# EAGLE schematic 8B_RAM_3 (EAGLE 6.5.0), part 2 of 2
## Sheet 25 of 44
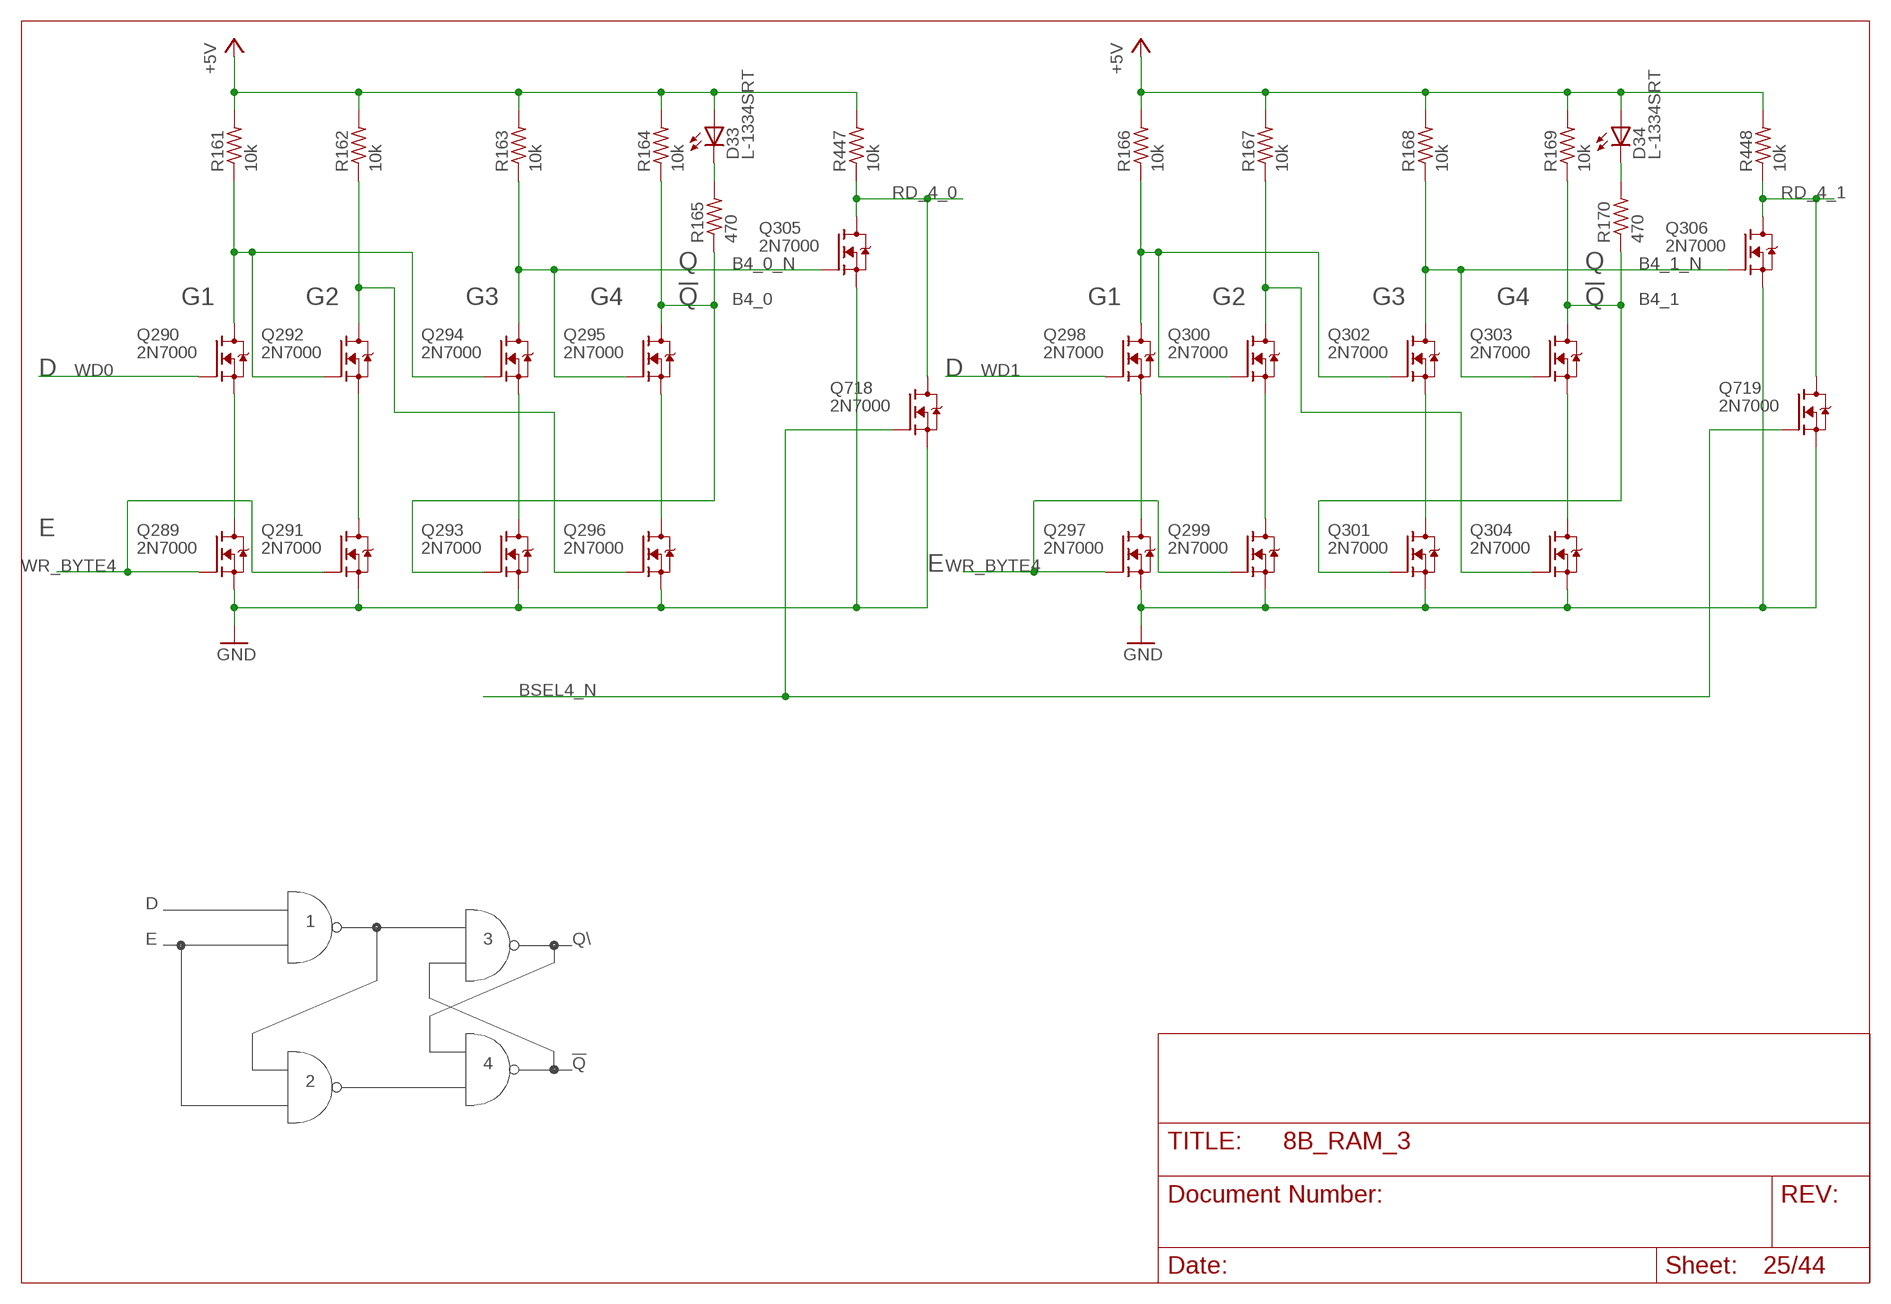
[diagram p24: schematic, sheet 25]

### Parts
D33  L-1334SRT  [LED3MM]
D34  L-1334SRT  [LED3MM]
Q289  2N7000  [TO92-DGS]
Q290  2N7000  [TO92-DGS]
Q291  2N7000  [TO92-DGS]
Q292  2N7000  [TO92-DGS]
Q293  2N7000  [TO92-DGS]
Q294  2N7000  [TO92-DGS]
Q295  2N7000  [TO92-DGS]
Q296  2N7000  [TO92-DGS]
Q297  2N7000  [TO92-DGS]
Q298  2N7000  [TO92-DGS]
Q299  2N7000  [TO92-DGS]
Q300  2N7000  [TO92-DGS]
Q301  2N7000  [TO92-DGS]
Q302  2N7000  [TO92-DGS]
Q303  2N7000  [TO92-DGS]
Q304  2N7000  [TO92-DGS]
Q305  2N7000  [TO92-DGS]
Q306  2N7000  [TO92-DGS]
Q718  2N7000  [TO92-DGS]
Q719  2N7000  [TO92-DGS]
R161  10k  R_P2INCH  [R_P2INCH]
R162  10k  R_P2INCH  [R_P2INCH]
R163  10k  R_P2INCH  [R_P2INCH]
R164  10k  R_P2INCH  [R_P2INCH]
R165  470  R_P2INCH  [R_P2INCH]
R166  10k  R_P2INCH  [R_P2INCH]
R167  10k  R_P2INCH  [R_P2INCH]
R168  10k  R_P2INCH  [R_P2INCH]
R169  10k  R_P2INCH  [R_P2INCH]
R170  470  R_P2INCH  [R_P2INCH]
R447  10k  R_P2INCH  [R_P2INCH]
R448  10k  R_P2INCH  [R_P2INCH]

### Nets
+5V: D33.A D34.A R161.2 R162.2 R163.2 R164.2 R166.2 R167.2 R168.2 R169.2 R447.2 R448.2 ; also sheet 2,4,5,6,7,8,9,10,11,12,13,14,15,16,17,18,19,20,21,22,23,24,26,27,28,29,30,31,32,33,34,35,36,37,38,39,40,41,42,43,44
B4_0: Q293.G Q295.D R164.1 R165.1
B4_0_N: Q294.D Q295.G Q305.G R163.1
B4_1: Q301.G Q303.D R169.1 R170.1
B4_1_N: Q302.D Q303.G Q306.G R168.1
BSEL4_N: Q718.G Q719.G ; also sheet 7,26,27,28
GND: Q289.S Q291.S Q293.S Q296.S Q297.S Q299.S Q301.S Q304.S Q305.S Q306.S Q718.S Q719.S ; also sheet 2,3,4,5,6,7,8,9,10,11,12,13,14,15,16,17,18,19,20,21,22,23,24,26,27,28,29,30,31,32,33,34,35,36,37,38,39,40,41,42,43,44
N$225: Q289.D Q290.S
N$226: Q291.D Q292.S
N$227: Q293.D Q294.S
N$228: Q290.D Q292.G Q294.G R161.1
N$229: Q292.D Q296.G R162.1
N$230: D33.K(C) R165.2
N$231: Q295.S Q296.D
N$232: Q297.D Q298.S
N$233: Q299.D Q300.S
N$234: Q301.D Q302.S
N$235: Q298.D Q300.G Q302.G R166.1
N$236: Q300.D Q304.G R167.1
N$237: D34.K(C) R170.2
N$238: Q303.S Q304.D
RD_4_0: Q305.D Q718.D R447.1 ; also sheet 41
RD_4_1: Q306.D Q719.D R448.1 ; also sheet 41
WD0: Q290.G ; also sheet 3,9,13,17,21,29,33,37
WD1: Q298.G ; also sheet 3,9,13,17,21,29,33,37
WR_BYTE4: Q289.G Q291.G Q297.G Q299.G ; also sheet 7,26,27,28

### Notes on the sheet
- Q | Q
- G1 | G2 | G3 | G4 | !Q | G1 | G2 | G3 | G4 | !Q
- D | D
- E
- E
- D
- 1
- E | 3 | Q\
- 4 | !Q
- 2

## Sheet 26 of 44
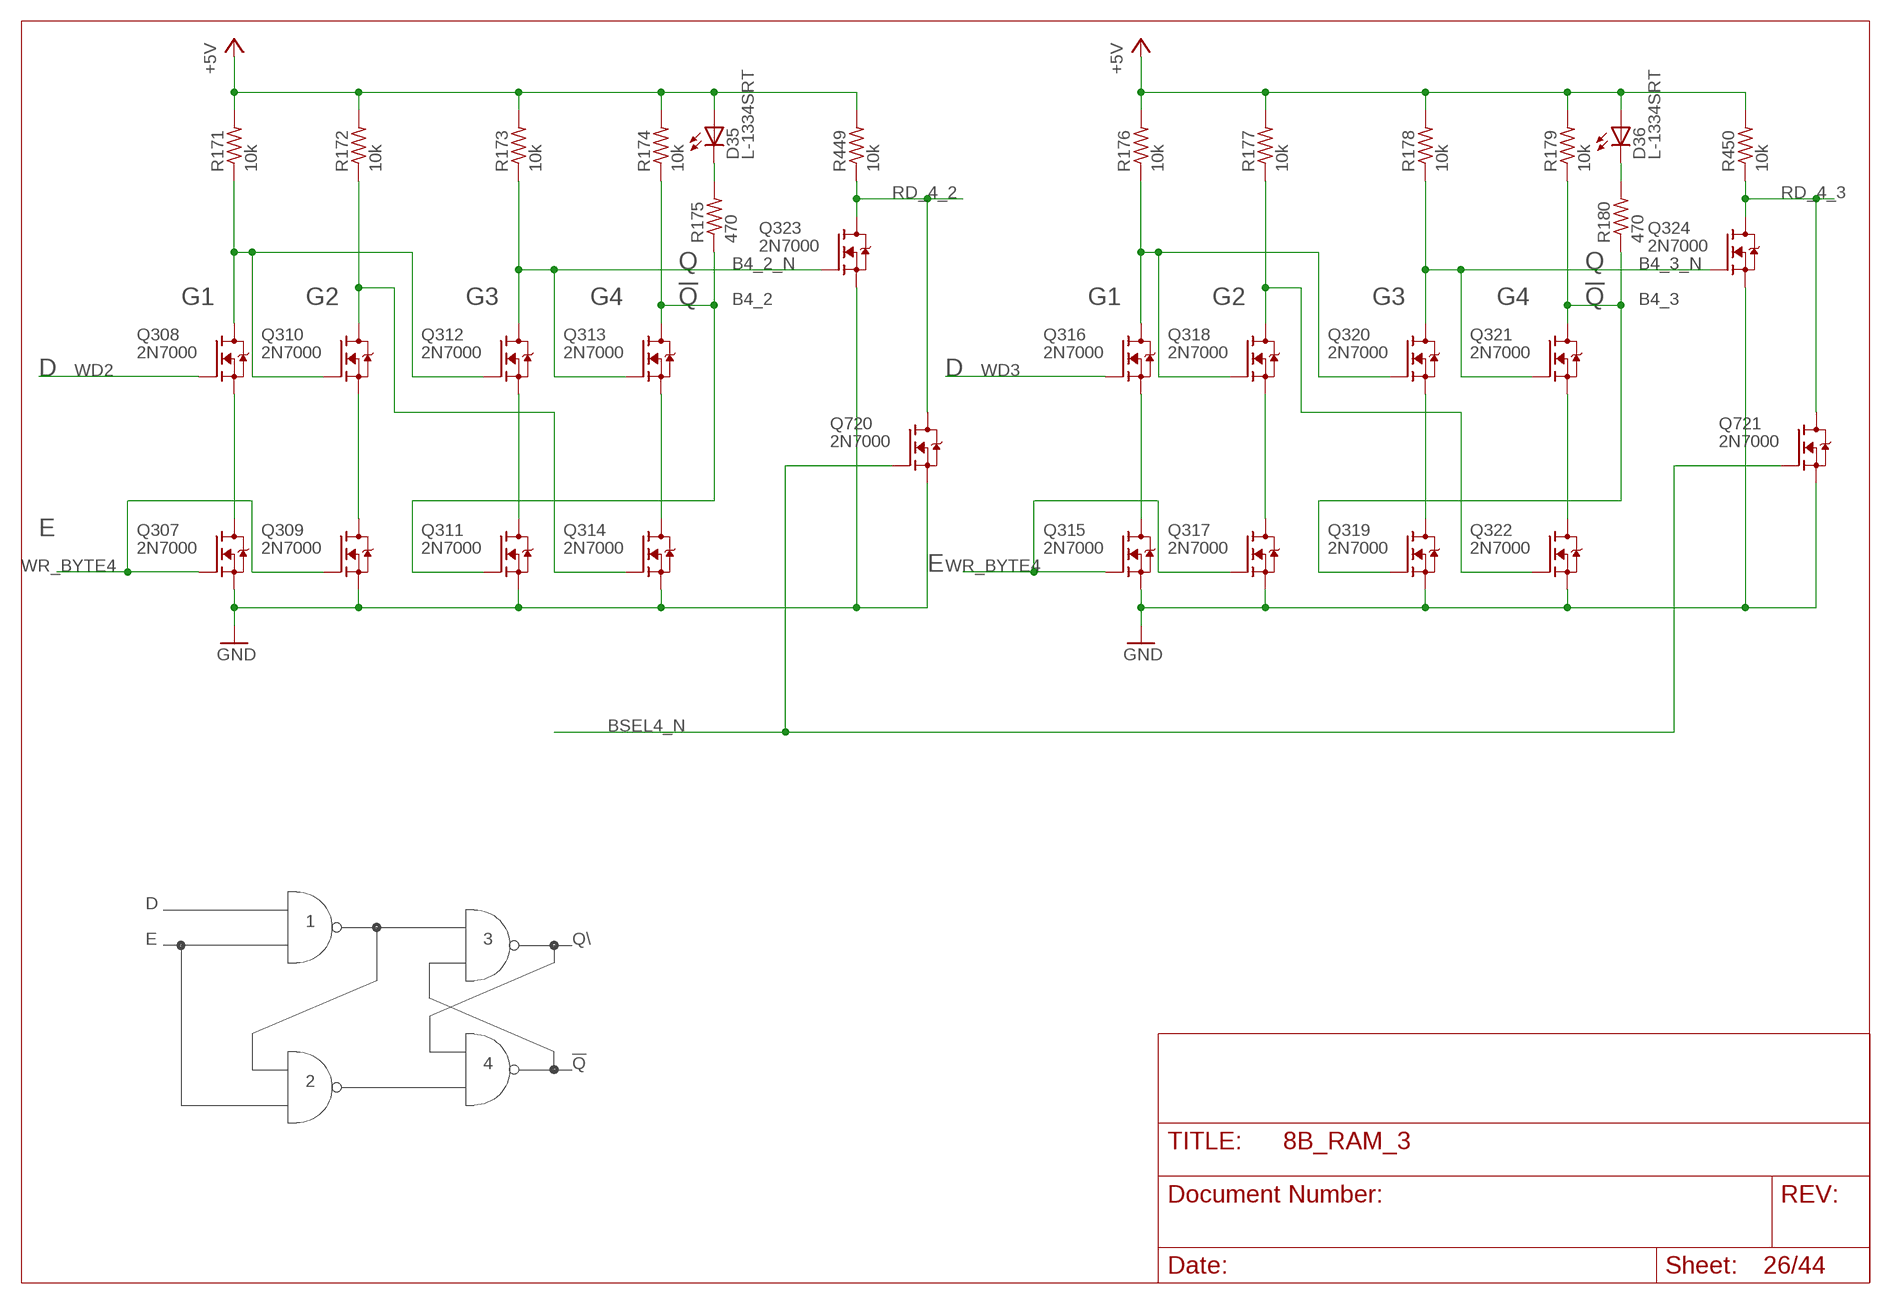
[diagram p25: schematic, sheet 26]

### Parts
D35  L-1334SRT  [LED3MM]
D36  L-1334SRT  [LED3MM]
Q307  2N7000  [TO92-DGS]
Q308  2N7000  [TO92-DGS]
Q309  2N7000  [TO92-DGS]
Q310  2N7000  [TO92-DGS]
Q311  2N7000  [TO92-DGS]
Q312  2N7000  [TO92-DGS]
Q313  2N7000  [TO92-DGS]
Q314  2N7000  [TO92-DGS]
Q315  2N7000  [TO92-DGS]
Q316  2N7000  [TO92-DGS]
Q317  2N7000  [TO92-DGS]
Q318  2N7000  [TO92-DGS]
Q319  2N7000  [TO92-DGS]
Q320  2N7000  [TO92-DGS]
Q321  2N7000  [TO92-DGS]
Q322  2N7000  [TO92-DGS]
Q323  2N7000  [TO92-DGS]
Q324  2N7000  [TO92-DGS]
Q720  2N7000  [TO92-DGS]
Q721  2N7000  [TO92-DGS]
R171  10k  R_P2INCH  [R_P2INCH]
R172  10k  R_P2INCH  [R_P2INCH]
R173  10k  R_P2INCH  [R_P2INCH]
R174  10k  R_P2INCH  [R_P2INCH]
R175  470  R_P2INCH  [R_P2INCH]
R176  10k  R_P2INCH  [R_P2INCH]
R177  10k  R_P2INCH  [R_P2INCH]
R178  10k  R_P2INCH  [R_P2INCH]
R179  10k  R_P2INCH  [R_P2INCH]
R180  470  R_P2INCH  [R_P2INCH]
R449  10k  R_P2INCH  [R_P2INCH]
R450  10k  R_P2INCH  [R_P2INCH]

### Nets
+5V: D35.A D36.A R171.2 R172.2 R173.2 R174.2 R176.2 R177.2 R178.2 R179.2 R449.2 R450.2 ; also sheet 2,4,5,6,7,8,9,10,11,12,13,14,15,16,17,18,19,20,21,22,23,24,25,27,28,29,30,31,32,33,34,35,36,37,38,39,40,41,42,43,44
B4_2: Q311.G Q313.D R174.1 R175.1
B4_2_N: Q312.D Q313.G Q323.G R173.1
B4_3: Q319.G Q321.D R179.1 R180.1
B4_3_N: Q320.D Q321.G Q324.G R178.1
BSEL4_N: Q720.G Q721.G ; also sheet 7,25,27,28
GND: Q307.S Q309.S Q311.S Q314.S Q315.S Q317.S Q319.S Q322.S Q323.S Q324.S Q720.S Q721.S ; also sheet 2,3,4,5,6,7,8,9,10,11,12,13,14,15,16,17,18,19,20,21,22,23,24,25,27,28,29,30,31,32,33,34,35,36,37,38,39,40,41,42,43,44
N$239: Q307.D Q308.S
N$240: Q309.D Q310.S
N$241: Q311.D Q312.S
N$242: Q308.D Q310.G Q312.G R171.1
N$243: Q310.D Q314.G R172.1
N$244: D35.K(C) R175.2
N$245: Q313.S Q314.D
N$246: Q315.D Q316.S
N$247: Q317.D Q318.S
N$248: Q319.D Q320.S
N$249: Q316.D Q318.G Q320.G R176.1
N$250: Q318.D Q322.G R177.1
N$251: D36.K(C) R180.2
N$252: Q321.S Q322.D
RD_4_2: Q323.D Q720.D R449.1 ; also sheet 42
RD_4_3: Q324.D Q721.D R450.1 ; also sheet 42
WD2: Q308.G ; also sheet 3,10,14,18,22,30,34,38
WD3: Q316.G ; also sheet 3,10,14,18,22,30,34,38
WR_BYTE4: Q307.G Q309.G Q315.G Q317.G ; also sheet 7,25,27,28

### Notes on the sheet
- Q | Q
- G1 | G2 | G3 | G4 | !Q | G1 | G2 | G3 | G4 | !Q
- D | D
- E
- E
- D
- 1
- E | 3 | Q\
- 4 | !Q
- 2

## Sheet 27 of 44
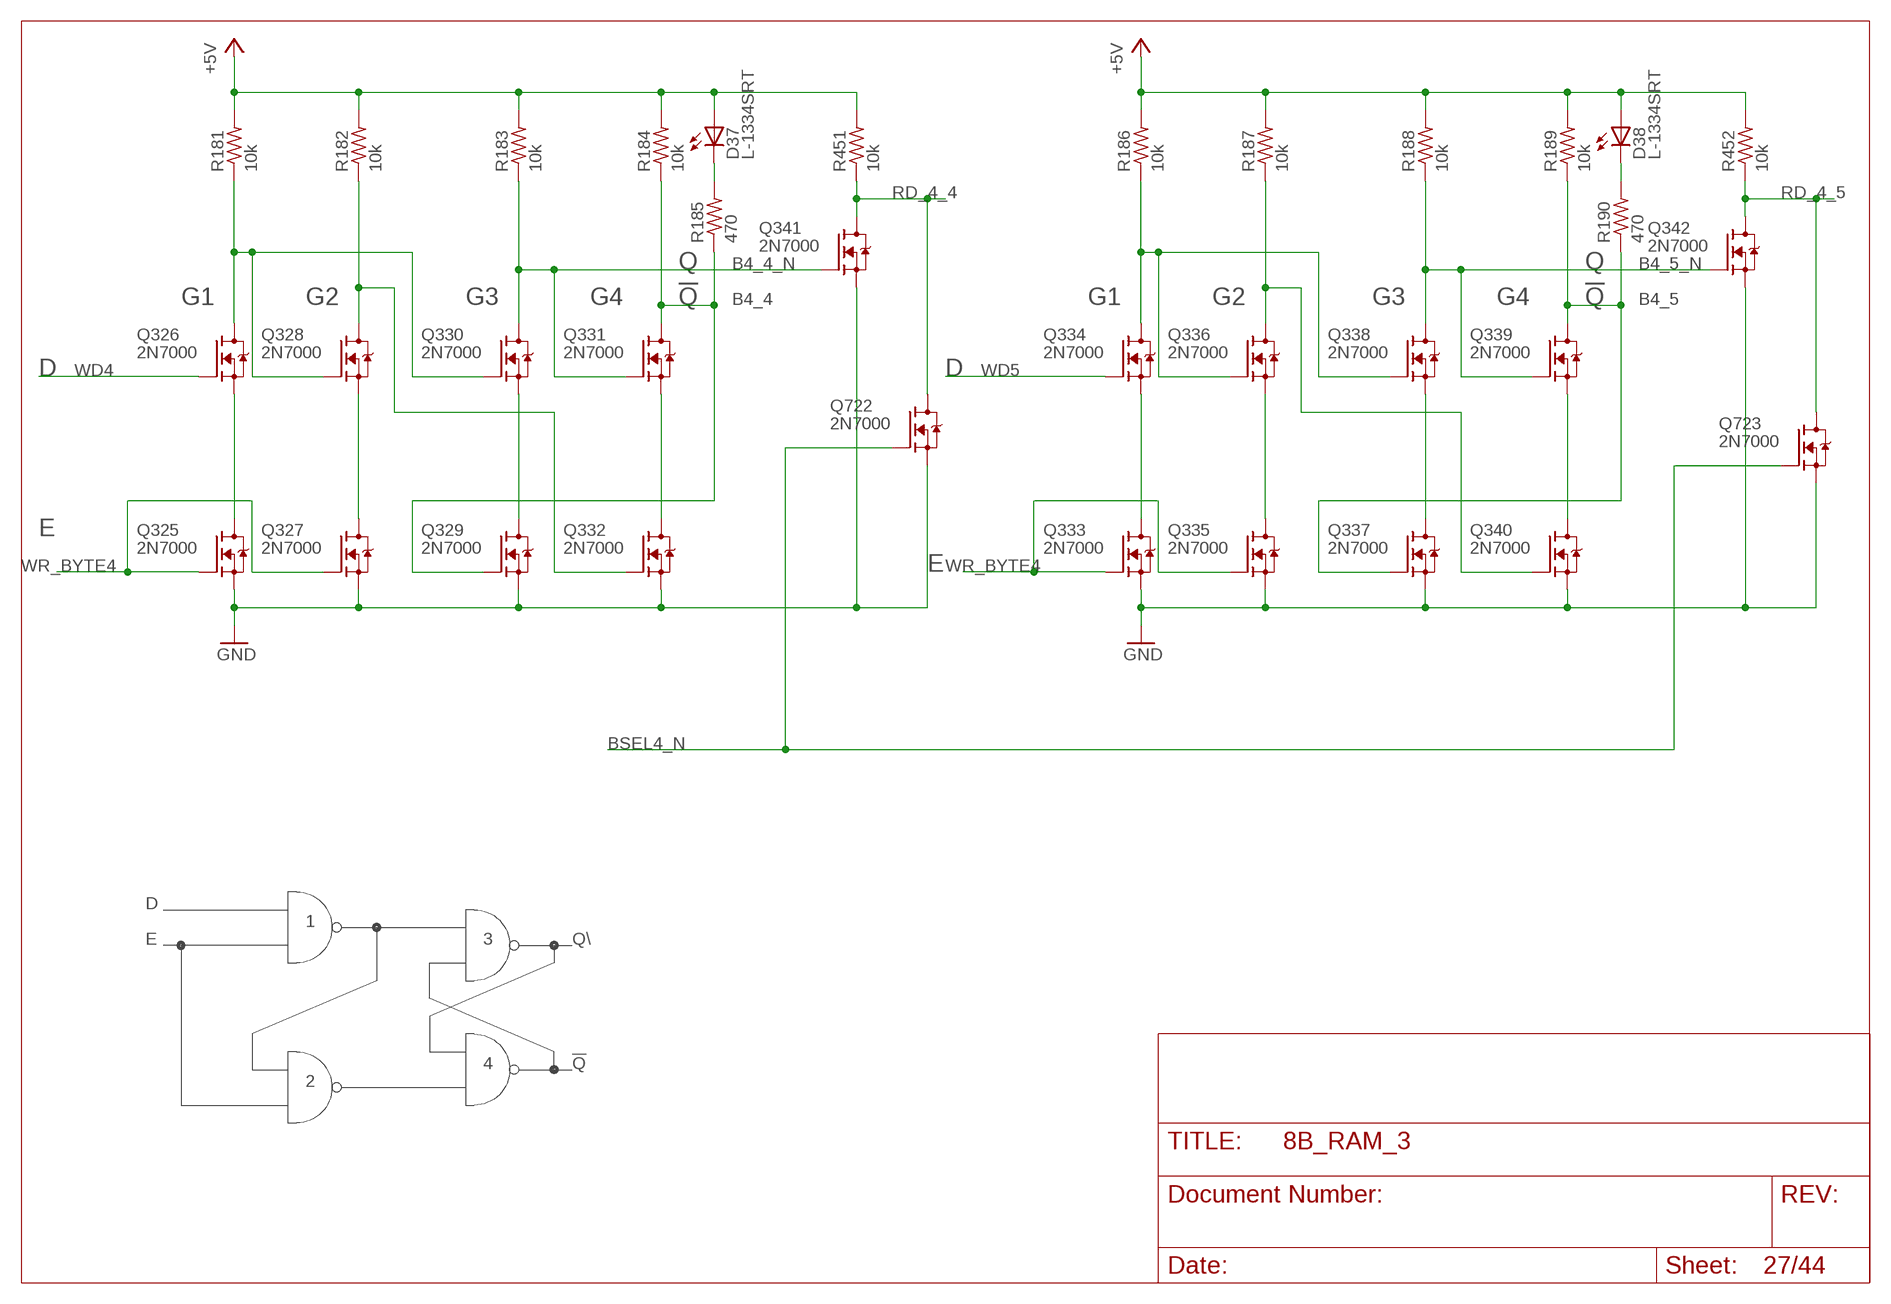
[diagram p26: schematic, sheet 27]

### Parts
D37  L-1334SRT  [LED3MM]
D38  L-1334SRT  [LED3MM]
Q325  2N7000  [TO92-DGS]
Q326  2N7000  [TO92-DGS]
Q327  2N7000  [TO92-DGS]
Q328  2N7000  [TO92-DGS]
Q329  2N7000  [TO92-DGS]
Q330  2N7000  [TO92-DGS]
Q331  2N7000  [TO92-DGS]
Q332  2N7000  [TO92-DGS]
Q333  2N7000  [TO92-DGS]
Q334  2N7000  [TO92-DGS]
Q335  2N7000  [TO92-DGS]
Q336  2N7000  [TO92-DGS]
Q337  2N7000  [TO92-DGS]
Q338  2N7000  [TO92-DGS]
Q339  2N7000  [TO92-DGS]
Q340  2N7000  [TO92-DGS]
Q341  2N7000  [TO92-DGS]
Q342  2N7000  [TO92-DGS]
Q722  2N7000  [TO92-DGS]
Q723  2N7000  [TO92-DGS]
R181  10k  R_P2INCH  [R_P2INCH]
R182  10k  R_P2INCH  [R_P2INCH]
R183  10k  R_P2INCH  [R_P2INCH]
R184  10k  R_P2INCH  [R_P2INCH]
R185  470  R_P2INCH  [R_P2INCH]
R186  10k  R_P2INCH  [R_P2INCH]
R187  10k  R_P2INCH  [R_P2INCH]
R188  10k  R_P2INCH  [R_P2INCH]
R189  10k  R_P2INCH  [R_P2INCH]
R190  470  R_P2INCH  [R_P2INCH]
R451  10k  R_P2INCH  [R_P2INCH]
R452  10k  R_P2INCH  [R_P2INCH]

### Nets
+5V: D37.A D38.A R181.2 R182.2 R183.2 R184.2 R186.2 R187.2 R188.2 R189.2 R451.2 R452.2 ; also sheet 2,4,5,6,7,8,9,10,11,12,13,14,15,16,17,18,19,20,21,22,23,24,25,26,28,29,30,31,32,33,34,35,36,37,38,39,40,41,42,43,44
B4_4: Q329.G Q331.D R184.1 R185.1
B4_4_N: Q330.D Q331.G Q341.G R183.1
B4_5: Q337.G Q339.D R189.1 R190.1
B4_5_N: Q338.D Q339.G Q342.G R188.1
BSEL4_N: Q722.G Q723.G ; also sheet 7,25,26,28
GND: Q325.S Q327.S Q329.S Q332.S Q333.S Q335.S Q337.S Q340.S Q341.S Q342.S Q722.S Q723.S ; also sheet 2,3,4,5,6,7,8,9,10,11,12,13,14,15,16,17,18,19,20,21,22,23,24,25,26,28,29,30,31,32,33,34,35,36,37,38,39,40,41,42,43,44
N$253: Q325.D Q326.S
N$254: Q327.D Q328.S
N$255: Q329.D Q330.S
N$256: Q326.D Q328.G Q330.G R181.1
N$257: Q328.D Q332.G R182.1
N$258: D37.K(C) R185.2
N$259: Q331.S Q332.D
N$260: Q333.D Q334.S
N$261: Q335.D Q336.S
N$262: Q337.D Q338.S
N$263: Q334.D Q336.G Q338.G R186.1
N$264: Q336.D Q340.G R187.1
N$265: D38.K(C) R190.2
N$266: Q339.S Q340.D
RD_4_4: Q341.D Q722.D R451.1 ; also sheet 43
RD_4_5: Q342.D Q723.D R452.1 ; also sheet 43
WD4: Q326.G ; also sheet 3,11,15,19,23,31,35,39
WD5: Q334.G ; also sheet 3,11,15,19,23,31,35,39
WR_BYTE4: Q325.G Q327.G Q333.G Q335.G ; also sheet 7,25,26,28

### Notes on the sheet
- Q | Q
- G1 | G2 | G3 | G4 | !Q | G1 | G2 | G3 | G4 | !Q
- D | D
- E
- E
- D
- 1
- E | 3 | Q\
- 4 | !Q
- 2

## Sheet 28 of 44
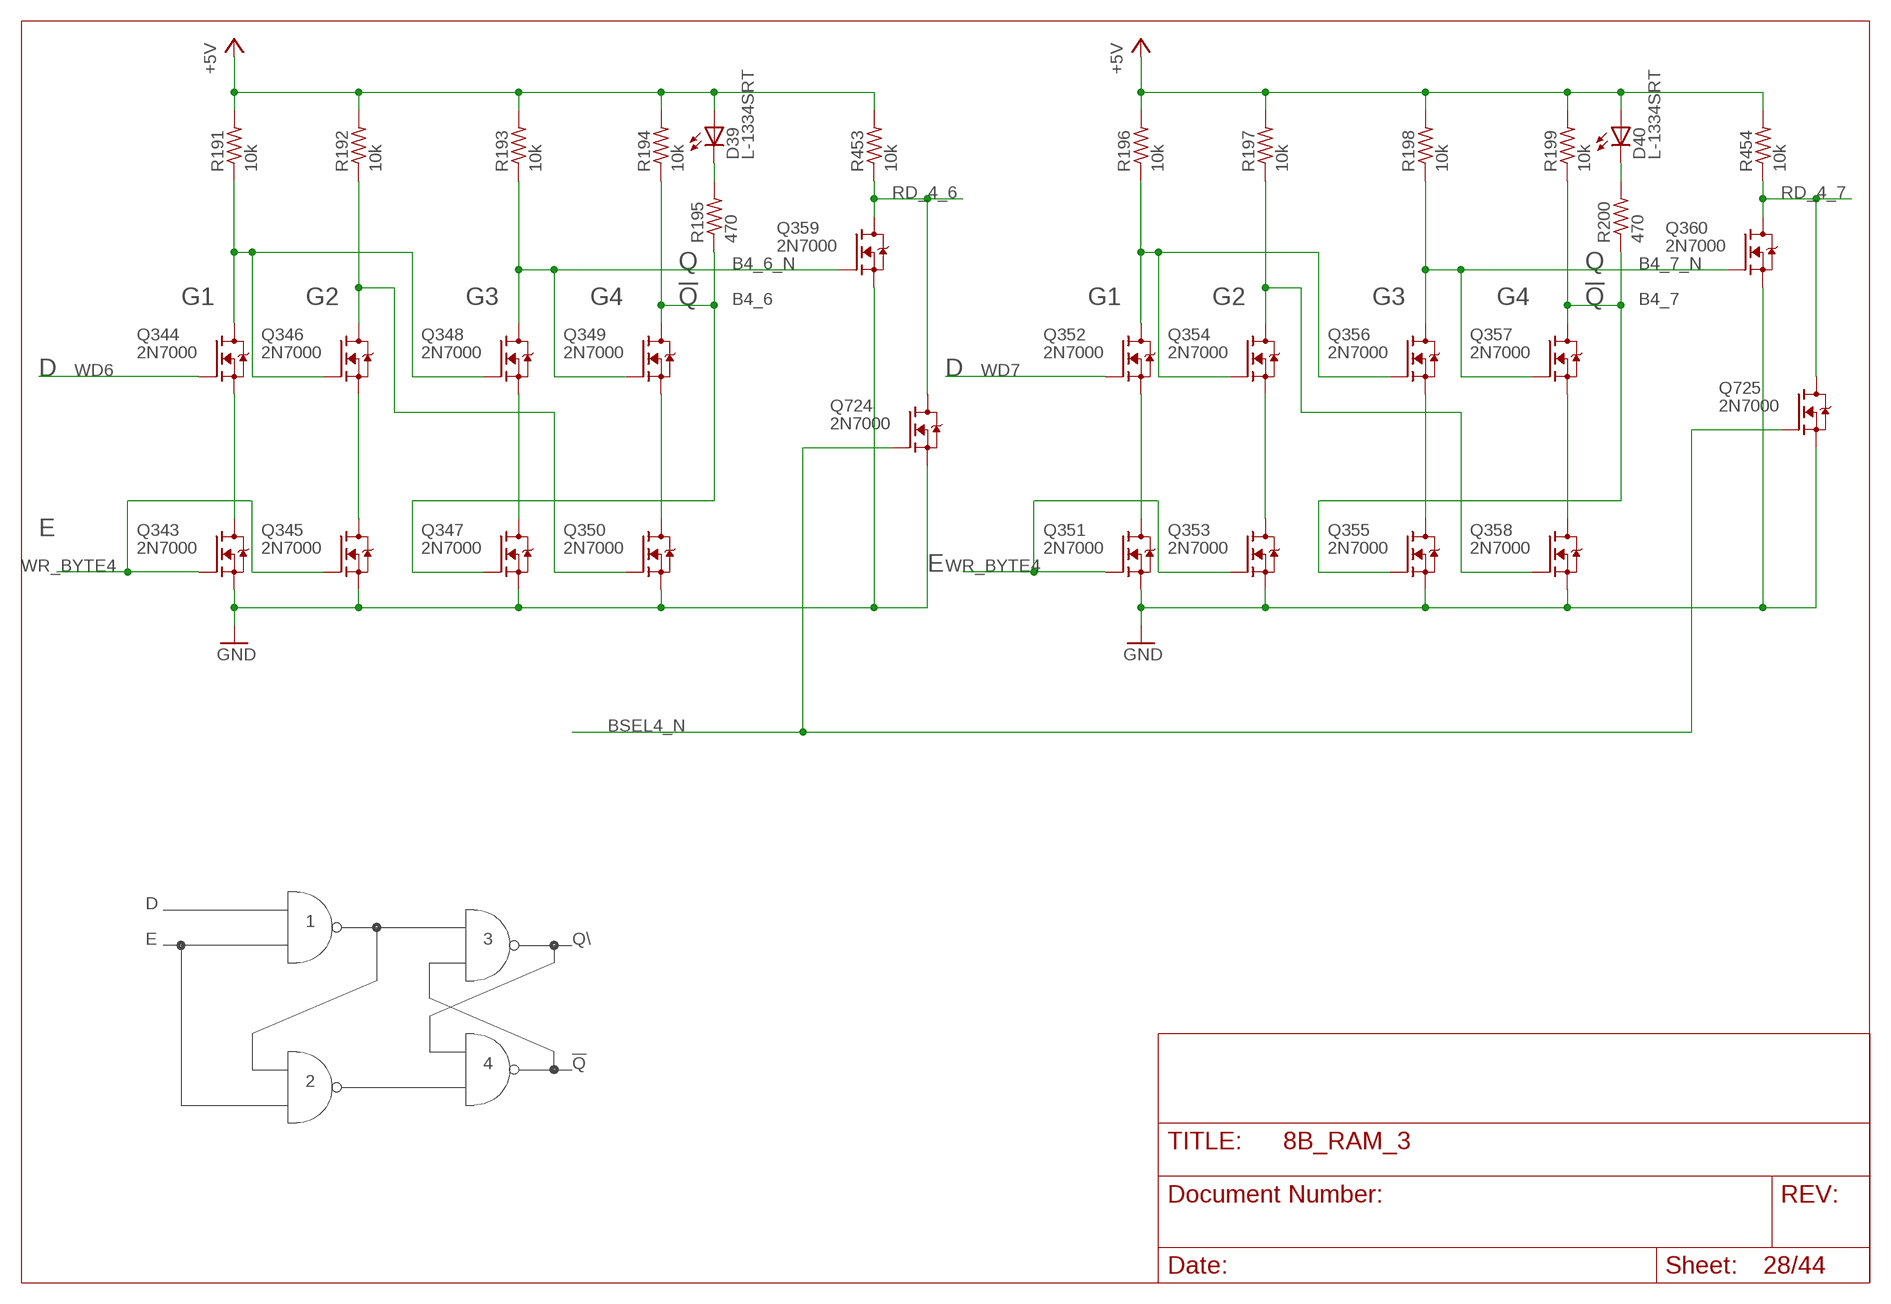
[diagram p27: schematic, sheet 28]

### Parts
D39  L-1334SRT  [LED3MM]
D40  L-1334SRT  [LED3MM]
Q343  2N7000  [TO92-DGS]
Q344  2N7000  [TO92-DGS]
Q345  2N7000  [TO92-DGS]
Q346  2N7000  [TO92-DGS]
Q347  2N7000  [TO92-DGS]
Q348  2N7000  [TO92-DGS]
Q349  2N7000  [TO92-DGS]
Q350  2N7000  [TO92-DGS]
Q351  2N7000  [TO92-DGS]
Q352  2N7000  [TO92-DGS]
Q353  2N7000  [TO92-DGS]
Q354  2N7000  [TO92-DGS]
Q355  2N7000  [TO92-DGS]
Q356  2N7000  [TO92-DGS]
Q357  2N7000  [TO92-DGS]
Q358  2N7000  [TO92-DGS]
Q359  2N7000  [TO92-DGS]
Q360  2N7000  [TO92-DGS]
Q724  2N7000  [TO92-DGS]
Q725  2N7000  [TO92-DGS]
R191  10k  R_P2INCH  [R_P2INCH]
R192  10k  R_P2INCH  [R_P2INCH]
R193  10k  R_P2INCH  [R_P2INCH]
R194  10k  R_P2INCH  [R_P2INCH]
R195  470  R_P2INCH  [R_P2INCH]
R196  10k  R_P2INCH  [R_P2INCH]
R197  10k  R_P2INCH  [R_P2INCH]
R198  10k  R_P2INCH  [R_P2INCH]
R199  10k  R_P2INCH  [R_P2INCH]
R200  470  R_P2INCH  [R_P2INCH]
R453  10k  R_P2INCH  [R_P2INCH]
R454  10k  R_P2INCH  [R_P2INCH]

### Nets
+5V: D39.A D40.A R191.2 R192.2 R193.2 R194.2 R196.2 R197.2 R198.2 R199.2 R453.2 R454.2 ; also sheet 2,4,5,6,7,8,9,10,11,12,13,14,15,16,17,18,19,20,21,22,23,24,25,26,27,29,30,31,32,33,34,35,36,37,38,39,40,41,42,43,44
B4_6: Q347.G Q349.D R194.1 R195.1
B4_6_N: Q348.D Q349.G Q359.G R193.1
B4_7: Q355.G Q357.D R199.1 R200.1
B4_7_N: Q356.D Q357.G Q360.G R198.1
BSEL4_N: Q724.G Q725.G ; also sheet 7,25,26,27
GND: Q343.S Q345.S Q347.S Q350.S Q351.S Q353.S Q355.S Q358.S Q359.S Q360.S Q724.S Q725.S ; also sheet 2,3,4,5,6,7,8,9,10,11,12,13,14,15,16,17,18,19,20,21,22,23,24,25,26,27,29,30,31,32,33,34,35,36,37,38,39,40,41,42,43,44
N$267: Q343.D Q344.S
N$268: Q345.D Q346.S
N$269: Q347.D Q348.S
N$270: Q344.D Q346.G Q348.G R191.1
N$271: Q346.D Q350.G R192.1
N$272: D39.K(C) R195.2
N$273: Q349.S Q350.D
N$274: Q351.D Q352.S
N$275: Q353.D Q354.S
N$276: Q355.D Q356.S
N$277: Q352.D Q354.G Q356.G R196.1
N$278: Q354.D Q358.G R197.1
N$279: D40.K(C) R200.2
N$280: Q357.S Q358.D
RD_4_6: Q359.D Q724.D R453.1 ; also sheet 44
RD_4_7: Q360.D Q725.D R454.1 ; also sheet 44
WD6: Q344.G ; also sheet 3,12,16,20,24,32,36,40
WD7: Q352.G ; also sheet 3,12,16,20,24,32,36,40
WR_BYTE4: Q343.G Q345.G Q351.G Q353.G ; also sheet 7,25,26,27

### Notes on the sheet
- Q | Q
- G1 | G2 | G3 | G4 | !Q | G1 | G2 | G3 | G4 | !Q
- D | D
- E
- E
- D
- 1
- E | 3 | Q\
- 4 | !Q
- 2

## Sheet 29 of 44
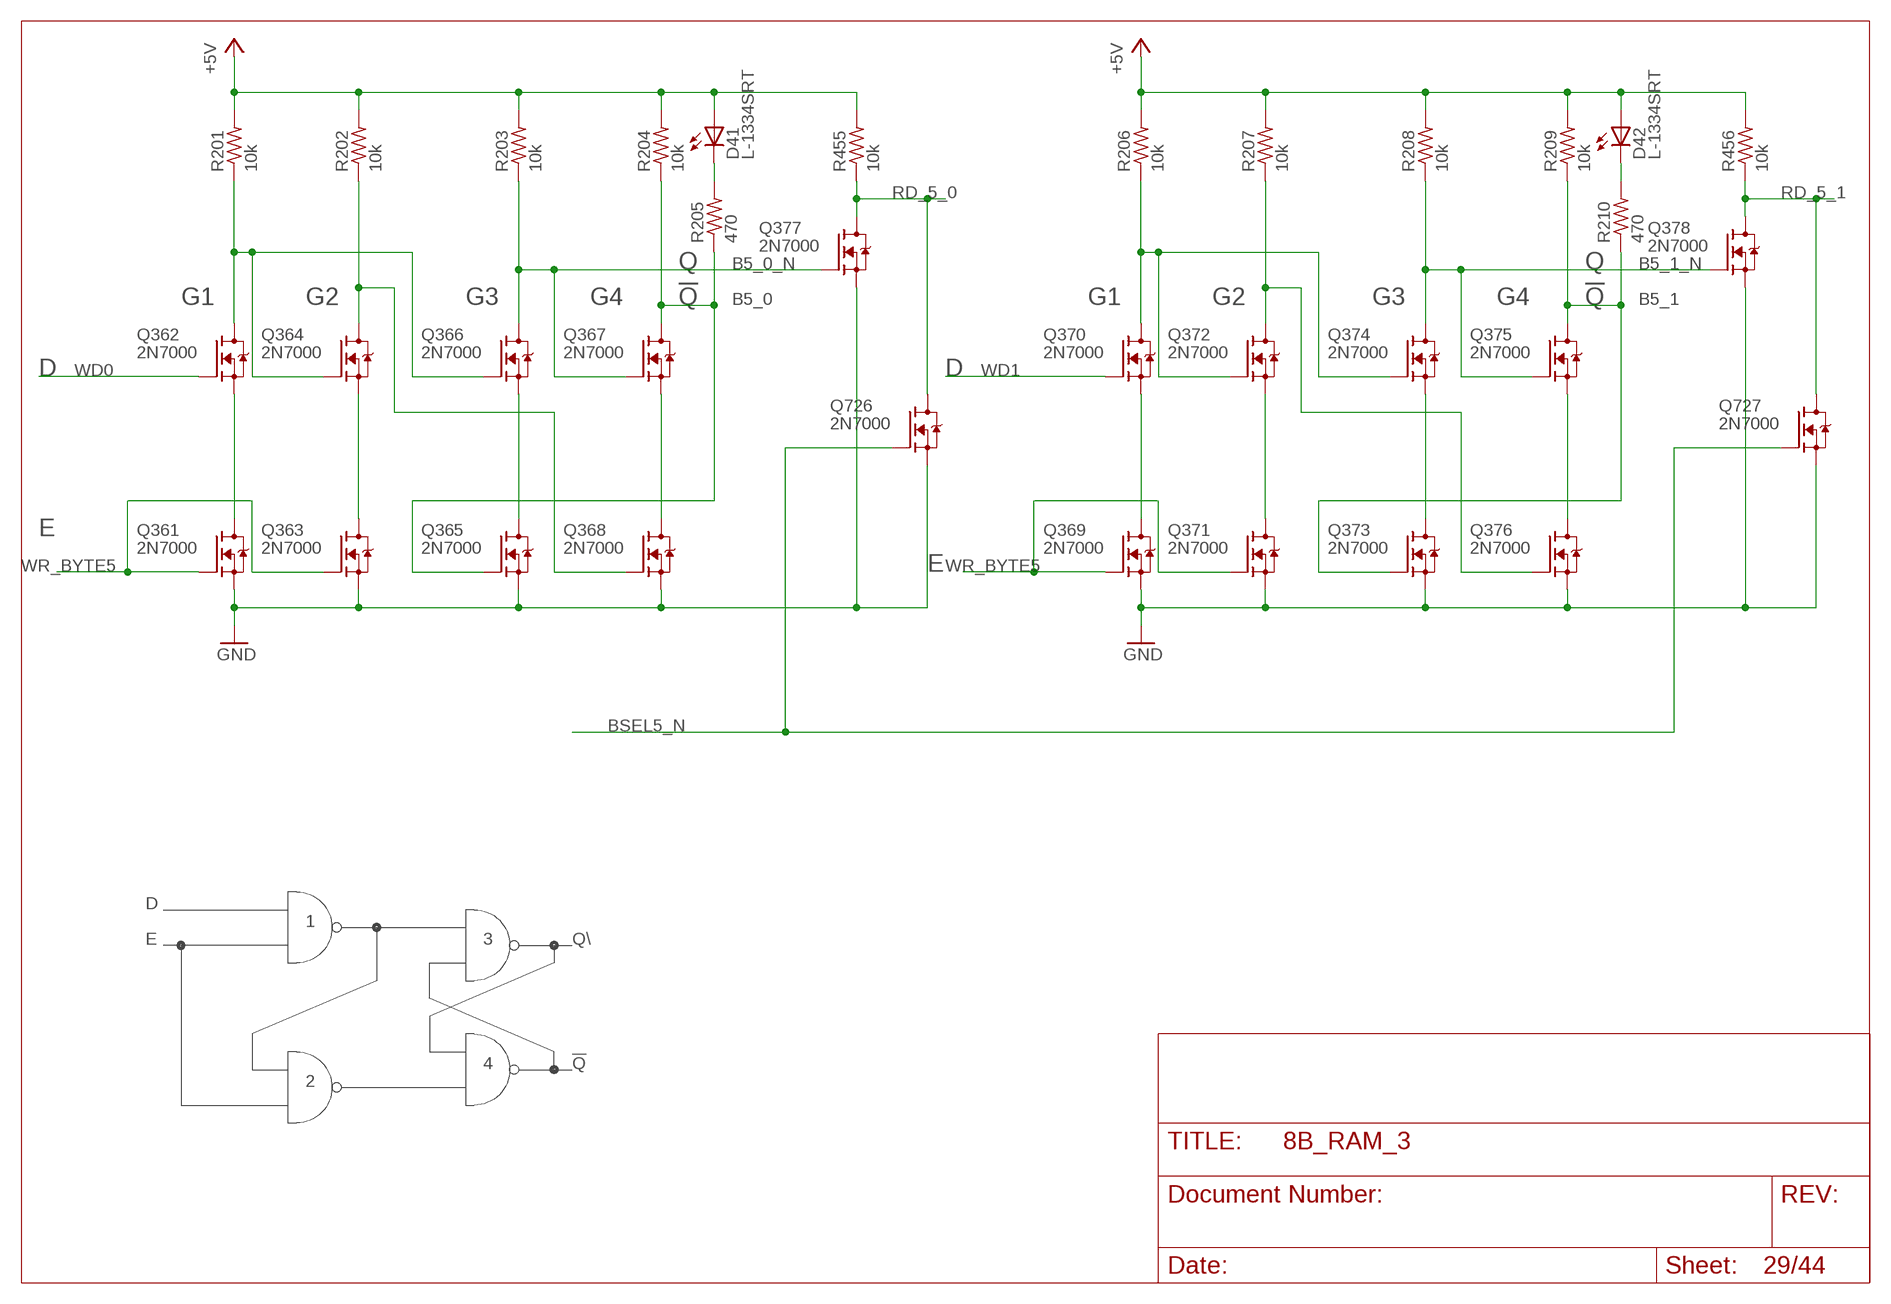
[diagram p28: schematic, sheet 29]

### Parts
D41  L-1334SRT  [LED3MM]
D42  L-1334SRT  [LED3MM]
Q361  2N7000  [TO92-DGS]
Q362  2N7000  [TO92-DGS]
Q363  2N7000  [TO92-DGS]
Q364  2N7000  [TO92-DGS]
Q365  2N7000  [TO92-DGS]
Q366  2N7000  [TO92-DGS]
Q367  2N7000  [TO92-DGS]
Q368  2N7000  [TO92-DGS]
Q369  2N7000  [TO92-DGS]
Q370  2N7000  [TO92-DGS]
Q371  2N7000  [TO92-DGS]
Q372  2N7000  [TO92-DGS]
Q373  2N7000  [TO92-DGS]
Q374  2N7000  [TO92-DGS]
Q375  2N7000  [TO92-DGS]
Q376  2N7000  [TO92-DGS]
Q377  2N7000  [TO92-DGS]
Q378  2N7000  [TO92-DGS]
Q726  2N7000  [TO92-DGS]
Q727  2N7000  [TO92-DGS]
R201  10k  R_P2INCH  [R_P2INCH]
R202  10k  R_P2INCH  [R_P2INCH]
R203  10k  R_P2INCH  [R_P2INCH]
R204  10k  R_P2INCH  [R_P2INCH]
R205  470  R_P2INCH  [R_P2INCH]
R206  10k  R_P2INCH  [R_P2INCH]
R207  10k  R_P2INCH  [R_P2INCH]
R208  10k  R_P2INCH  [R_P2INCH]
R209  10k  R_P2INCH  [R_P2INCH]
R210  470  R_P2INCH  [R_P2INCH]
R455  10k  R_P2INCH  [R_P2INCH]
R456  10k  R_P2INCH  [R_P2INCH]

### Nets
+5V: D41.A D42.A R201.2 R202.2 R203.2 R204.2 R206.2 R207.2 R208.2 R209.2 R455.2 R456.2 ; also sheet 2,4,5,6,7,8,9,10,11,12,13,14,15,16,17,18,19,20,21,22,23,24,25,26,27,28,30,31,32,33,34,35,36,37,38,39,40,41,42,43,44
B5_0: Q365.G Q367.D R204.1 R205.1
B5_0_N: Q366.D Q367.G Q377.G R203.1
B5_1: Q373.G Q375.D R209.1 R210.1
B5_1_N: Q374.D Q375.G Q378.G R208.1
BSEL5_N: Q726.G Q727.G ; also sheet 7,30,31,32
GND: Q361.S Q363.S Q365.S Q368.S Q369.S Q371.S Q373.S Q376.S Q377.S Q378.S Q726.S Q727.S ; also sheet 2,3,4,5,6,7,8,9,10,11,12,13,14,15,16,17,18,19,20,21,22,23,24,25,26,27,28,30,31,32,33,34,35,36,37,38,39,40,41,42,43,44
N$281: Q361.D Q362.S
N$282: Q363.D Q364.S
N$283: Q365.D Q366.S
N$284: Q362.D Q364.G Q366.G R201.1
N$285: Q364.D Q368.G R202.1
N$286: D41.K(C) R205.2
N$287: Q367.S Q368.D
N$288: Q369.D Q370.S
N$289: Q371.D Q372.S
N$290: Q373.D Q374.S
N$291: Q370.D Q372.G Q374.G R206.1
N$292: Q372.D Q376.G R207.1
N$293: D42.K(C) R210.2
N$294: Q375.S Q376.D
RD_5_0: Q377.D Q726.D R455.1 ; also sheet 41
RD_5_1: Q378.D Q727.D R456.1 ; also sheet 41
WD0: Q362.G ; also sheet 3,9,13,17,21,25,33,37
WD1: Q370.G ; also sheet 3,9,13,17,21,25,33,37
WR_BYTE5: Q361.G Q363.G Q369.G Q371.G ; also sheet 7,30,31,32

### Notes on the sheet
- Q | Q
- G1 | G2 | G3 | G4 | !Q | G1 | G2 | G3 | G4 | !Q
- D | D
- E
- E
- D
- 1
- E | 3 | Q\
- 4 | !Q
- 2

## Sheet 30 of 44
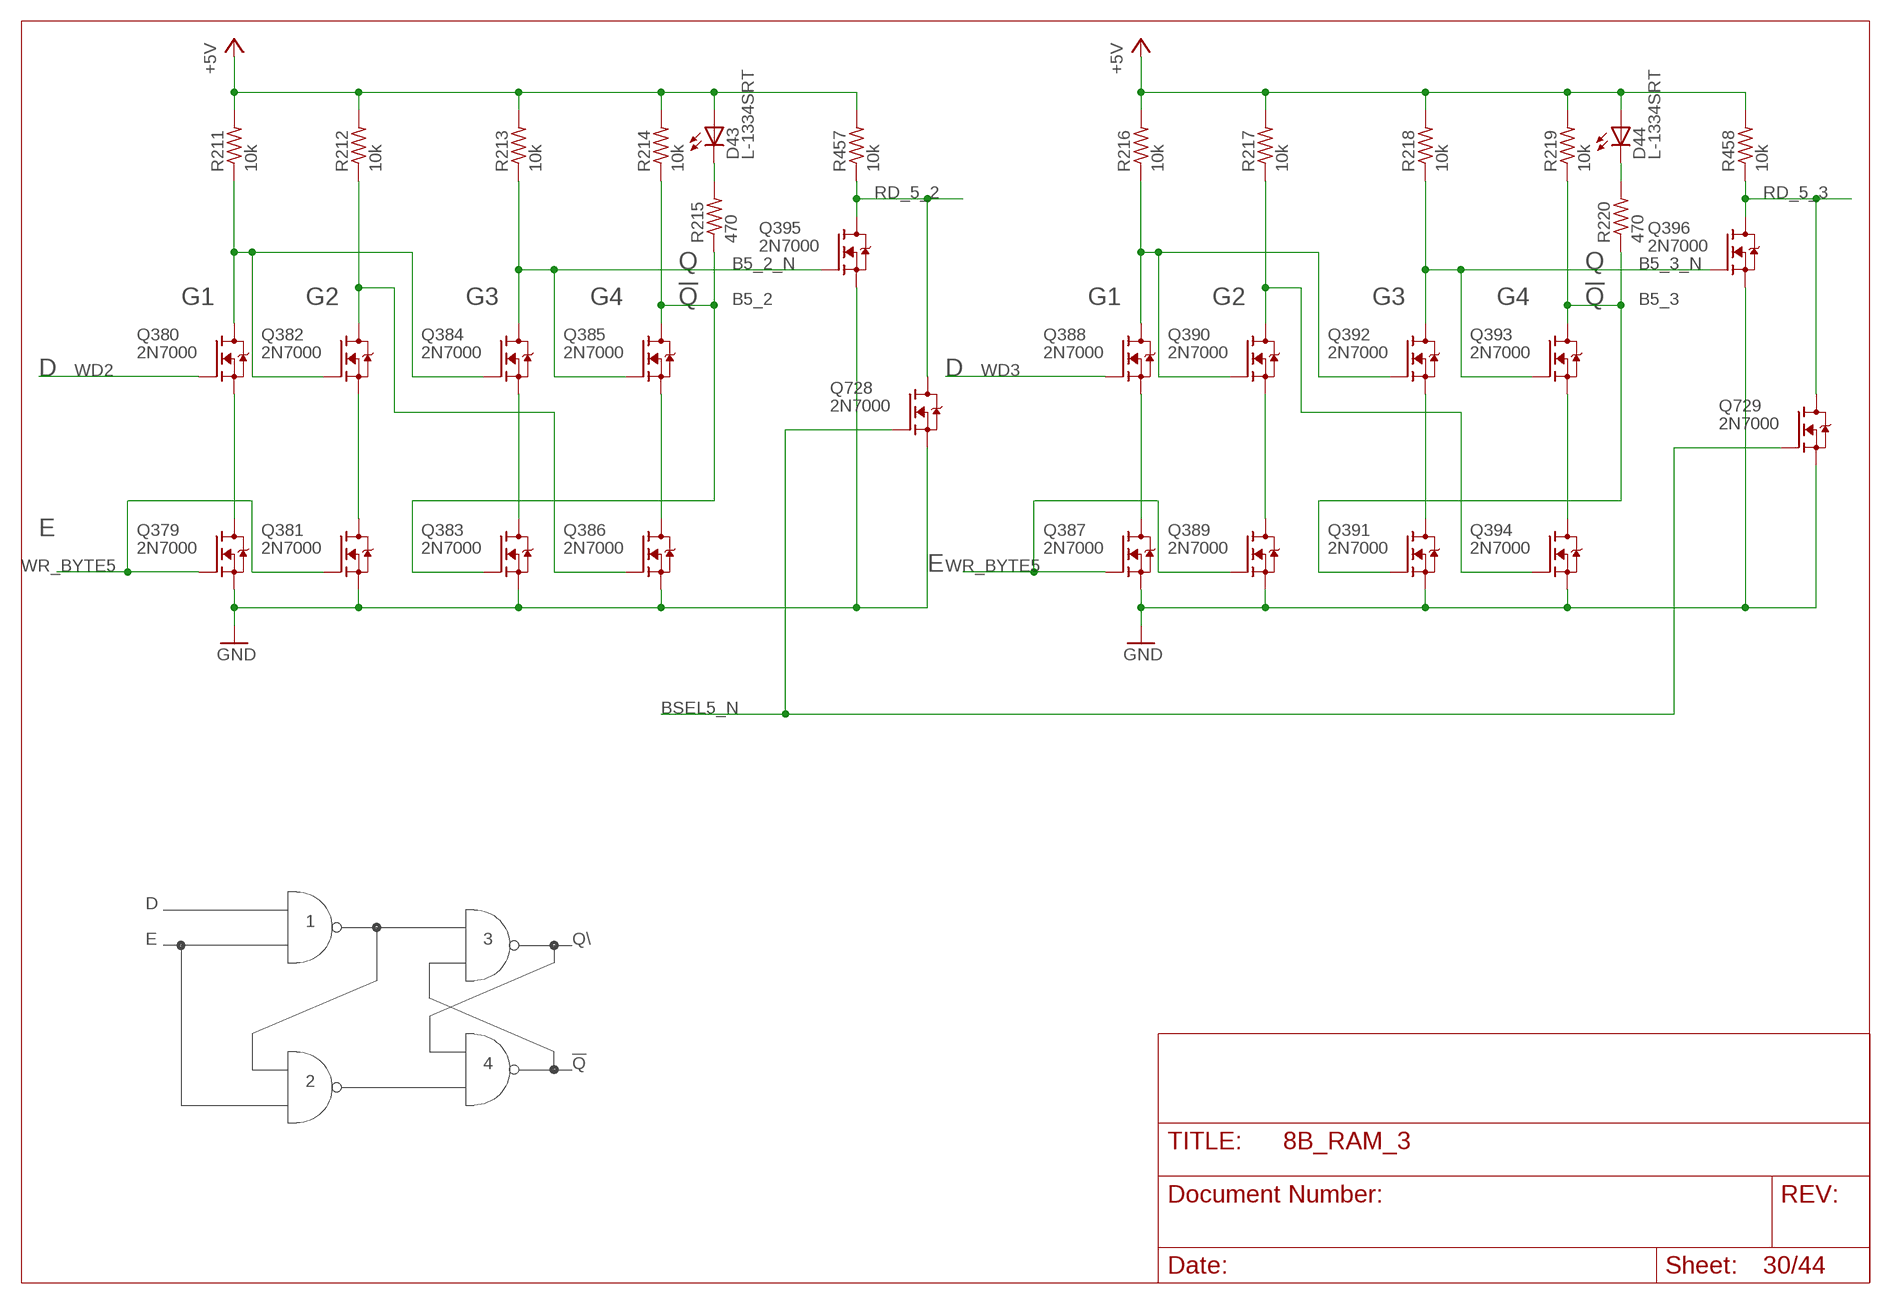
[diagram p29: schematic, sheet 30]

### Parts
D43  L-1334SRT  [LED3MM]
D44  L-1334SRT  [LED3MM]
Q379  2N7000  [TO92-DGS]
Q380  2N7000  [TO92-DGS]
Q381  2N7000  [TO92-DGS]
Q382  2N7000  [TO92-DGS]
Q383  2N7000  [TO92-DGS]
Q384  2N7000  [TO92-DGS]
Q385  2N7000  [TO92-DGS]
Q386  2N7000  [TO92-DGS]
Q387  2N7000  [TO92-DGS]
Q388  2N7000  [TO92-DGS]
Q389  2N7000  [TO92-DGS]
Q390  2N7000  [TO92-DGS]
Q391  2N7000  [TO92-DGS]
Q392  2N7000  [TO92-DGS]
Q393  2N7000  [TO92-DGS]
Q394  2N7000  [TO92-DGS]
Q395  2N7000  [TO92-DGS]
Q396  2N7000  [TO92-DGS]
Q728  2N7000  [TO92-DGS]
Q729  2N7000  [TO92-DGS]
R211  10k  R_P2INCH  [R_P2INCH]
R212  10k  R_P2INCH  [R_P2INCH]
R213  10k  R_P2INCH  [R_P2INCH]
R214  10k  R_P2INCH  [R_P2INCH]
R215  470  R_P2INCH  [R_P2INCH]
R216  10k  R_P2INCH  [R_P2INCH]
R217  10k  R_P2INCH  [R_P2INCH]
R218  10k  R_P2INCH  [R_P2INCH]
R219  10k  R_P2INCH  [R_P2INCH]
R220  470  R_P2INCH  [R_P2INCH]
R457  10k  R_P2INCH  [R_P2INCH]
R458  10k  R_P2INCH  [R_P2INCH]

### Nets
+5V: D43.A D44.A R211.2 R212.2 R213.2 R214.2 R216.2 R217.2 R218.2 R219.2 R457.2 R458.2 ; also sheet 2,4,5,6,7,8,9,10,11,12,13,14,15,16,17,18,19,20,21,22,23,24,25,26,27,28,29,31,32,33,34,35,36,37,38,39,40,41,42,43,44
B5_2: Q383.G Q385.D R214.1 R215.1
B5_2_N: Q384.D Q385.G Q395.G R213.1
B5_3: Q391.G Q393.D R219.1 R220.1
B5_3_N: Q392.D Q393.G Q396.G R218.1
BSEL5_N: Q728.G Q729.G ; also sheet 7,29,31,32
GND: Q379.S Q381.S Q383.S Q386.S Q387.S Q389.S Q391.S Q394.S Q395.S Q396.S Q728.S Q729.S ; also sheet 2,3,4,5,6,7,8,9,10,11,12,13,14,15,16,17,18,19,20,21,22,23,24,25,26,27,28,29,31,32,33,34,35,36,37,38,39,40,41,42,43,44
N$295: Q379.D Q380.S
N$296: Q381.D Q382.S
N$297: Q383.D Q384.S
N$298: Q380.D Q382.G Q384.G R211.1
N$299: Q382.D Q386.G R212.1
N$300: D43.K(C) R215.2
N$301: Q385.S Q386.D
N$302: Q387.D Q388.S
N$303: Q389.D Q390.S
N$304: Q391.D Q392.S
N$305: Q388.D Q390.G Q392.G R216.1
N$306: Q390.D Q394.G R217.1
N$307: D44.K(C) R220.2
N$308: Q393.S Q394.D
RD_5_2: Q395.D Q728.D R457.1 ; also sheet 42
RD_5_3: Q396.D Q729.D R458.1 ; also sheet 42
WD2: Q380.G ; also sheet 3,10,14,18,22,26,34,38
WD3: Q388.G ; also sheet 3,10,14,18,22,26,34,38
WR_BYTE5: Q379.G Q381.G Q387.G Q389.G ; also sheet 7,29,31,32

### Notes on the sheet
- Q | Q
- G1 | G2 | G3 | G4 | !Q | G1 | G2 | G3 | G4 | !Q
- D | D
- E
- E
- D
- 1
- E | 3 | Q\
- 4 | !Q
- 2

## Sheet 31 of 44
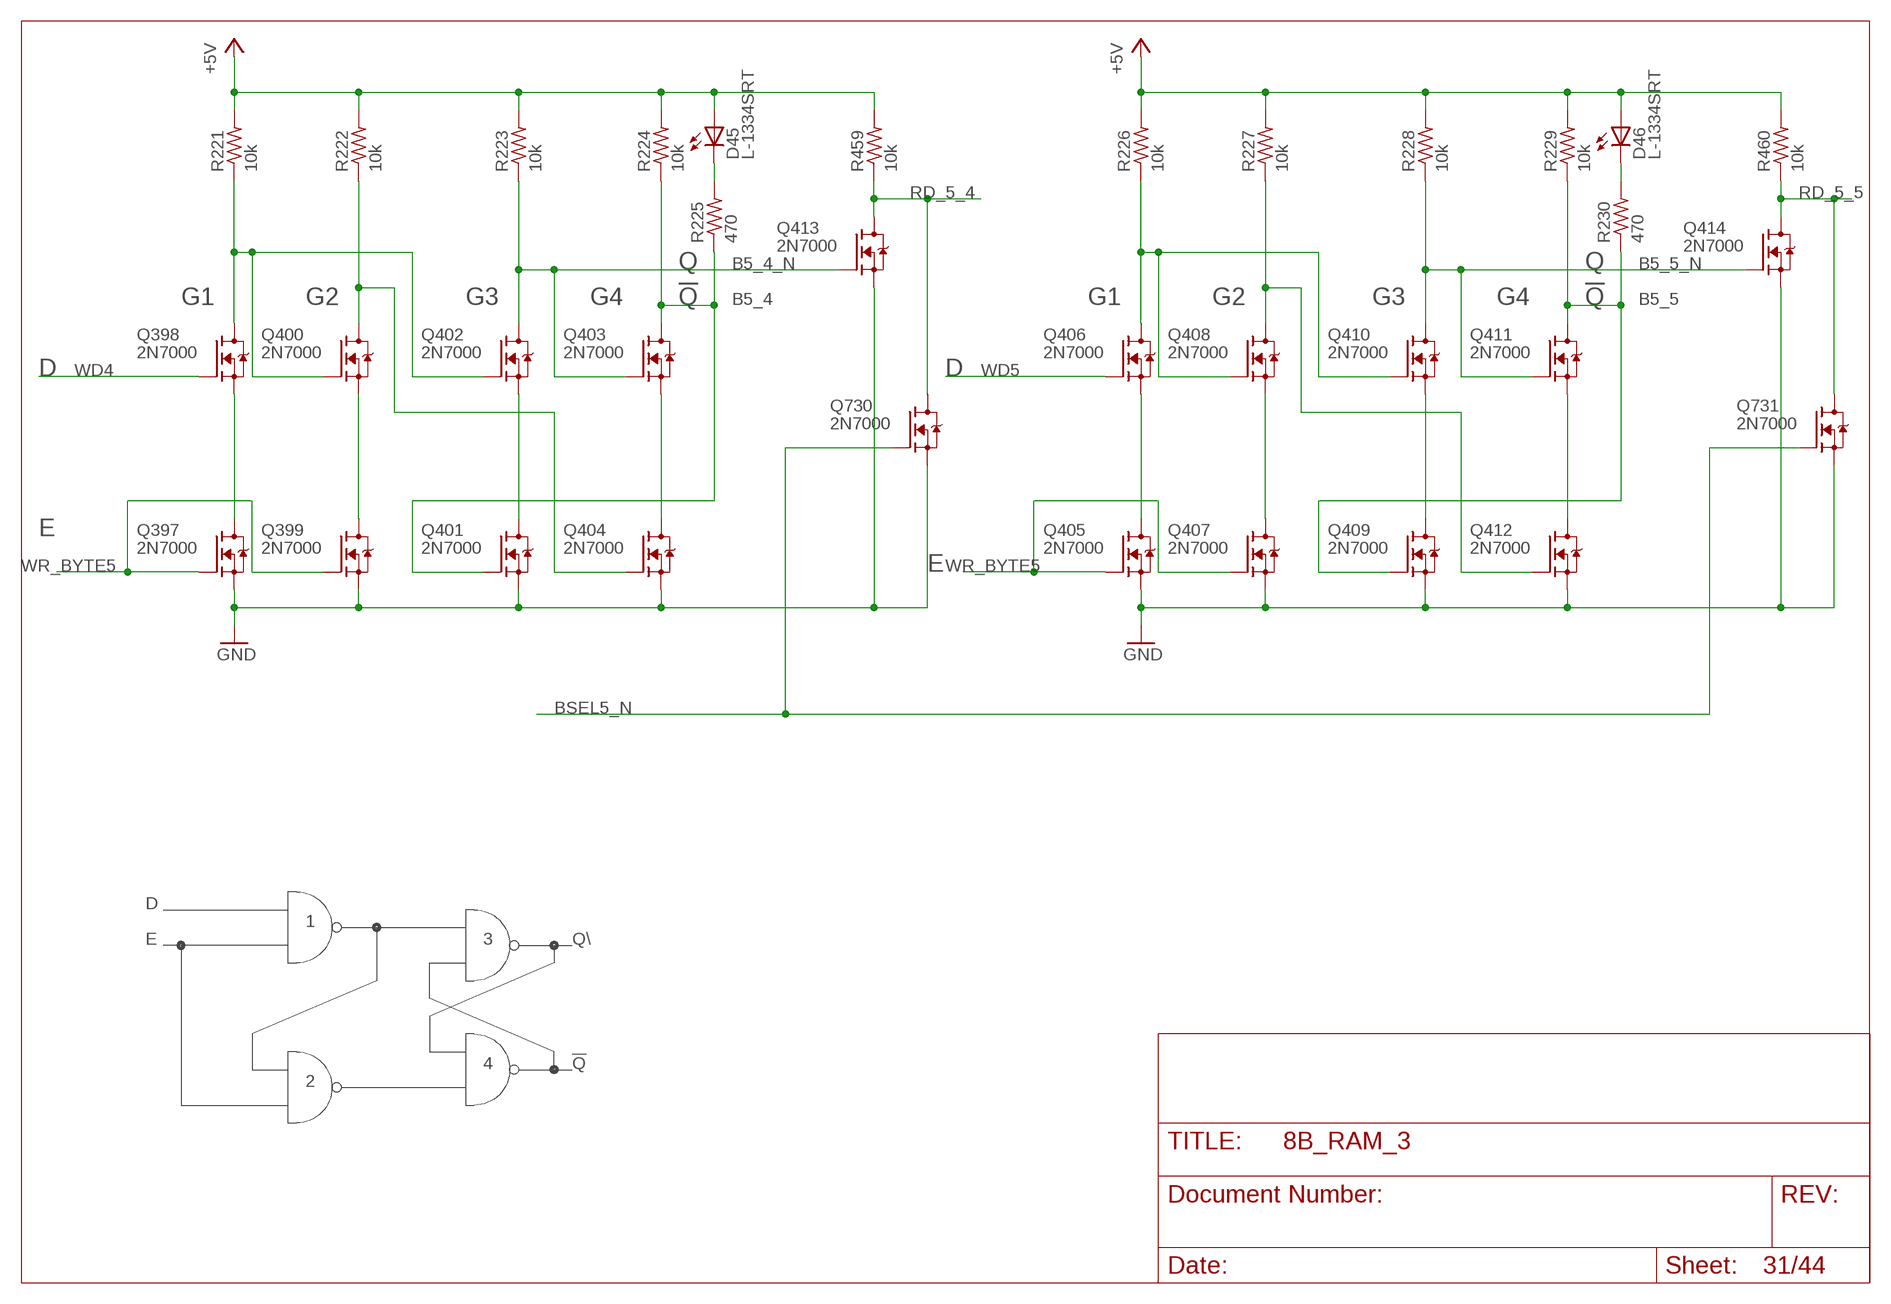
[diagram p30: schematic, sheet 31]

### Parts
D45  L-1334SRT  [LED3MM]
D46  L-1334SRT  [LED3MM]
Q397  2N7000  [TO92-DGS]
Q398  2N7000  [TO92-DGS]
Q399  2N7000  [TO92-DGS]
Q400  2N7000  [TO92-DGS]
Q401  2N7000  [TO92-DGS]
Q402  2N7000  [TO92-DGS]
Q403  2N7000  [TO92-DGS]
Q404  2N7000  [TO92-DGS]
Q405  2N7000  [TO92-DGS]
Q406  2N7000  [TO92-DGS]
Q407  2N7000  [TO92-DGS]
Q408  2N7000  [TO92-DGS]
Q409  2N7000  [TO92-DGS]
Q410  2N7000  [TO92-DGS]
Q411  2N7000  [TO92-DGS]
Q412  2N7000  [TO92-DGS]
Q413  2N7000  [TO92-DGS]
Q414  2N7000  [TO92-DGS]
Q730  2N7000  [TO92-DGS]
Q731  2N7000  [TO92-DGS]
R221  10k  R_P2INCH  [R_P2INCH]
R222  10k  R_P2INCH  [R_P2INCH]
R223  10k  R_P2INCH  [R_P2INCH]
R224  10k  R_P2INCH  [R_P2INCH]
R225  470  R_P2INCH  [R_P2INCH]
R226  10k  R_P2INCH  [R_P2INCH]
R227  10k  R_P2INCH  [R_P2INCH]
R228  10k  R_P2INCH  [R_P2INCH]
R229  10k  R_P2INCH  [R_P2INCH]
R230  470  R_P2INCH  [R_P2INCH]
R459  10k  R_P2INCH  [R_P2INCH]
R460  10k  R_P2INCH  [R_P2INCH]

### Nets
+5V: D45.A D46.A R221.2 R222.2 R223.2 R224.2 R226.2 R227.2 R228.2 R229.2 R459.2 R460.2 ; also sheet 2,4,5,6,7,8,9,10,11,12,13,14,15,16,17,18,19,20,21,22,23,24,25,26,27,28,29,30,32,33,34,35,36,37,38,39,40,41,42,43,44
B5_4: Q401.G Q403.D R224.1 R225.1
B5_4_N: Q402.D Q403.G Q413.G R223.1
B5_5: Q409.G Q411.D R229.1 R230.1
B5_5_N: Q410.D Q411.G Q414.G R228.1
BSEL5_N: Q730.G Q731.G ; also sheet 7,29,30,32
GND: Q397.S Q399.S Q401.S Q404.S Q405.S Q407.S Q409.S Q412.S Q413.S Q414.S Q730.S Q731.S ; also sheet 2,3,4,5,6,7,8,9,10,11,12,13,14,15,16,17,18,19,20,21,22,23,24,25,26,27,28,29,30,32,33,34,35,36,37,38,39,40,41,42,43,44
N$309: Q397.D Q398.S
N$310: Q399.D Q400.S
N$311: Q401.D Q402.S
N$312: Q398.D Q400.G Q402.G R221.1
N$313: Q400.D Q404.G R222.1
N$314: D45.K(C) R225.2
N$315: Q403.S Q404.D
N$316: Q405.D Q406.S
N$317: Q407.D Q408.S
N$318: Q409.D Q410.S
N$319: Q406.D Q408.G Q410.G R226.1
N$320: Q408.D Q412.G R227.1
N$321: D46.K(C) R230.2
N$322: Q411.S Q412.D
RD_5_4: Q413.D Q730.D R459.1 ; also sheet 43
RD_5_5: Q414.D Q731.D R460.1 ; also sheet 43
WD4: Q398.G ; also sheet 3,11,15,19,23,27,35,39
WD5: Q406.G ; also sheet 3,11,15,19,23,27,35,39
WR_BYTE5: Q397.G Q399.G Q405.G Q407.G ; also sheet 7,29,30,32

### Notes on the sheet
- Q | Q
- G1 | G2 | G3 | G4 | !Q | G1 | G2 | G3 | G4 | !Q
- D | D
- E
- E
- D
- 1
- E | 3 | Q\
- 4 | !Q
- 2

## Sheet 32 of 44
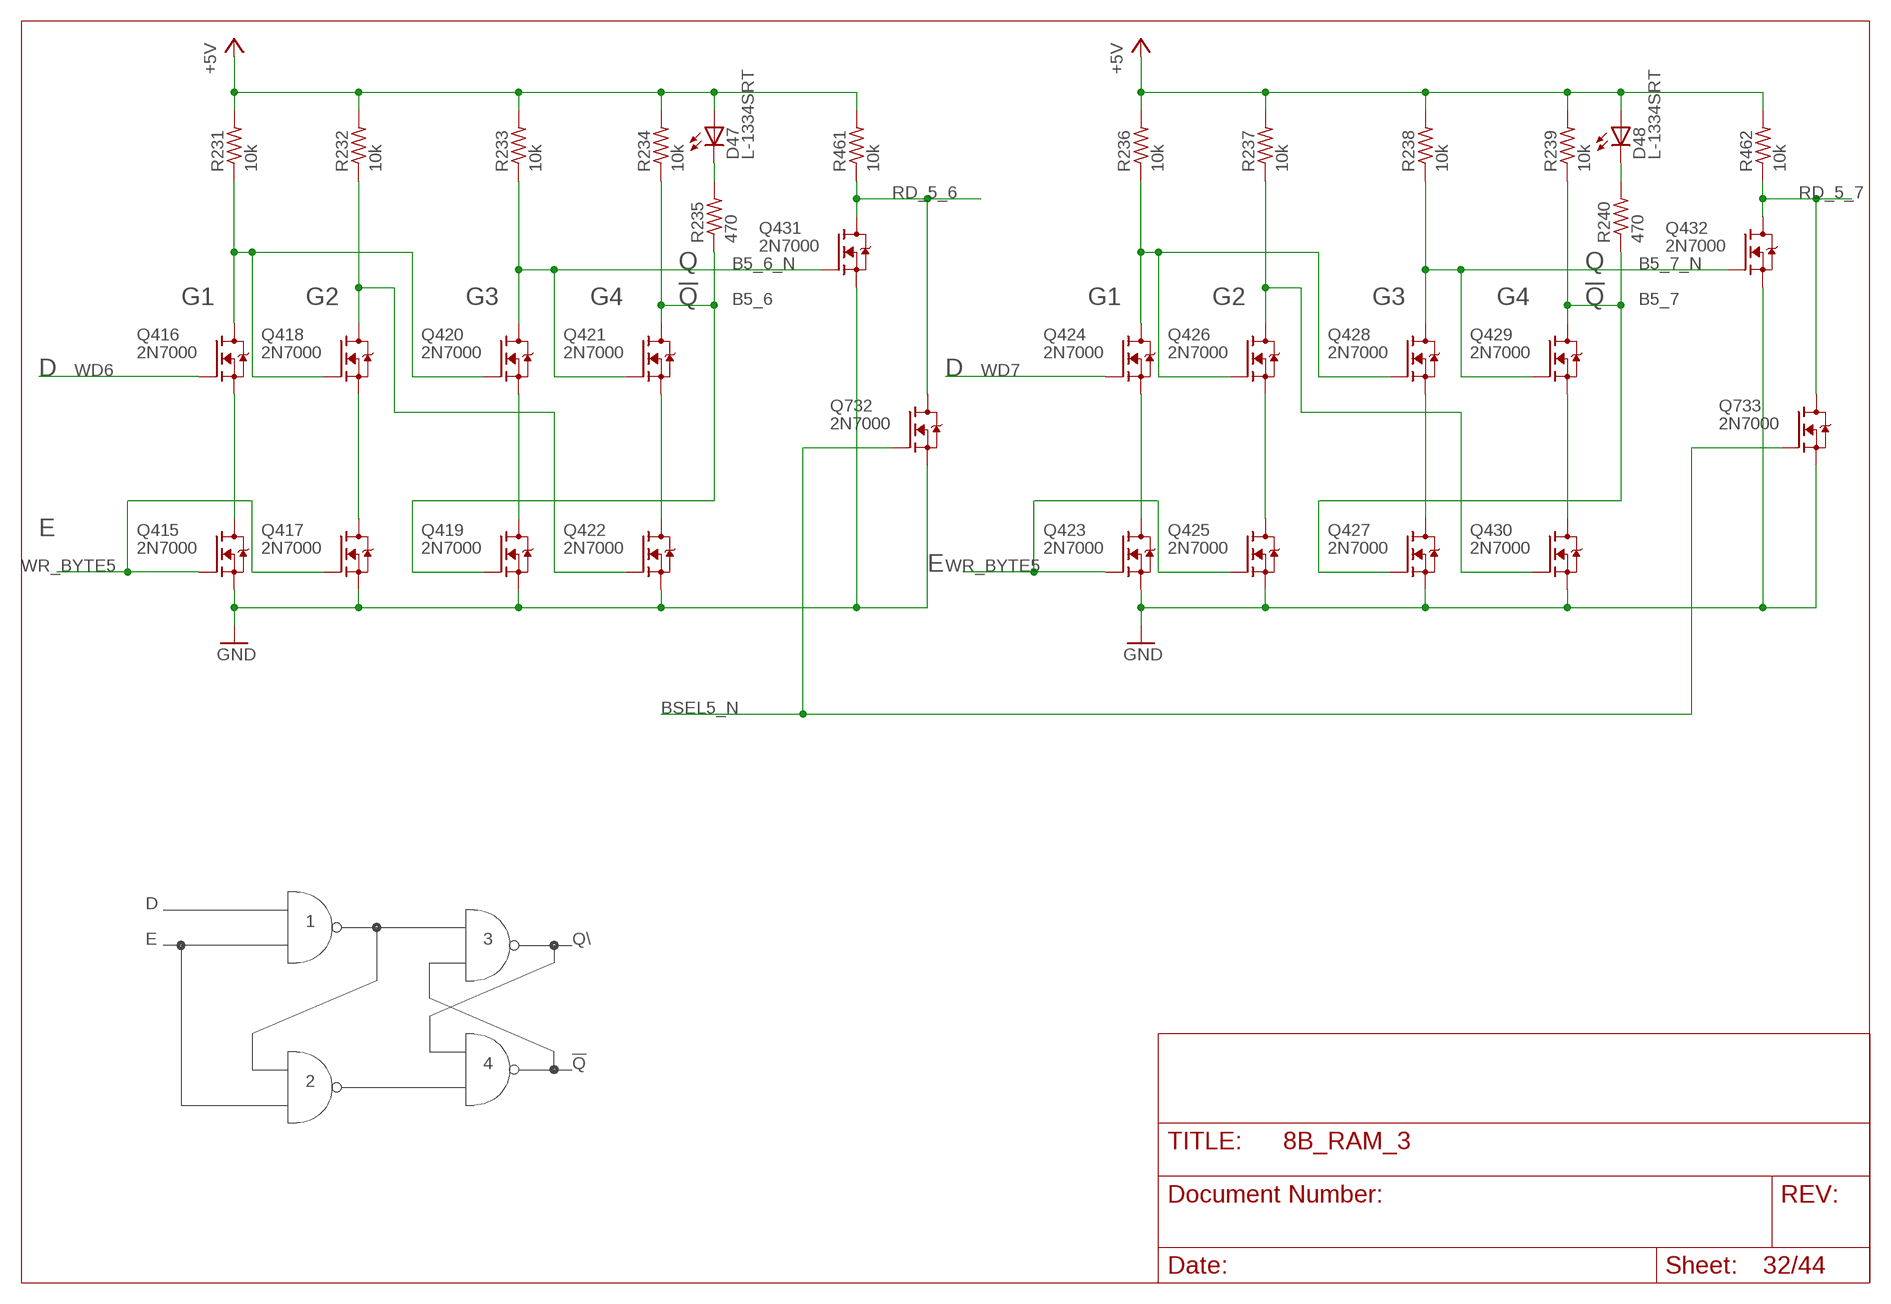
[diagram p31: schematic, sheet 32]

### Parts
D47  L-1334SRT  [LED3MM]
D48  L-1334SRT  [LED3MM]
Q415  2N7000  [TO92-DGS]
Q416  2N7000  [TO92-DGS]
Q417  2N7000  [TO92-DGS]
Q418  2N7000  [TO92-DGS]
Q419  2N7000  [TO92-DGS]
Q420  2N7000  [TO92-DGS]
Q421  2N7000  [TO92-DGS]
Q422  2N7000  [TO92-DGS]
Q423  2N7000  [TO92-DGS]
Q424  2N7000  [TO92-DGS]
Q425  2N7000  [TO92-DGS]
Q426  2N7000  [TO92-DGS]
Q427  2N7000  [TO92-DGS]
Q428  2N7000  [TO92-DGS]
Q429  2N7000  [TO92-DGS]
Q430  2N7000  [TO92-DGS]
Q431  2N7000  [TO92-DGS]
Q432  2N7000  [TO92-DGS]
Q732  2N7000  [TO92-DGS]
Q733  2N7000  [TO92-DGS]
R231  10k  R_P2INCH  [R_P2INCH]
R232  10k  R_P2INCH  [R_P2INCH]
R233  10k  R_P2INCH  [R_P2INCH]
R234  10k  R_P2INCH  [R_P2INCH]
R235  470  R_P2INCH  [R_P2INCH]
R236  10k  R_P2INCH  [R_P2INCH]
R237  10k  R_P2INCH  [R_P2INCH]
R238  10k  R_P2INCH  [R_P2INCH]
R239  10k  R_P2INCH  [R_P2INCH]
R240  470  R_P2INCH  [R_P2INCH]
R461  10k  R_P2INCH  [R_P2INCH]
R462  10k  R_P2INCH  [R_P2INCH]

### Nets
+5V: D47.A D48.A R231.2 R232.2 R233.2 R234.2 R236.2 R237.2 R238.2 R239.2 R461.2 R462.2 ; also sheet 2,4,5,6,7,8,9,10,11,12,13,14,15,16,17,18,19,20,21,22,23,24,25,26,27,28,29,30,31,33,34,35,36,37,38,39,40,41,42,43,44
B5_6: Q419.G Q421.D R234.1 R235.1
B5_6_N: Q420.D Q421.G Q431.G R233.1
B5_7: Q427.G Q429.D R239.1 R240.1
B5_7_N: Q428.D Q429.G Q432.G R238.1
BSEL5_N: Q732.G Q733.G ; also sheet 7,29,30,31
GND: Q415.S Q417.S Q419.S Q422.S Q423.S Q425.S Q427.S Q430.S Q431.S Q432.S Q732.S Q733.S ; also sheet 2,3,4,5,6,7,8,9,10,11,12,13,14,15,16,17,18,19,20,21,22,23,24,25,26,27,28,29,30,31,33,34,35,36,37,38,39,40,41,42,43,44
N$323: Q415.D Q416.S
N$324: Q417.D Q418.S
N$325: Q419.D Q420.S
N$326: Q416.D Q418.G Q420.G R231.1
N$327: Q418.D Q422.G R232.1
N$328: D47.K(C) R235.2
N$329: Q421.S Q422.D
N$330: Q423.D Q424.S
N$331: Q425.D Q426.S
N$332: Q427.D Q428.S
N$333: Q424.D Q426.G Q428.G R236.1
N$334: Q426.D Q430.G R237.1
N$335: D48.K(C) R240.2
N$336: Q429.S Q430.D
RD_5_6: Q431.D Q732.D R461.1 ; also sheet 44
RD_5_7: Q432.D Q733.D R462.1 ; also sheet 44
WD6: Q416.G ; also sheet 3,12,16,20,24,28,36,40
WD7: Q424.G ; also sheet 3,12,16,20,24,28,36,40
WR_BYTE5: Q415.G Q417.G Q423.G Q425.G ; also sheet 7,29,30,31

### Notes on the sheet
- Q | Q
- G1 | G2 | G3 | G4 | !Q | G1 | G2 | G3 | G4 | !Q
- D | D
- E
- E
- D
- 1
- E | 3 | Q\
- 4 | !Q
- 2

## Sheet 33 of 44
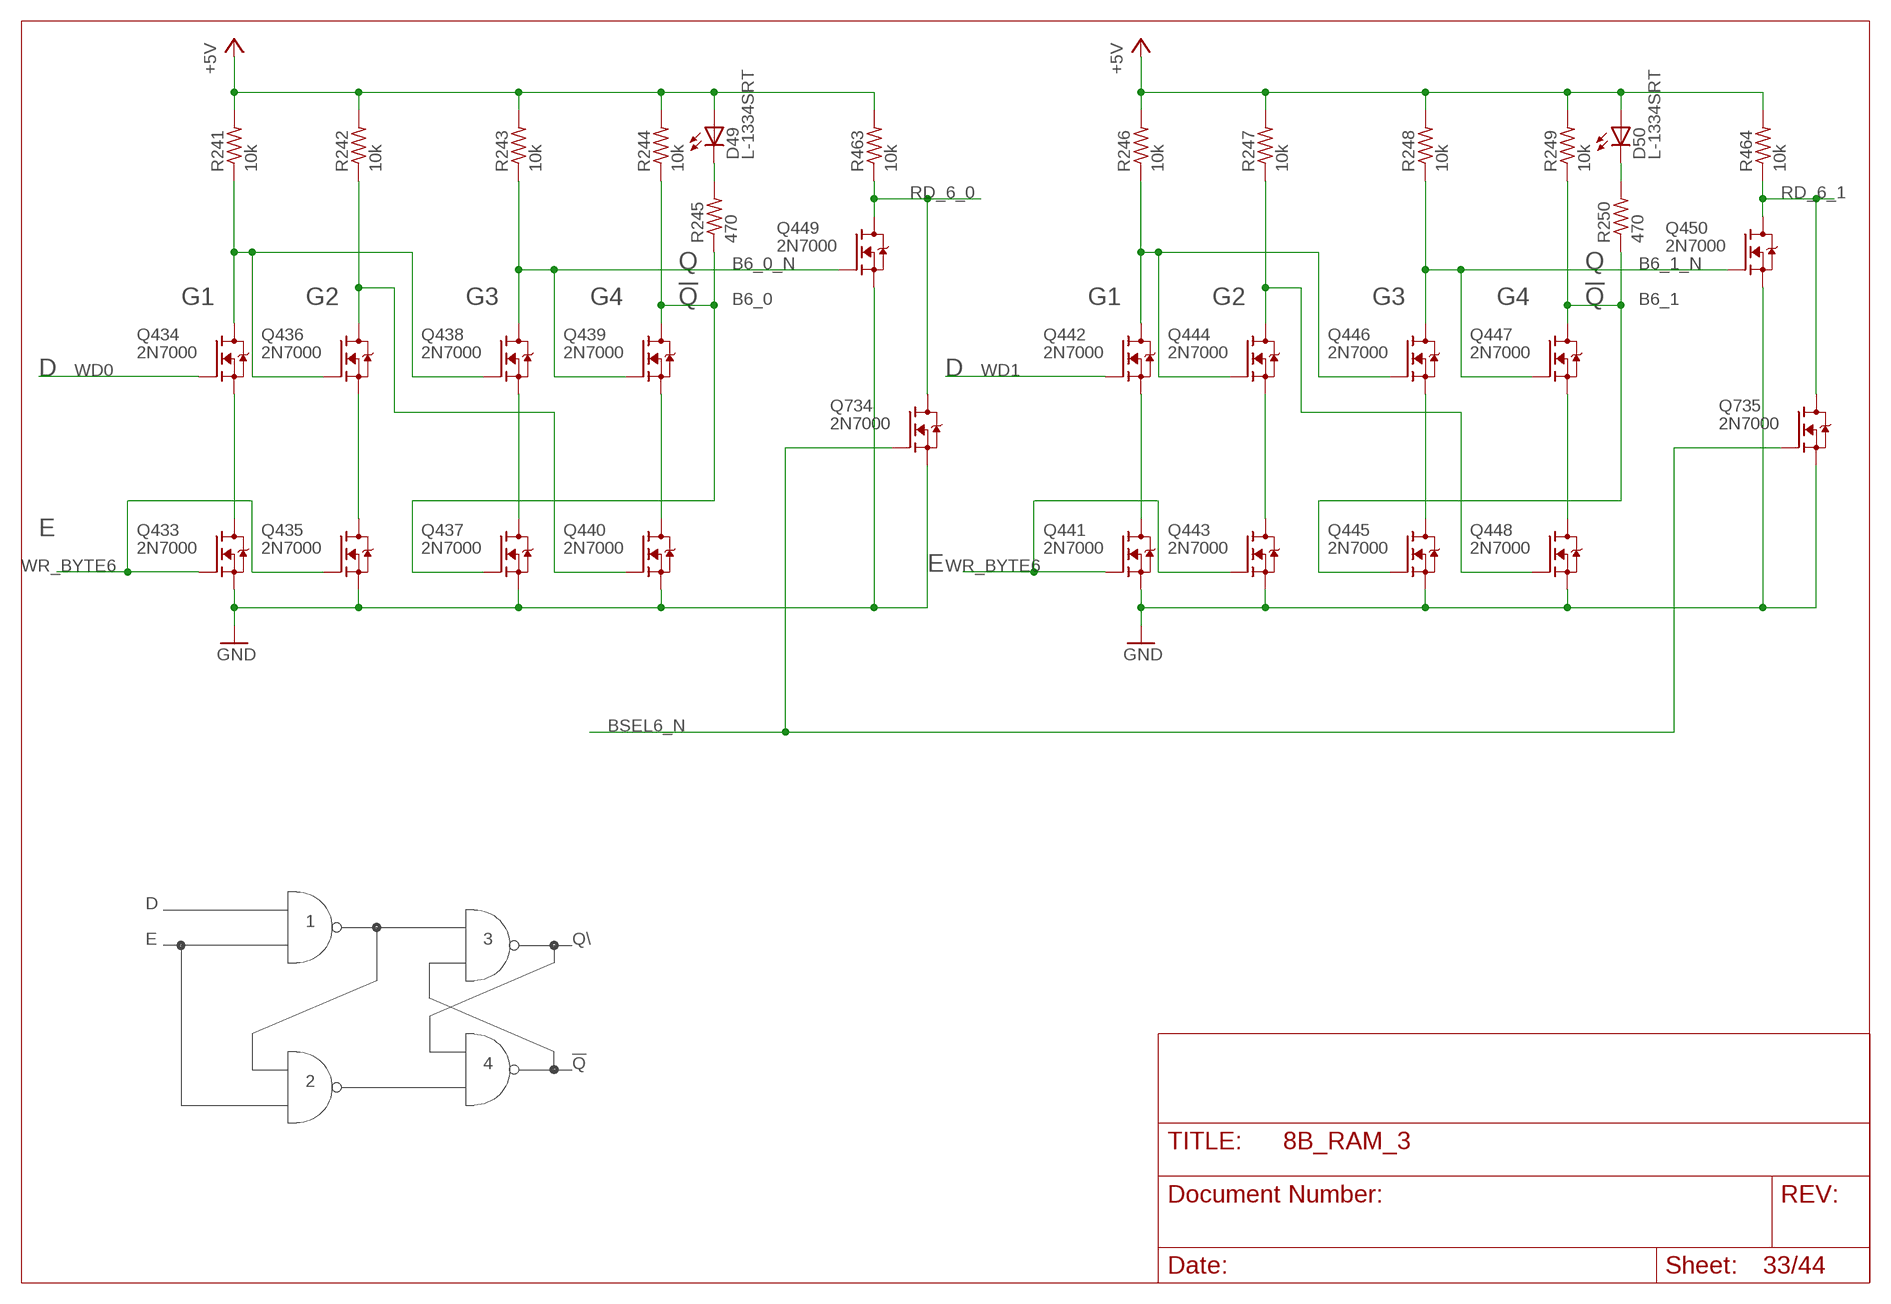
[diagram p32: schematic, sheet 33]

### Parts
D49  L-1334SRT  [LED3MM]
D50  L-1334SRT  [LED3MM]
Q433  2N7000  [TO92-DGS]
Q434  2N7000  [TO92-DGS]
Q435  2N7000  [TO92-DGS]
Q436  2N7000  [TO92-DGS]
Q437  2N7000  [TO92-DGS]
Q438  2N7000  [TO92-DGS]
Q439  2N7000  [TO92-DGS]
Q440  2N7000  [TO92-DGS]
Q441  2N7000  [TO92-DGS]
Q442  2N7000  [TO92-DGS]
Q443  2N7000  [TO92-DGS]
Q444  2N7000  [TO92-DGS]
Q445  2N7000  [TO92-DGS]
Q446  2N7000  [TO92-DGS]
Q447  2N7000  [TO92-DGS]
Q448  2N7000  [TO92-DGS]
Q449  2N7000  [TO92-DGS]
Q450  2N7000  [TO92-DGS]
Q734  2N7000  [TO92-DGS]
Q735  2N7000  [TO92-DGS]
R241  10k  R_P2INCH  [R_P2INCH]
R242  10k  R_P2INCH  [R_P2INCH]
R243  10k  R_P2INCH  [R_P2INCH]
R244  10k  R_P2INCH  [R_P2INCH]
R245  470  R_P2INCH  [R_P2INCH]
R246  10k  R_P2INCH  [R_P2INCH]
R247  10k  R_P2INCH  [R_P2INCH]
R248  10k  R_P2INCH  [R_P2INCH]
R249  10k  R_P2INCH  [R_P2INCH]
R250  470  R_P2INCH  [R_P2INCH]
R463  10k  R_P2INCH  [R_P2INCH]
R464  10k  R_P2INCH  [R_P2INCH]

### Nets
+5V: D49.A D50.A R241.2 R242.2 R243.2 R244.2 R246.2 R247.2 R248.2 R249.2 R463.2 R464.2 ; also sheet 2,4,5,6,7,8,9,10,11,12,13,14,15,16,17,18,19,20,21,22,23,24,25,26,27,28,29,30,31,32,34,35,36,37,38,39,40,41,42,43,44
B6_0: Q437.G Q439.D R244.1 R245.1
B6_0_N: Q438.D Q439.G Q449.G R243.1
B6_1: Q445.G Q447.D R249.1 R250.1
B6_1_N: Q446.D Q447.G Q450.G R248.1
BSEL6_N: Q734.G Q735.G ; also sheet 8,34,35,36
GND: Q433.S Q435.S Q437.S Q440.S Q441.S Q443.S Q445.S Q448.S Q449.S Q450.S Q734.S Q735.S ; also sheet 2,3,4,5,6,7,8,9,10,11,12,13,14,15,16,17,18,19,20,21,22,23,24,25,26,27,28,29,30,31,32,34,35,36,37,38,39,40,41,42,43,44
N$337: Q433.D Q434.S
N$338: Q435.D Q436.S
N$339: Q437.D Q438.S
N$340: Q434.D Q436.G Q438.G R241.1
N$341: Q436.D Q440.G R242.1
N$342: D49.K(C) R245.2
N$343: Q439.S Q440.D
N$344: Q441.D Q442.S
N$345: Q443.D Q444.S
N$346: Q445.D Q446.S
N$347: Q442.D Q444.G Q446.G R246.1
N$348: Q444.D Q448.G R247.1
N$349: D50.K(C) R250.2
N$350: Q447.S Q448.D
RD_6_0: Q449.D Q734.D R463.1 ; also sheet 41
RD_6_1: Q450.D Q735.D R464.1 ; also sheet 41
WD0: Q434.G ; also sheet 3,9,13,17,21,25,29,37
WD1: Q442.G ; also sheet 3,9,13,17,21,25,29,37
WR_BYTE6: Q433.G Q435.G Q441.G Q443.G ; also sheet 8,34,35,36

### Notes on the sheet
- Q | Q
- G1 | G2 | G3 | G4 | !Q | G1 | G2 | G3 | G4 | !Q
- D | D
- E
- E
- D
- 1
- E | 3 | Q\
- 4 | !Q
- 2

## Sheet 34 of 44
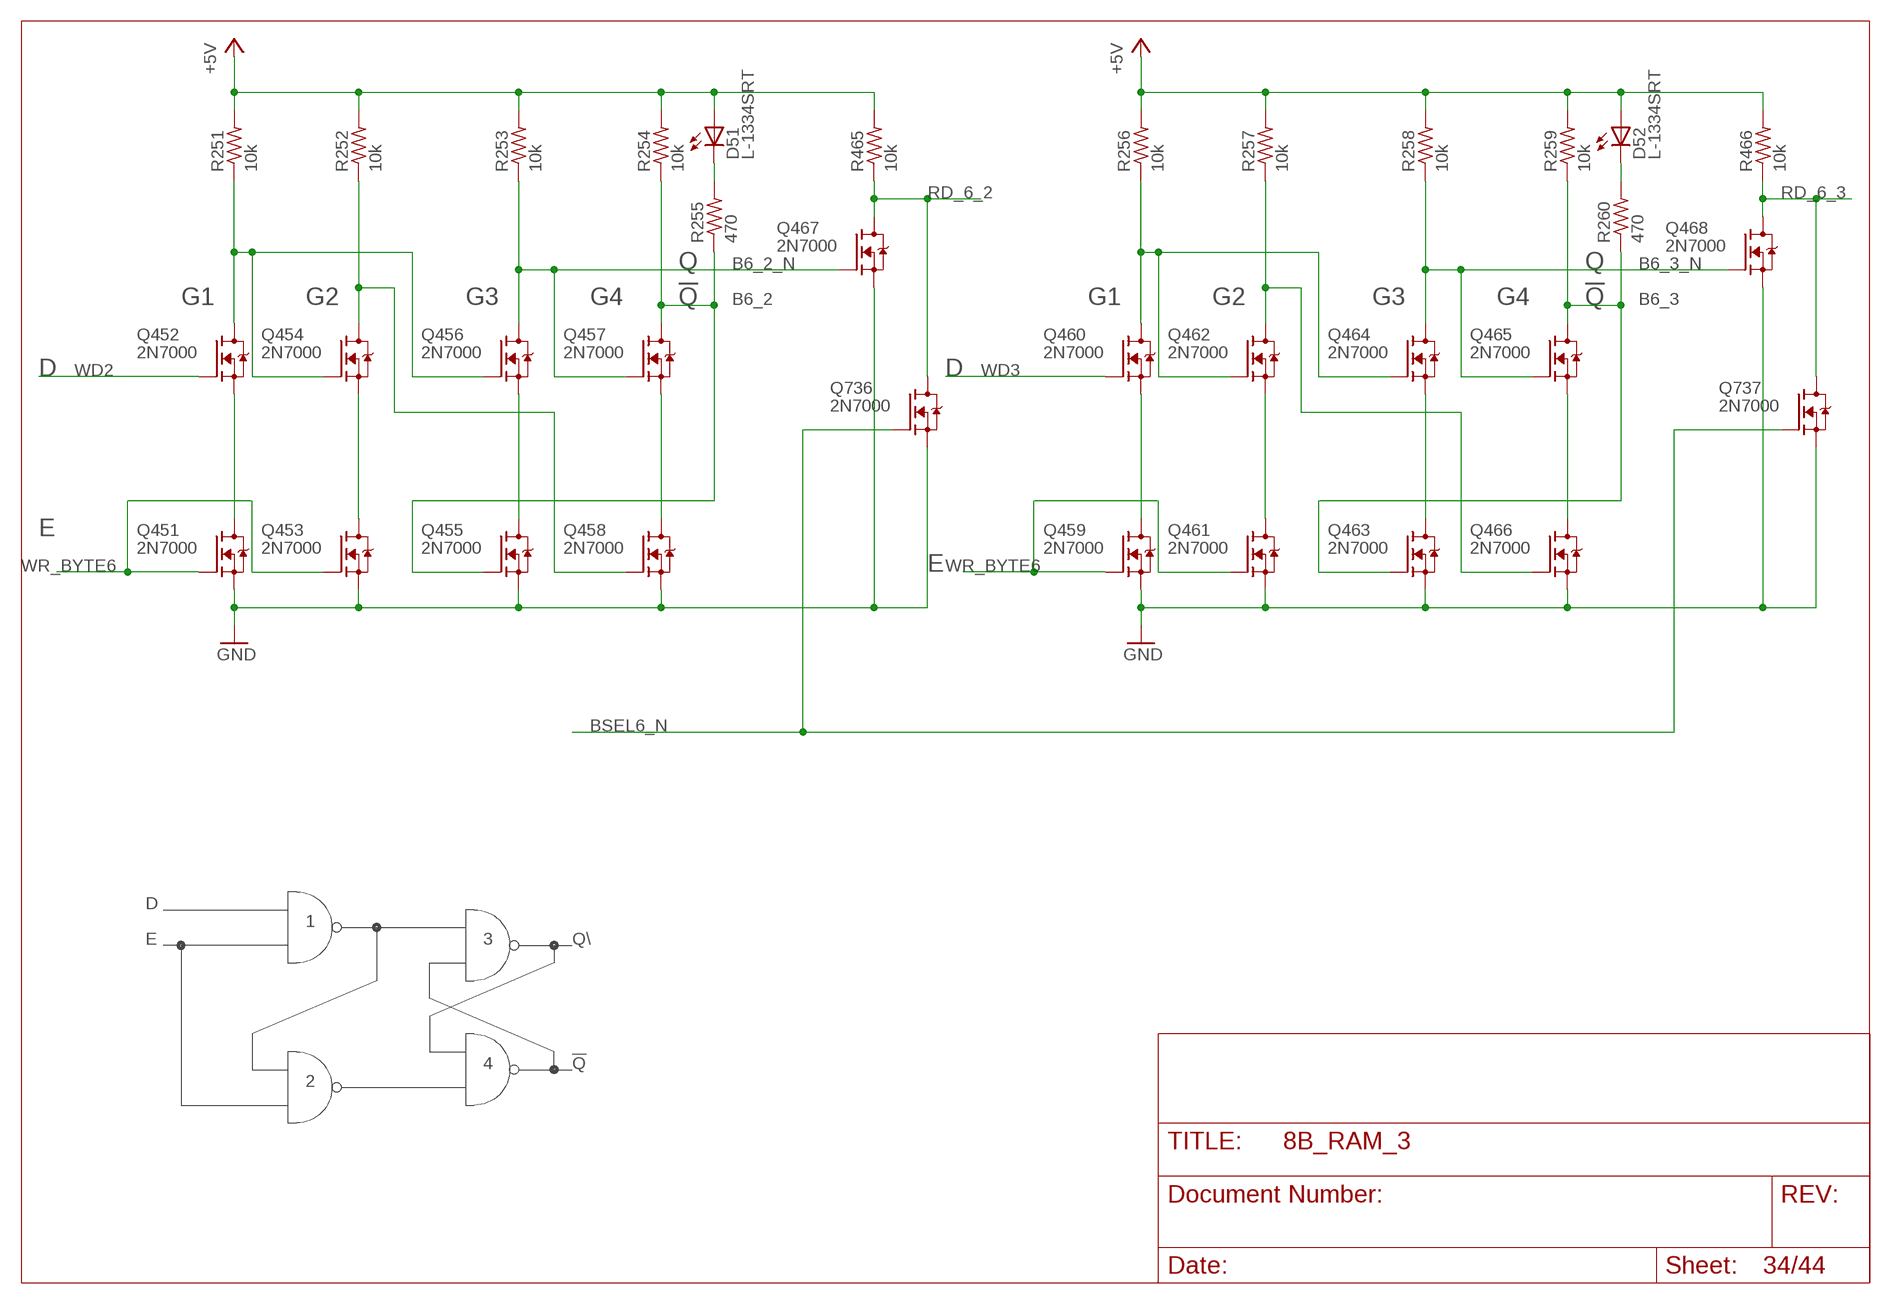
[diagram p33: schematic, sheet 34]

### Parts
D51  L-1334SRT  [LED3MM]
D52  L-1334SRT  [LED3MM]
Q451  2N7000  [TO92-DGS]
Q452  2N7000  [TO92-DGS]
Q453  2N7000  [TO92-DGS]
Q454  2N7000  [TO92-DGS]
Q455  2N7000  [TO92-DGS]
Q456  2N7000  [TO92-DGS]
Q457  2N7000  [TO92-DGS]
Q458  2N7000  [TO92-DGS]
Q459  2N7000  [TO92-DGS]
Q460  2N7000  [TO92-DGS]
Q461  2N7000  [TO92-DGS]
Q462  2N7000  [TO92-DGS]
Q463  2N7000  [TO92-DGS]
Q464  2N7000  [TO92-DGS]
Q465  2N7000  [TO92-DGS]
Q466  2N7000  [TO92-DGS]
Q467  2N7000  [TO92-DGS]
Q468  2N7000  [TO92-DGS]
Q736  2N7000  [TO92-DGS]
Q737  2N7000  [TO92-DGS]
R251  10k  R_P2INCH  [R_P2INCH]
R252  10k  R_P2INCH  [R_P2INCH]
R253  10k  R_P2INCH  [R_P2INCH]
R254  10k  R_P2INCH  [R_P2INCH]
R255  470  R_P2INCH  [R_P2INCH]
R256  10k  R_P2INCH  [R_P2INCH]
R257  10k  R_P2INCH  [R_P2INCH]
R258  10k  R_P2INCH  [R_P2INCH]
R259  10k  R_P2INCH  [R_P2INCH]
R260  470  R_P2INCH  [R_P2INCH]
R465  10k  R_P2INCH  [R_P2INCH]
R466  10k  R_P2INCH  [R_P2INCH]

### Nets
+5V: D51.A D52.A R251.2 R252.2 R253.2 R254.2 R256.2 R257.2 R258.2 R259.2 R465.2 R466.2 ; also sheet 2,4,5,6,7,8,9,10,11,12,13,14,15,16,17,18,19,20,21,22,23,24,25,26,27,28,29,30,31,32,33,35,36,37,38,39,40,41,42,43,44
B6_2: Q455.G Q457.D R254.1 R255.1
B6_2_N: Q456.D Q457.G Q467.G R253.1
B6_3: Q463.G Q465.D R259.1 R260.1
B6_3_N: Q464.D Q465.G Q468.G R258.1
BSEL6_N: Q736.G Q737.G ; also sheet 8,33,35,36
GND: Q451.S Q453.S Q455.S Q458.S Q459.S Q461.S Q463.S Q466.S Q467.S Q468.S Q736.S Q737.S ; also sheet 2,3,4,5,6,7,8,9,10,11,12,13,14,15,16,17,18,19,20,21,22,23,24,25,26,27,28,29,30,31,32,33,35,36,37,38,39,40,41,42,43,44
N$351: Q451.D Q452.S
N$352: Q453.D Q454.S
N$353: Q455.D Q456.S
N$354: Q452.D Q454.G Q456.G R251.1
N$355: Q454.D Q458.G R252.1
N$356: D51.K(C) R255.2
N$357: Q457.S Q458.D
N$358: Q459.D Q460.S
N$359: Q461.D Q462.S
N$360: Q463.D Q464.S
N$361: Q460.D Q462.G Q464.G R256.1
N$362: Q462.D Q466.G R257.1
N$363: D52.K(C) R260.2
N$364: Q465.S Q466.D
RD_6_2: Q467.D Q736.D R465.1 ; also sheet 42
RD_6_3: Q468.D Q737.D R466.1 ; also sheet 42
WD2: Q452.G ; also sheet 3,10,14,18,22,26,30,38
WD3: Q460.G ; also sheet 3,10,14,18,22,26,30,38
WR_BYTE6: Q451.G Q453.G Q459.G Q461.G ; also sheet 8,33,35,36

### Notes on the sheet
- Q | Q
- G1 | G2 | G3 | G4 | !Q | G1 | G2 | G3 | G4 | !Q
- D | D
- E
- E
- D
- 1
- E | 3 | Q\
- 4 | !Q
- 2

## Sheet 35 of 44
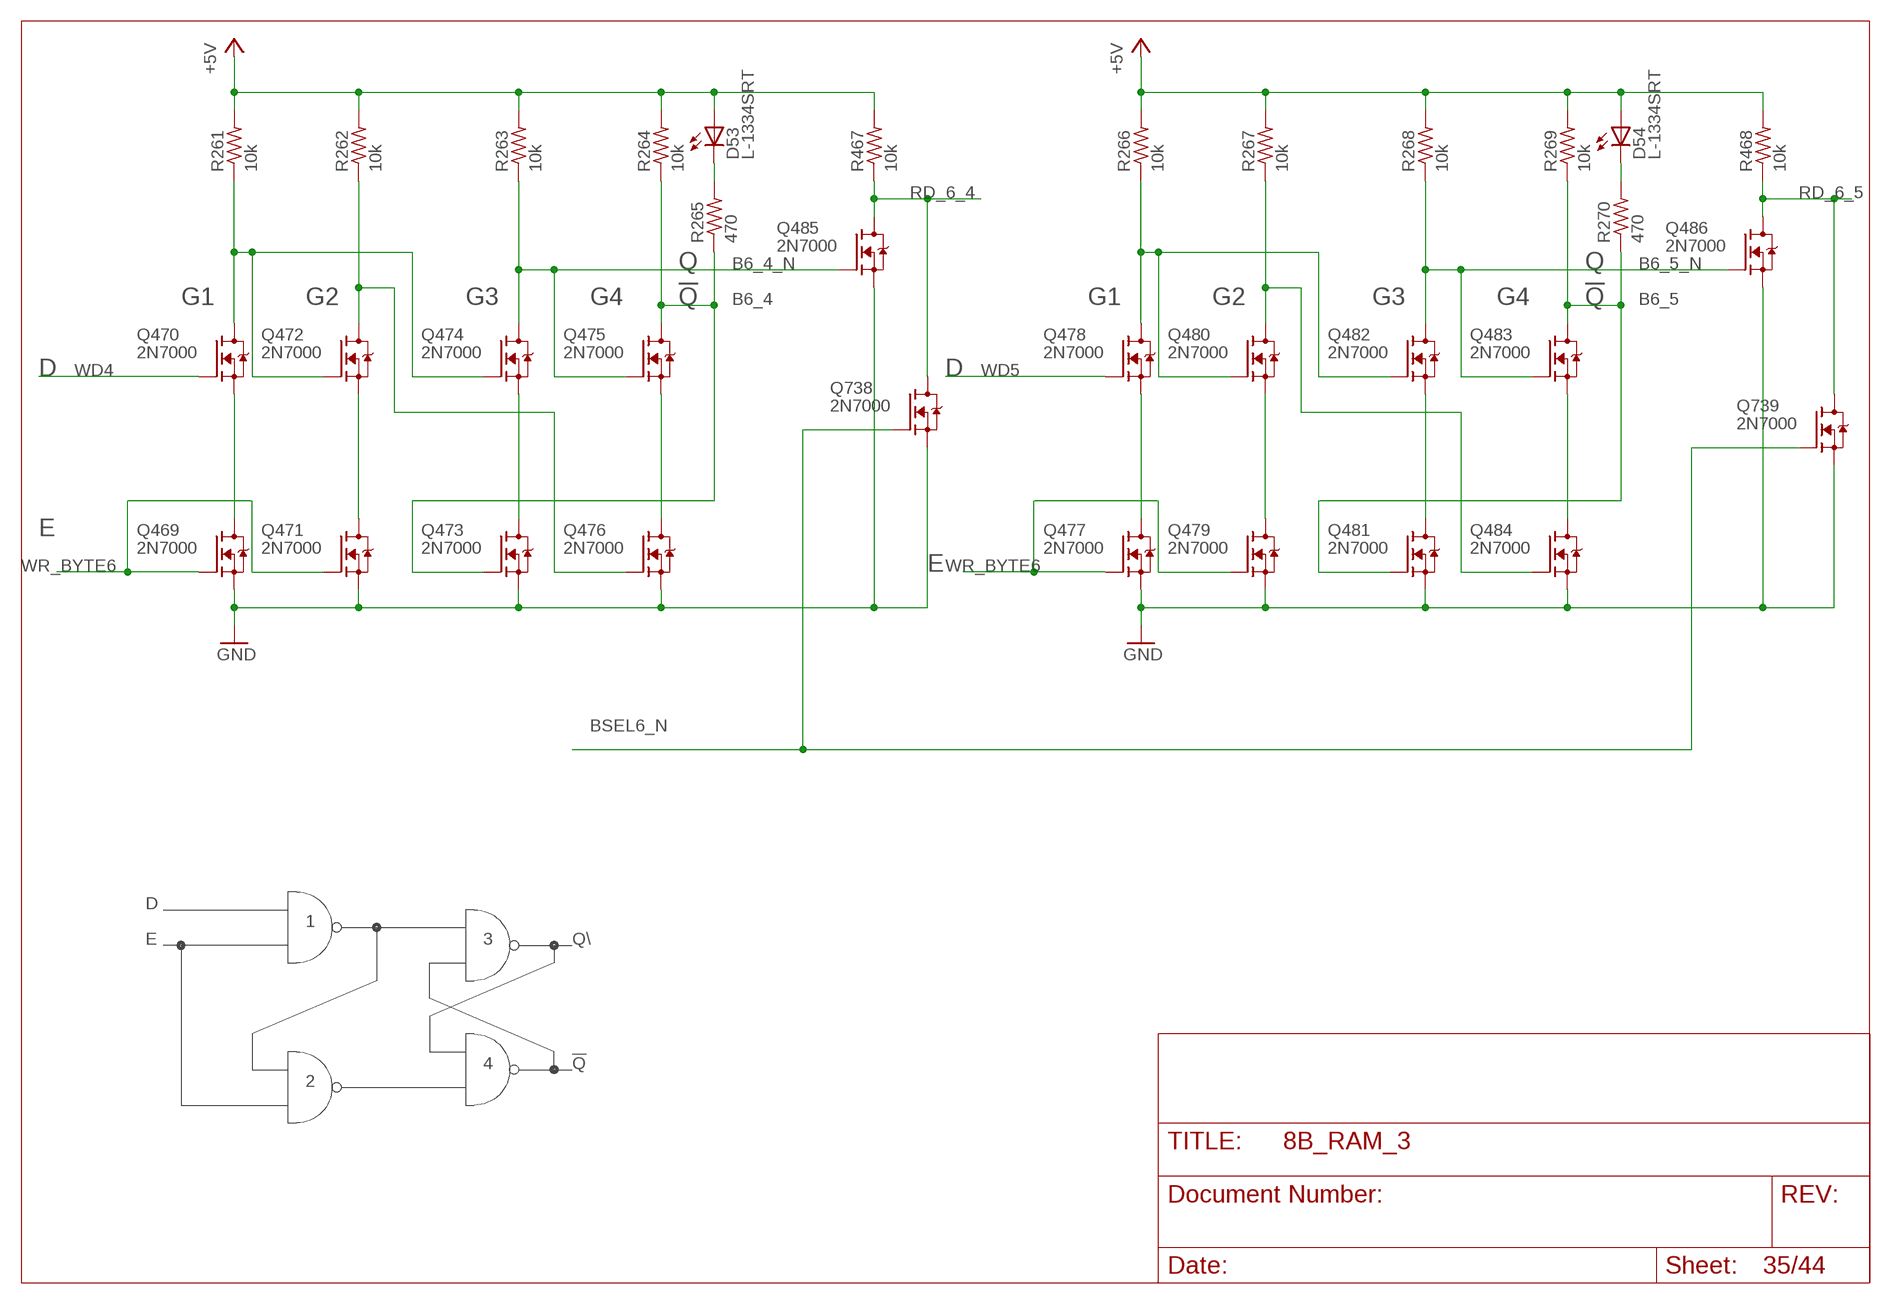
[diagram p34: schematic, sheet 35]

### Parts
D53  L-1334SRT  [LED3MM]
D54  L-1334SRT  [LED3MM]
Q469  2N7000  [TO92-DGS]
Q470  2N7000  [TO92-DGS]
Q471  2N7000  [TO92-DGS]
Q472  2N7000  [TO92-DGS]
Q473  2N7000  [TO92-DGS]
Q474  2N7000  [TO92-DGS]
Q475  2N7000  [TO92-DGS]
Q476  2N7000  [TO92-DGS]
Q477  2N7000  [TO92-DGS]
Q478  2N7000  [TO92-DGS]
Q479  2N7000  [TO92-DGS]
Q480  2N7000  [TO92-DGS]
Q481  2N7000  [TO92-DGS]
Q482  2N7000  [TO92-DGS]
Q483  2N7000  [TO92-DGS]
Q484  2N7000  [TO92-DGS]
Q485  2N7000  [TO92-DGS]
Q486  2N7000  [TO92-DGS]
Q738  2N7000  [TO92-DGS]
Q739  2N7000  [TO92-DGS]
R261  10k  R_P2INCH  [R_P2INCH]
R262  10k  R_P2INCH  [R_P2INCH]
R263  10k  R_P2INCH  [R_P2INCH]
R264  10k  R_P2INCH  [R_P2INCH]
R265  470  R_P2INCH  [R_P2INCH]
R266  10k  R_P2INCH  [R_P2INCH]
R267  10k  R_P2INCH  [R_P2INCH]
R268  10k  R_P2INCH  [R_P2INCH]
R269  10k  R_P2INCH  [R_P2INCH]
R270  470  R_P2INCH  [R_P2INCH]
R467  10k  R_P2INCH  [R_P2INCH]
R468  10k  R_P2INCH  [R_P2INCH]

### Nets
+5V: D53.A D54.A R261.2 R262.2 R263.2 R264.2 R266.2 R267.2 R268.2 R269.2 R467.2 R468.2 ; also sheet 2,4,5,6,7,8,9,10,11,12,13,14,15,16,17,18,19,20,21,22,23,24,25,26,27,28,29,30,31,32,33,34,36,37,38,39,40,41,42,43,44
B6_4: Q473.G Q475.D R264.1 R265.1
B6_4_N: Q474.D Q475.G Q485.G R263.1
B6_5: Q481.G Q483.D R269.1 R270.1
B6_5_N: Q482.D Q483.G Q486.G R268.1
BSEL6_N: Q738.G Q739.G ; also sheet 8,33,34,36
GND: Q469.S Q471.S Q473.S Q476.S Q477.S Q479.S Q481.S Q484.S Q485.S Q486.S Q738.S Q739.S ; also sheet 2,3,4,5,6,7,8,9,10,11,12,13,14,15,16,17,18,19,20,21,22,23,24,25,26,27,28,29,30,31,32,33,34,36,37,38,39,40,41,42,43,44
N$365: Q469.D Q470.S
N$366: Q471.D Q472.S
N$367: Q473.D Q474.S
N$368: Q470.D Q472.G Q474.G R261.1
N$369: Q472.D Q476.G R262.1
N$370: D53.K(C) R265.2
N$371: Q475.S Q476.D
N$372: Q477.D Q478.S
N$373: Q479.D Q480.S
N$374: Q481.D Q482.S
N$375: Q478.D Q480.G Q482.G R266.1
N$376: Q480.D Q484.G R267.1
N$377: D54.K(C) R270.2
N$378: Q483.S Q484.D
RD_6_4: Q485.D Q738.D R467.1 ; also sheet 43
RD_6_5: Q486.D Q739.D R468.1 ; also sheet 43
WD4: Q470.G ; also sheet 3,11,15,19,23,27,31,39
WD5: Q478.G ; also sheet 3,11,15,19,23,27,31,39
WR_BYTE6: Q469.G Q471.G Q477.G Q479.G ; also sheet 8,33,34,36

### Notes on the sheet
- Q | Q
- G1 | G2 | G3 | G4 | !Q | G1 | G2 | G3 | G4 | !Q
- D | D
- E
- E
- D
- 1
- E | 3 | Q\
- 4 | !Q
- 2

## Sheet 36 of 44
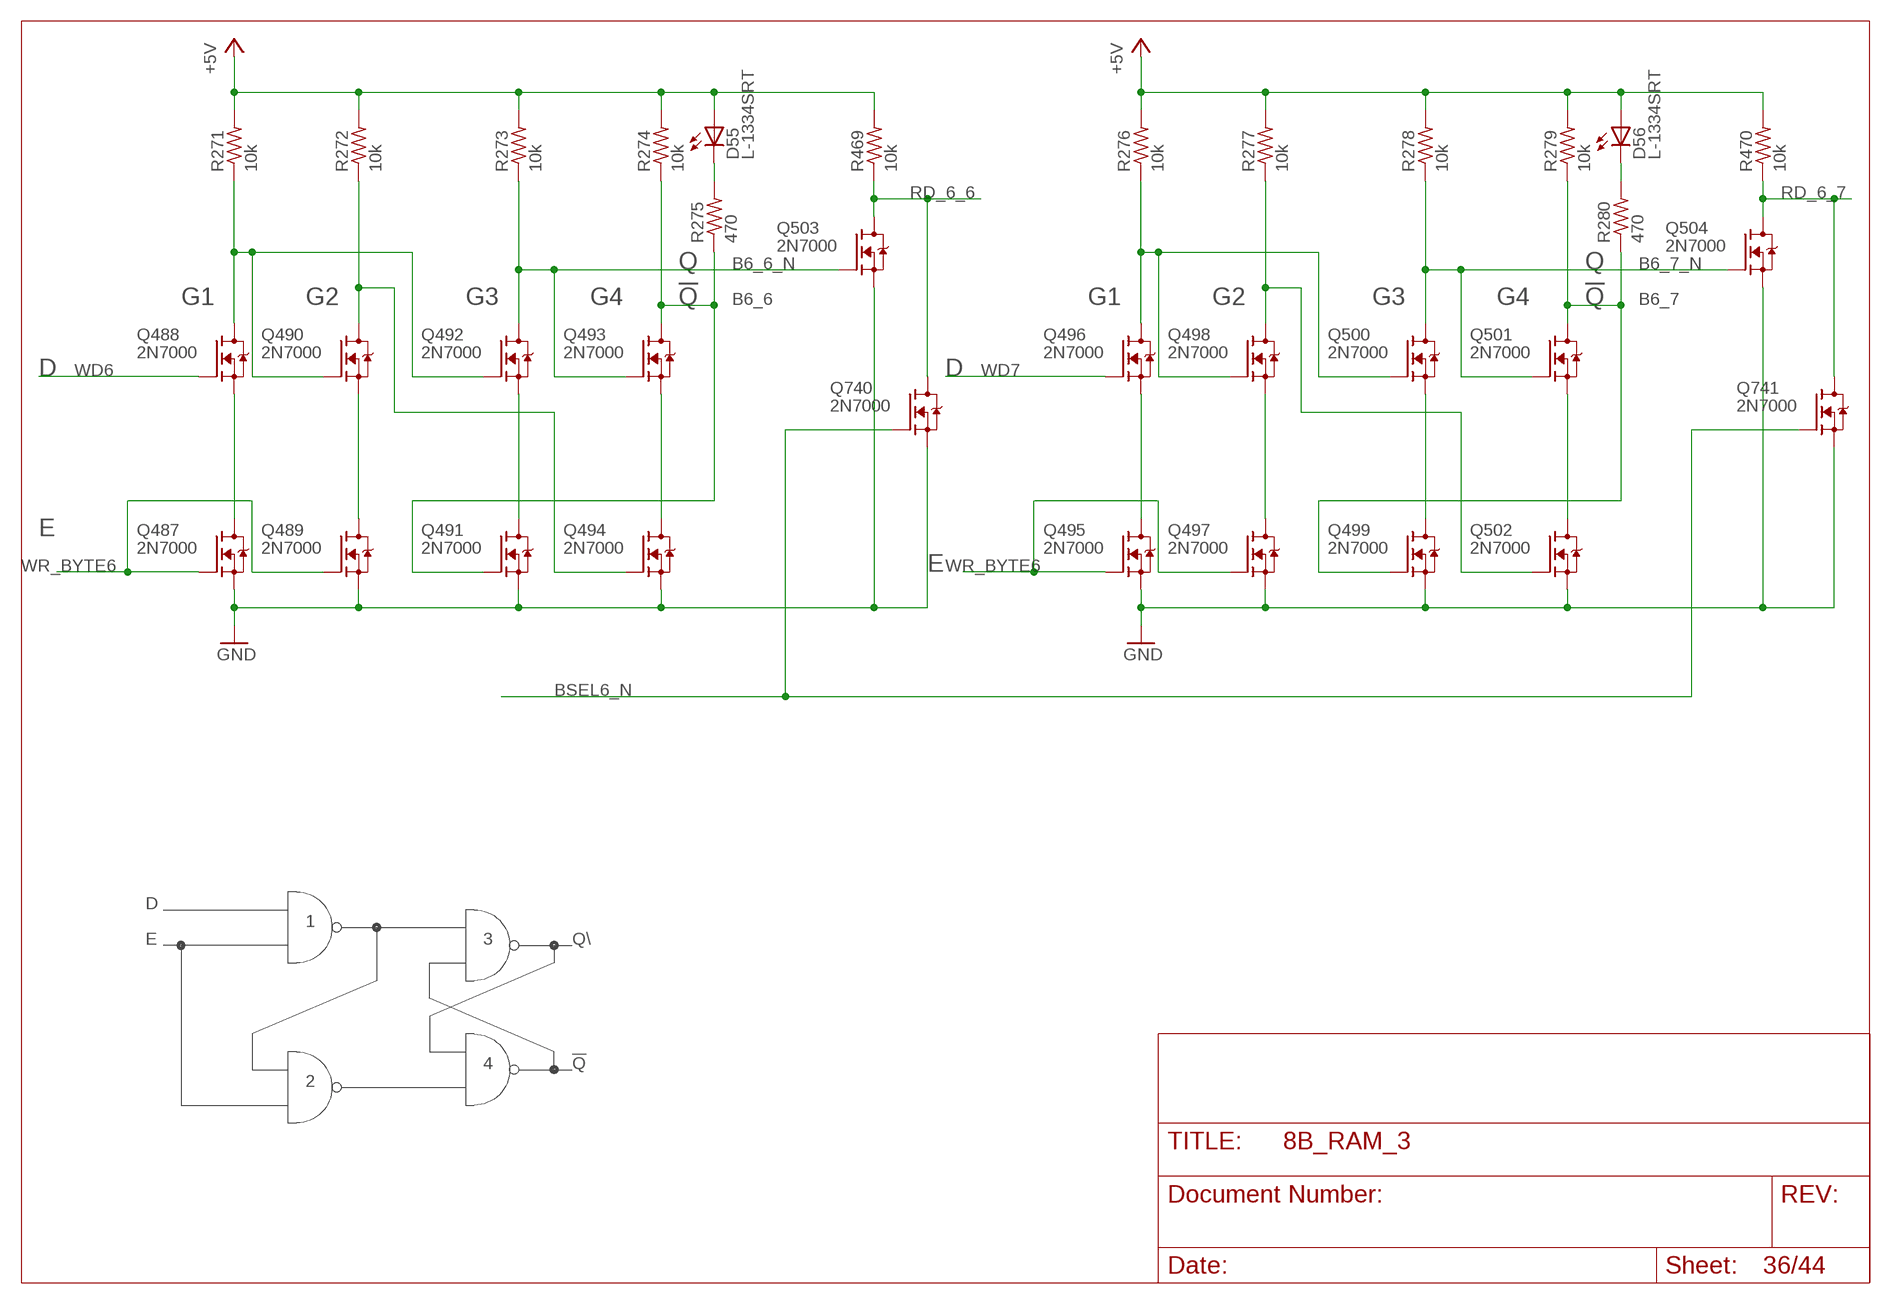
[diagram p35: schematic, sheet 36]

### Parts
D55  L-1334SRT  [LED3MM]
D56  L-1334SRT  [LED3MM]
Q487  2N7000  [TO92-DGS]
Q488  2N7000  [TO92-DGS]
Q489  2N7000  [TO92-DGS]
Q490  2N7000  [TO92-DGS]
Q491  2N7000  [TO92-DGS]
Q492  2N7000  [TO92-DGS]
Q493  2N7000  [TO92-DGS]
Q494  2N7000  [TO92-DGS]
Q495  2N7000  [TO92-DGS]
Q496  2N7000  [TO92-DGS]
Q497  2N7000  [TO92-DGS]
Q498  2N7000  [TO92-DGS]
Q499  2N7000  [TO92-DGS]
Q500  2N7000  [TO92-DGS]
Q501  2N7000  [TO92-DGS]
Q502  2N7000  [TO92-DGS]
Q503  2N7000  [TO92-DGS]
Q504  2N7000  [TO92-DGS]
Q740  2N7000  [TO92-DGS]
Q741  2N7000  [TO92-DGS]
R271  10k  R_P2INCH  [R_P2INCH]
R272  10k  R_P2INCH  [R_P2INCH]
R273  10k  R_P2INCH  [R_P2INCH]
R274  10k  R_P2INCH  [R_P2INCH]
R275  470  R_P2INCH  [R_P2INCH]
R276  10k  R_P2INCH  [R_P2INCH]
R277  10k  R_P2INCH  [R_P2INCH]
R278  10k  R_P2INCH  [R_P2INCH]
R279  10k  R_P2INCH  [R_P2INCH]
R280  470  R_P2INCH  [R_P2INCH]
R469  10k  R_P2INCH  [R_P2INCH]
R470  10k  R_P2INCH  [R_P2INCH]

### Nets
+5V: D55.A D56.A R271.2 R272.2 R273.2 R274.2 R276.2 R277.2 R278.2 R279.2 R469.2 R470.2 ; also sheet 2,4,5,6,7,8,9,10,11,12,13,14,15,16,17,18,19,20,21,22,23,24,25,26,27,28,29,30,31,32,33,34,35,37,38,39,40,41,42,43,44
B6_6: Q491.G Q493.D R274.1 R275.1
B6_6_N: Q492.D Q493.G Q503.G R273.1
B6_7: Q499.G Q501.D R279.1 R280.1
B6_7_N: Q500.D Q501.G Q504.G R278.1
BSEL6_N: Q740.G Q741.G ; also sheet 8,33,34,35
GND: Q487.S Q489.S Q491.S Q494.S Q495.S Q497.S Q499.S Q502.S Q503.S Q504.S Q740.S Q741.S ; also sheet 2,3,4,5,6,7,8,9,10,11,12,13,14,15,16,17,18,19,20,21,22,23,24,25,26,27,28,29,30,31,32,33,34,35,37,38,39,40,41,42,43,44
N$379: Q487.D Q488.S
N$380: Q489.D Q490.S
N$381: Q491.D Q492.S
N$382: Q488.D Q490.G Q492.G R271.1
N$383: Q490.D Q494.G R272.1
N$384: D55.K(C) R275.2
N$385: Q493.S Q494.D
N$386: Q495.D Q496.S
N$387: Q497.D Q498.S
N$388: Q499.D Q500.S
N$389: Q496.D Q498.G Q500.G R276.1
N$390: Q498.D Q502.G R277.1
N$391: D56.K(C) R280.2
N$392: Q501.S Q502.D
RD_6_6: Q503.D Q740.D R469.1 ; also sheet 44
RD_6_7: Q504.D Q741.D R470.1 ; also sheet 44
WD6: Q488.G ; also sheet 3,12,16,20,24,28,32,40
WD7: Q496.G ; also sheet 3,12,16,20,24,28,32,40
WR_BYTE6: Q487.G Q489.G Q495.G Q497.G ; also sheet 8,33,34,35

### Notes on the sheet
- Q | Q
- G1 | G2 | G3 | G4 | !Q | G1 | G2 | G3 | G4 | !Q
- D | D
- E
- E
- D
- 1
- E | 3 | Q\
- 4 | !Q
- 2

## Sheet 37 of 44
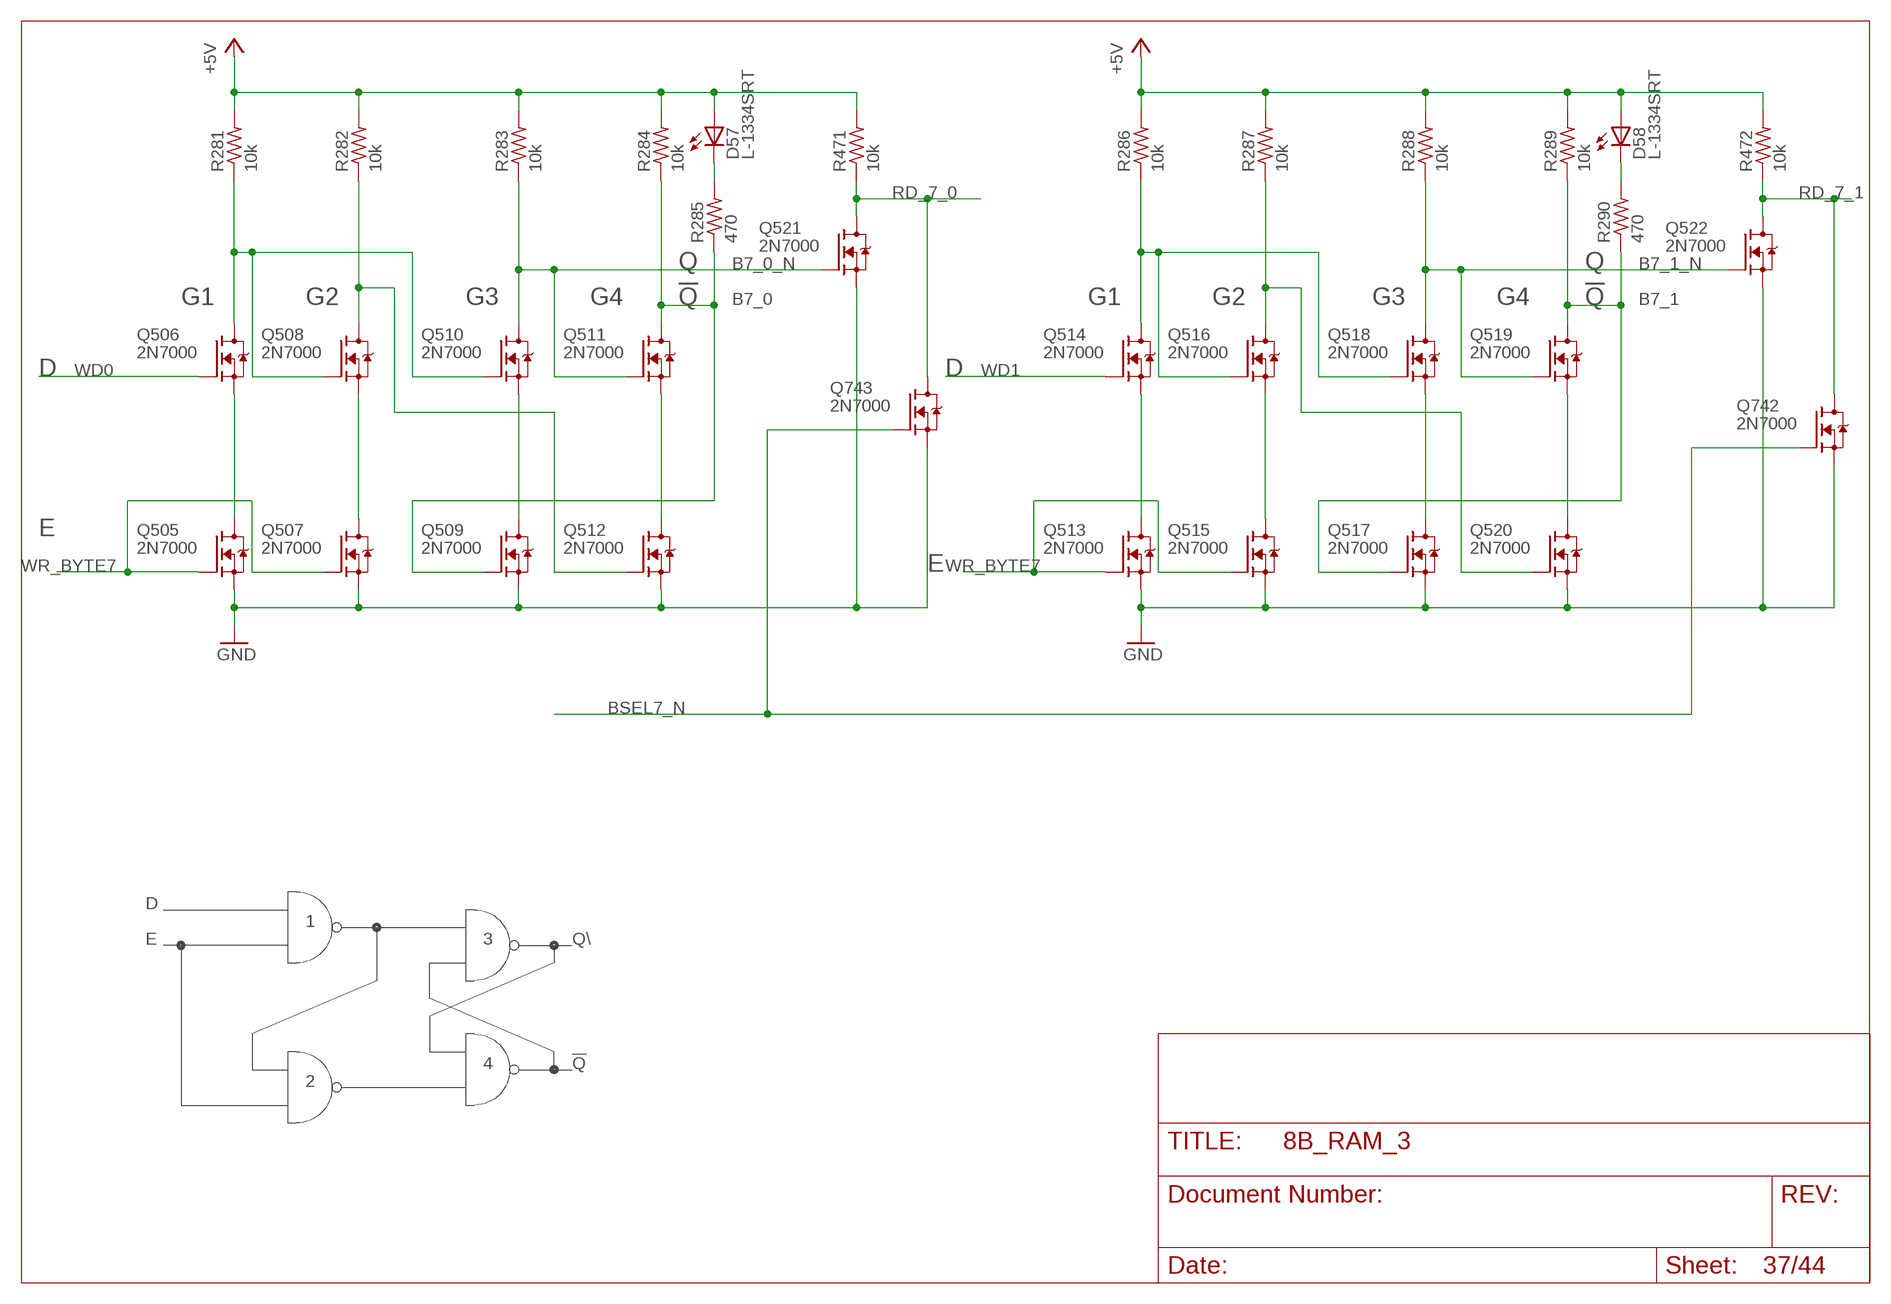
[diagram p36: schematic, sheet 37]

### Parts
D57  L-1334SRT  [LED3MM]
D58  L-1334SRT  [LED3MM]
Q505  2N7000  [TO92-DGS]
Q506  2N7000  [TO92-DGS]
Q507  2N7000  [TO92-DGS]
Q508  2N7000  [TO92-DGS]
Q509  2N7000  [TO92-DGS]
Q510  2N7000  [TO92-DGS]
Q511  2N7000  [TO92-DGS]
Q512  2N7000  [TO92-DGS]
Q513  2N7000  [TO92-DGS]
Q514  2N7000  [TO92-DGS]
Q515  2N7000  [TO92-DGS]
Q516  2N7000  [TO92-DGS]
Q517  2N7000  [TO92-DGS]
Q518  2N7000  [TO92-DGS]
Q519  2N7000  [TO92-DGS]
Q520  2N7000  [TO92-DGS]
Q521  2N7000  [TO92-DGS]
Q522  2N7000  [TO92-DGS]
Q742  2N7000  [TO92-DGS]
Q743  2N7000  [TO92-DGS]
R281  10k  R_P2INCH  [R_P2INCH]
R282  10k  R_P2INCH  [R_P2INCH]
R283  10k  R_P2INCH  [R_P2INCH]
R284  10k  R_P2INCH  [R_P2INCH]
R285  470  R_P2INCH  [R_P2INCH]
R286  10k  R_P2INCH  [R_P2INCH]
R287  10k  R_P2INCH  [R_P2INCH]
R288  10k  R_P2INCH  [R_P2INCH]
R289  10k  R_P2INCH  [R_P2INCH]
R290  470  R_P2INCH  [R_P2INCH]
R471  10k  R_P2INCH  [R_P2INCH]
R472  10k  R_P2INCH  [R_P2INCH]

### Nets
+5V: D57.A D58.A R281.2 R282.2 R283.2 R284.2 R286.2 R287.2 R288.2 R289.2 R471.2 R472.2 ; also sheet 2,4,5,6,7,8,9,10,11,12,13,14,15,16,17,18,19,20,21,22,23,24,25,26,27,28,29,30,31,32,33,34,35,36,38,39,40,41,42,43,44
B7_0: Q509.G Q511.D R284.1 R285.1
B7_0_N: Q510.D Q511.G Q521.G R283.1
B7_1: Q517.G Q519.D R289.1 R290.1
B7_1_N: Q518.D Q519.G Q522.G R288.1
BSEL7_N: Q742.G Q743.G ; also sheet 8,38,39,40
GND: Q505.S Q507.S Q509.S Q512.S Q513.S Q515.S Q517.S Q520.S Q521.S Q522.S Q742.S Q743.S ; also sheet 2,3,4,5,6,7,8,9,10,11,12,13,14,15,16,17,18,19,20,21,22,23,24,25,26,27,28,29,30,31,32,33,34,35,36,38,39,40,41,42,43,44
N$393: Q505.D Q506.S
N$394: Q507.D Q508.S
N$395: Q509.D Q510.S
N$396: Q506.D Q508.G Q510.G R281.1
N$397: Q508.D Q512.G R282.1
N$398: D57.K(C) R285.2
N$399: Q511.S Q512.D
N$400: Q513.D Q514.S
N$401: Q515.D Q516.S
N$402: Q517.D Q518.S
N$403: Q514.D Q516.G Q518.G R286.1
N$404: Q516.D Q520.G R287.1
N$405: D58.K(C) R290.2
N$406: Q519.S Q520.D
RD_7_0: Q521.D Q743.D R471.1 ; also sheet 41
RD_7_1: Q522.D Q742.D R472.1 ; also sheet 41
WD0: Q506.G ; also sheet 3,9,13,17,21,25,29,33
WD1: Q514.G ; also sheet 3,9,13,17,21,25,29,33
WR_BYTE7: Q505.G Q507.G Q513.G Q515.G ; also sheet 8,38,39,40

### Notes on the sheet
- Q | Q
- G1 | G2 | G3 | G4 | !Q | G1 | G2 | G3 | G4 | !Q
- D | D
- E
- E
- D
- 1
- E | 3 | Q\
- 4 | !Q
- 2

## Sheet 38 of 44
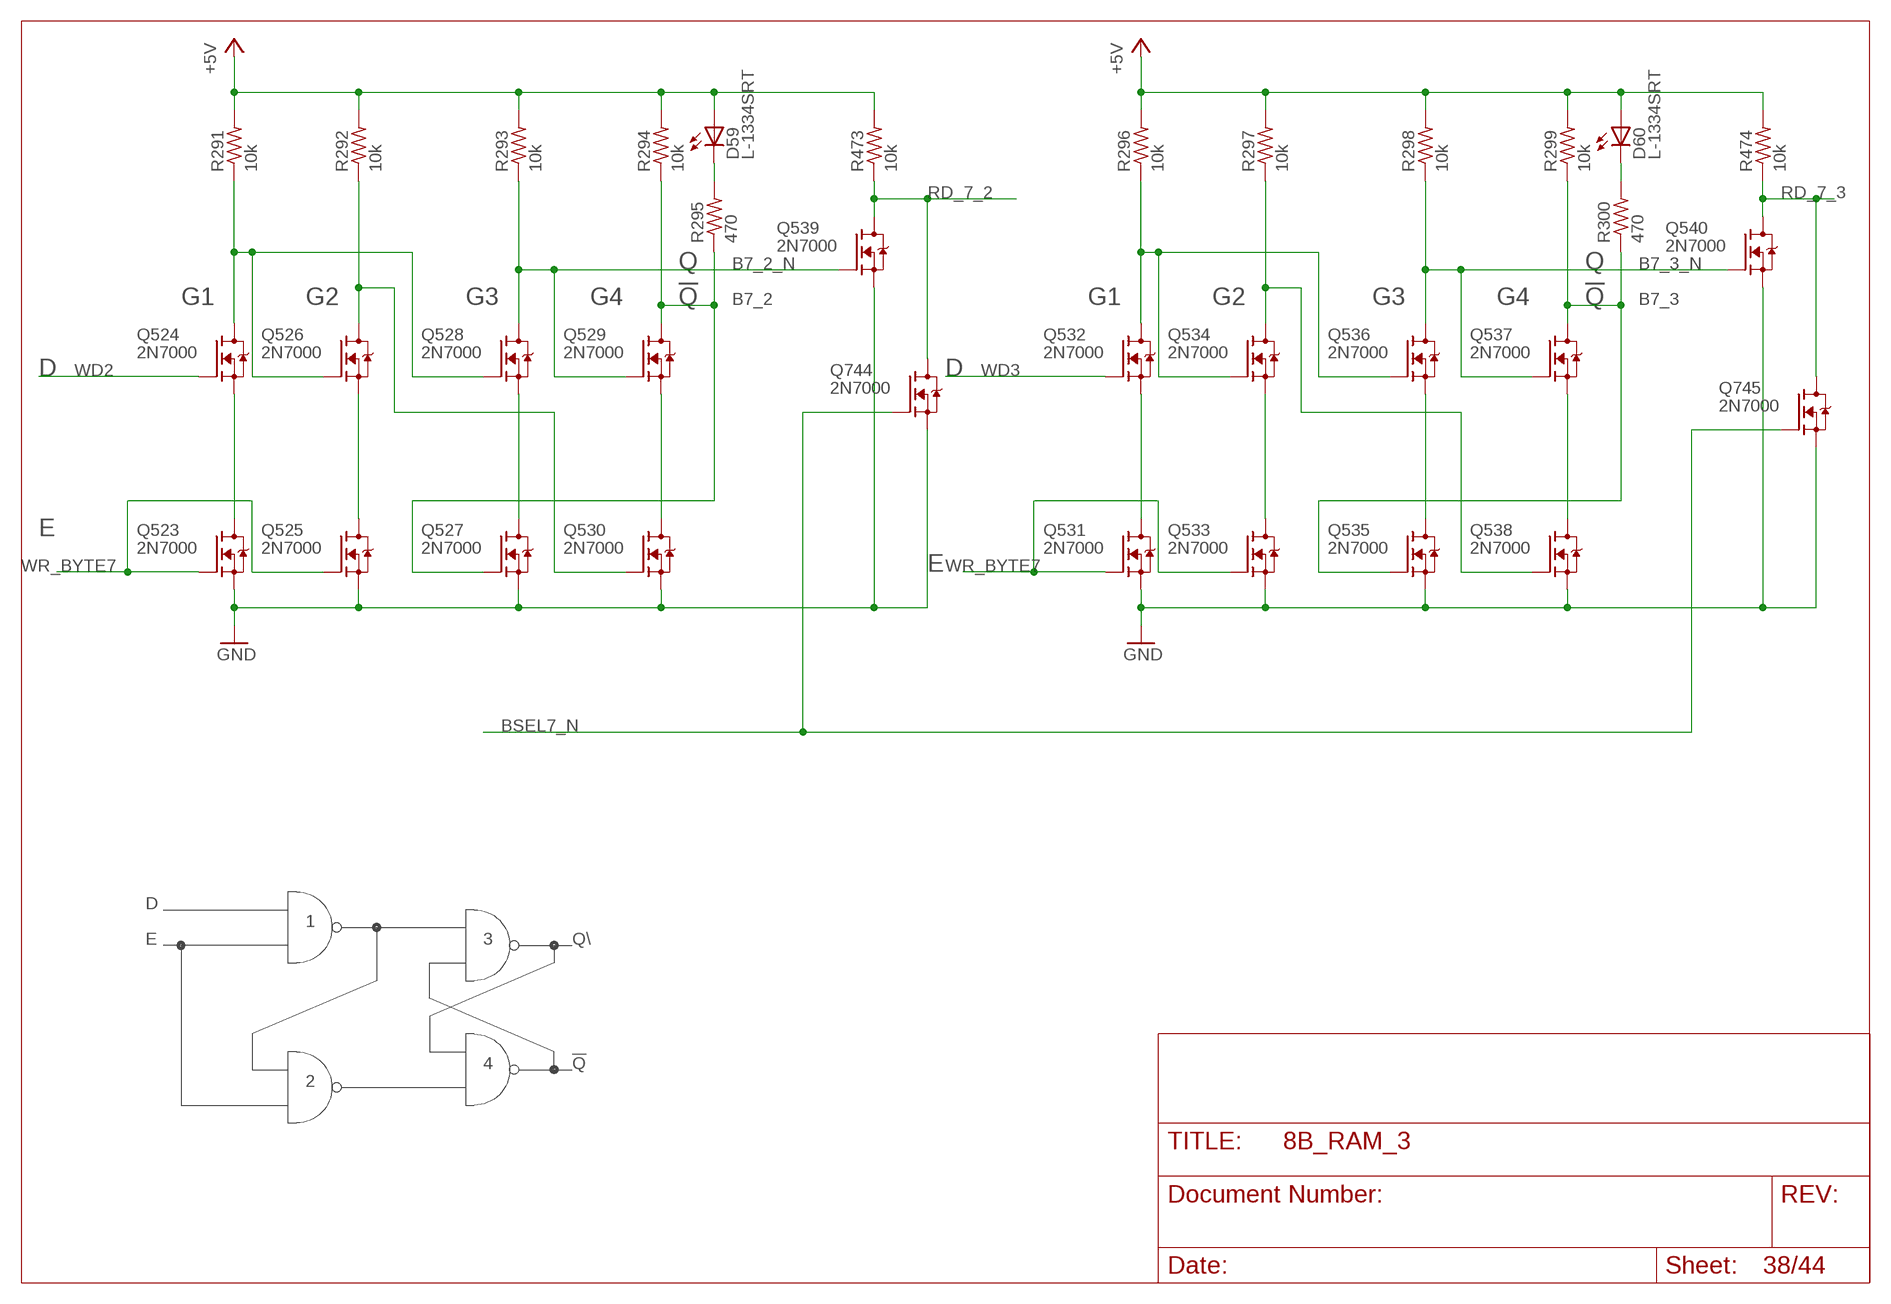
[diagram p37: schematic, sheet 38]

### Parts
D59  L-1334SRT  [LED3MM]
D60  L-1334SRT  [LED3MM]
Q523  2N7000  [TO92-DGS]
Q524  2N7000  [TO92-DGS]
Q525  2N7000  [TO92-DGS]
Q526  2N7000  [TO92-DGS]
Q527  2N7000  [TO92-DGS]
Q528  2N7000  [TO92-DGS]
Q529  2N7000  [TO92-DGS]
Q530  2N7000  [TO92-DGS]
Q531  2N7000  [TO92-DGS]
Q532  2N7000  [TO92-DGS]
Q533  2N7000  [TO92-DGS]
Q534  2N7000  [TO92-DGS]
Q535  2N7000  [TO92-DGS]
Q536  2N7000  [TO92-DGS]
Q537  2N7000  [TO92-DGS]
Q538  2N7000  [TO92-DGS]
Q539  2N7000  [TO92-DGS]
Q540  2N7000  [TO92-DGS]
Q744  2N7000  [TO92-DGS]
Q745  2N7000  [TO92-DGS]
R291  10k  R_P2INCH  [R_P2INCH]
R292  10k  R_P2INCH  [R_P2INCH]
R293  10k  R_P2INCH  [R_P2INCH]
R294  10k  R_P2INCH  [R_P2INCH]
R295  470  R_P2INCH  [R_P2INCH]
R296  10k  R_P2INCH  [R_P2INCH]
R297  10k  R_P2INCH  [R_P2INCH]
R298  10k  R_P2INCH  [R_P2INCH]
R299  10k  R_P2INCH  [R_P2INCH]
R300  470  R_P2INCH  [R_P2INCH]
R473  10k  R_P2INCH  [R_P2INCH]
R474  10k  R_P2INCH  [R_P2INCH]

### Nets
+5V: D59.A D60.A R291.2 R292.2 R293.2 R294.2 R296.2 R297.2 R298.2 R299.2 R473.2 R474.2 ; also sheet 2,4,5,6,7,8,9,10,11,12,13,14,15,16,17,18,19,20,21,22,23,24,25,26,27,28,29,30,31,32,33,34,35,36,37,39,40,41,42,43,44
B7_2: Q527.G Q529.D R294.1 R295.1
B7_2_N: Q528.D Q529.G Q539.G R293.1
B7_3: Q535.G Q537.D R299.1 R300.1
B7_3_N: Q536.D Q537.G Q540.G R298.1
BSEL7_N: Q744.G Q745.G ; also sheet 8,37,39,40
GND: Q523.S Q525.S Q527.S Q530.S Q531.S Q533.S Q535.S Q538.S Q539.S Q540.S Q744.S Q745.S ; also sheet 2,3,4,5,6,7,8,9,10,11,12,13,14,15,16,17,18,19,20,21,22,23,24,25,26,27,28,29,30,31,32,33,34,35,36,37,39,40,41,42,43,44
N$407: Q523.D Q524.S
N$408: Q525.D Q526.S
N$409: Q527.D Q528.S
N$410: Q524.D Q526.G Q528.G R291.1
N$411: Q526.D Q530.G R292.1
N$412: D59.K(C) R295.2
N$413: Q529.S Q530.D
N$414: Q531.D Q532.S
N$415: Q533.D Q534.S
N$416: Q535.D Q536.S
N$417: Q532.D Q534.G Q536.G R296.1
N$418: Q534.D Q538.G R297.1
N$419: D60.K(C) R300.2
N$420: Q537.S Q538.D
RD_7_2: Q539.D Q744.D R473.1 ; also sheet 42
RD_7_3: Q540.D Q745.D R474.1 ; also sheet 42
WD2: Q524.G ; also sheet 3,10,14,18,22,26,30,34
WD3: Q532.G ; also sheet 3,10,14,18,22,26,30,34
WR_BYTE7: Q523.G Q525.G Q531.G Q533.G ; also sheet 8,37,39,40

### Notes on the sheet
- Q | Q
- G1 | G2 | G3 | G4 | !Q | G1 | G2 | G3 | G4 | !Q
- D | D
- E
- E
- D
- 1
- E | 3 | Q\
- 4 | !Q
- 2

## Sheet 39 of 44
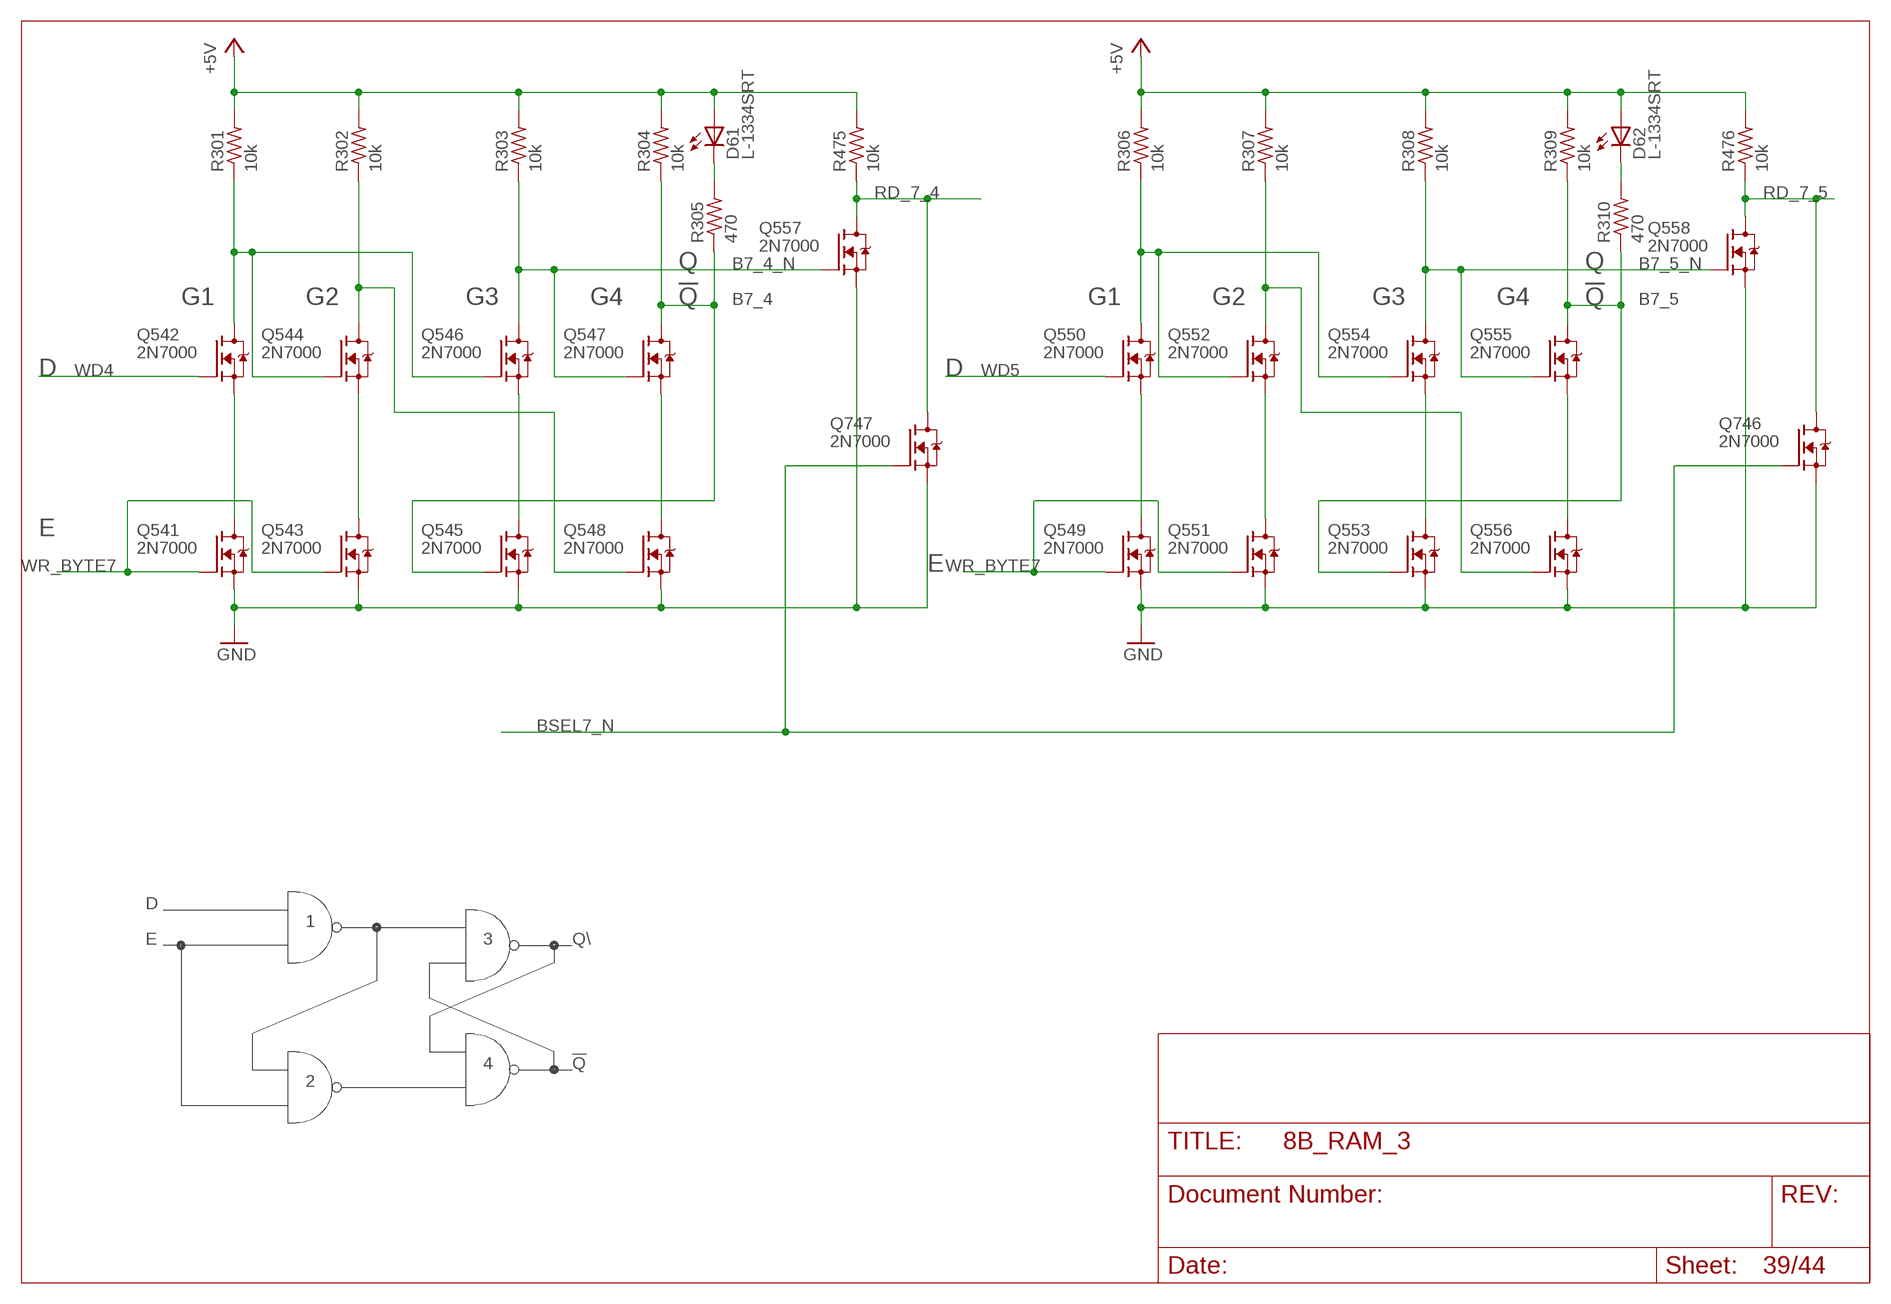
[diagram p38: schematic, sheet 39]

### Parts
D61  L-1334SRT  [LED3MM]
D62  L-1334SRT  [LED3MM]
Q541  2N7000  [TO92-DGS]
Q542  2N7000  [TO92-DGS]
Q543  2N7000  [TO92-DGS]
Q544  2N7000  [TO92-DGS]
Q545  2N7000  [TO92-DGS]
Q546  2N7000  [TO92-DGS]
Q547  2N7000  [TO92-DGS]
Q548  2N7000  [TO92-DGS]
Q549  2N7000  [TO92-DGS]
Q550  2N7000  [TO92-DGS]
Q551  2N7000  [TO92-DGS]
Q552  2N7000  [TO92-DGS]
Q553  2N7000  [TO92-DGS]
Q554  2N7000  [TO92-DGS]
Q555  2N7000  [TO92-DGS]
Q556  2N7000  [TO92-DGS]
Q557  2N7000  [TO92-DGS]
Q558  2N7000  [TO92-DGS]
Q746  2N7000  [TO92-DGS]
Q747  2N7000  [TO92-DGS]
R301  10k  R_P2INCH  [R_P2INCH]
R302  10k  R_P2INCH  [R_P2INCH]
R303  10k  R_P2INCH  [R_P2INCH]
R304  10k  R_P2INCH  [R_P2INCH]
R305  470  R_P2INCH  [R_P2INCH]
R306  10k  R_P2INCH  [R_P2INCH]
R307  10k  R_P2INCH  [R_P2INCH]
R308  10k  R_P2INCH  [R_P2INCH]
R309  10k  R_P2INCH  [R_P2INCH]
R310  470  R_P2INCH  [R_P2INCH]
R475  10k  R_P2INCH  [R_P2INCH]
R476  10k  R_P2INCH  [R_P2INCH]

### Nets
+5V: D61.A D62.A R301.2 R302.2 R303.2 R304.2 R306.2 R307.2 R308.2 R309.2 R475.2 R476.2 ; also sheet 2,4,5,6,7,8,9,10,11,12,13,14,15,16,17,18,19,20,21,22,23,24,25,26,27,28,29,30,31,32,33,34,35,36,37,38,40,41,42,43,44
B7_4: Q545.G Q547.D R304.1 R305.1
B7_4_N: Q546.D Q547.G Q557.G R303.1
B7_5: Q553.G Q555.D R309.1 R310.1
B7_5_N: Q554.D Q555.G Q558.G R308.1
BSEL7_N: Q746.G Q747.G ; also sheet 8,37,38,40
GND: Q541.S Q543.S Q545.S Q548.S Q549.S Q551.S Q553.S Q556.S Q557.S Q558.S Q746.S Q747.S ; also sheet 2,3,4,5,6,7,8,9,10,11,12,13,14,15,16,17,18,19,20,21,22,23,24,25,26,27,28,29,30,31,32,33,34,35,36,37,38,40,41,42,43,44
N$421: Q541.D Q542.S
N$422: Q543.D Q544.S
N$423: Q545.D Q546.S
N$424: Q542.D Q544.G Q546.G R301.1
N$425: Q544.D Q548.G R302.1
N$426: D61.K(C) R305.2
N$427: Q547.S Q548.D
N$428: Q549.D Q550.S
N$429: Q551.D Q552.S
N$430: Q553.D Q554.S
N$431: Q550.D Q552.G Q554.G R306.1
N$432: Q552.D Q556.G R307.1
N$433: D62.K(C) R310.2
N$434: Q555.S Q556.D
RD_7_4: Q557.D Q747.D R475.1 ; also sheet 43
RD_7_5: Q558.D Q746.D R476.1 ; also sheet 43
WD4: Q542.G ; also sheet 3,11,15,19,23,27,31,35
WD5: Q550.G ; also sheet 3,11,15,19,23,27,31,35
WR_BYTE7: Q541.G Q543.G Q549.G Q551.G ; also sheet 8,37,38,40

### Notes on the sheet
- Q | Q
- G1 | G2 | G3 | G4 | !Q | G1 | G2 | G3 | G4 | !Q
- D | D
- E
- E
- D
- 1
- E | 3 | Q\
- 4 | !Q
- 2

## Sheet 40 of 44
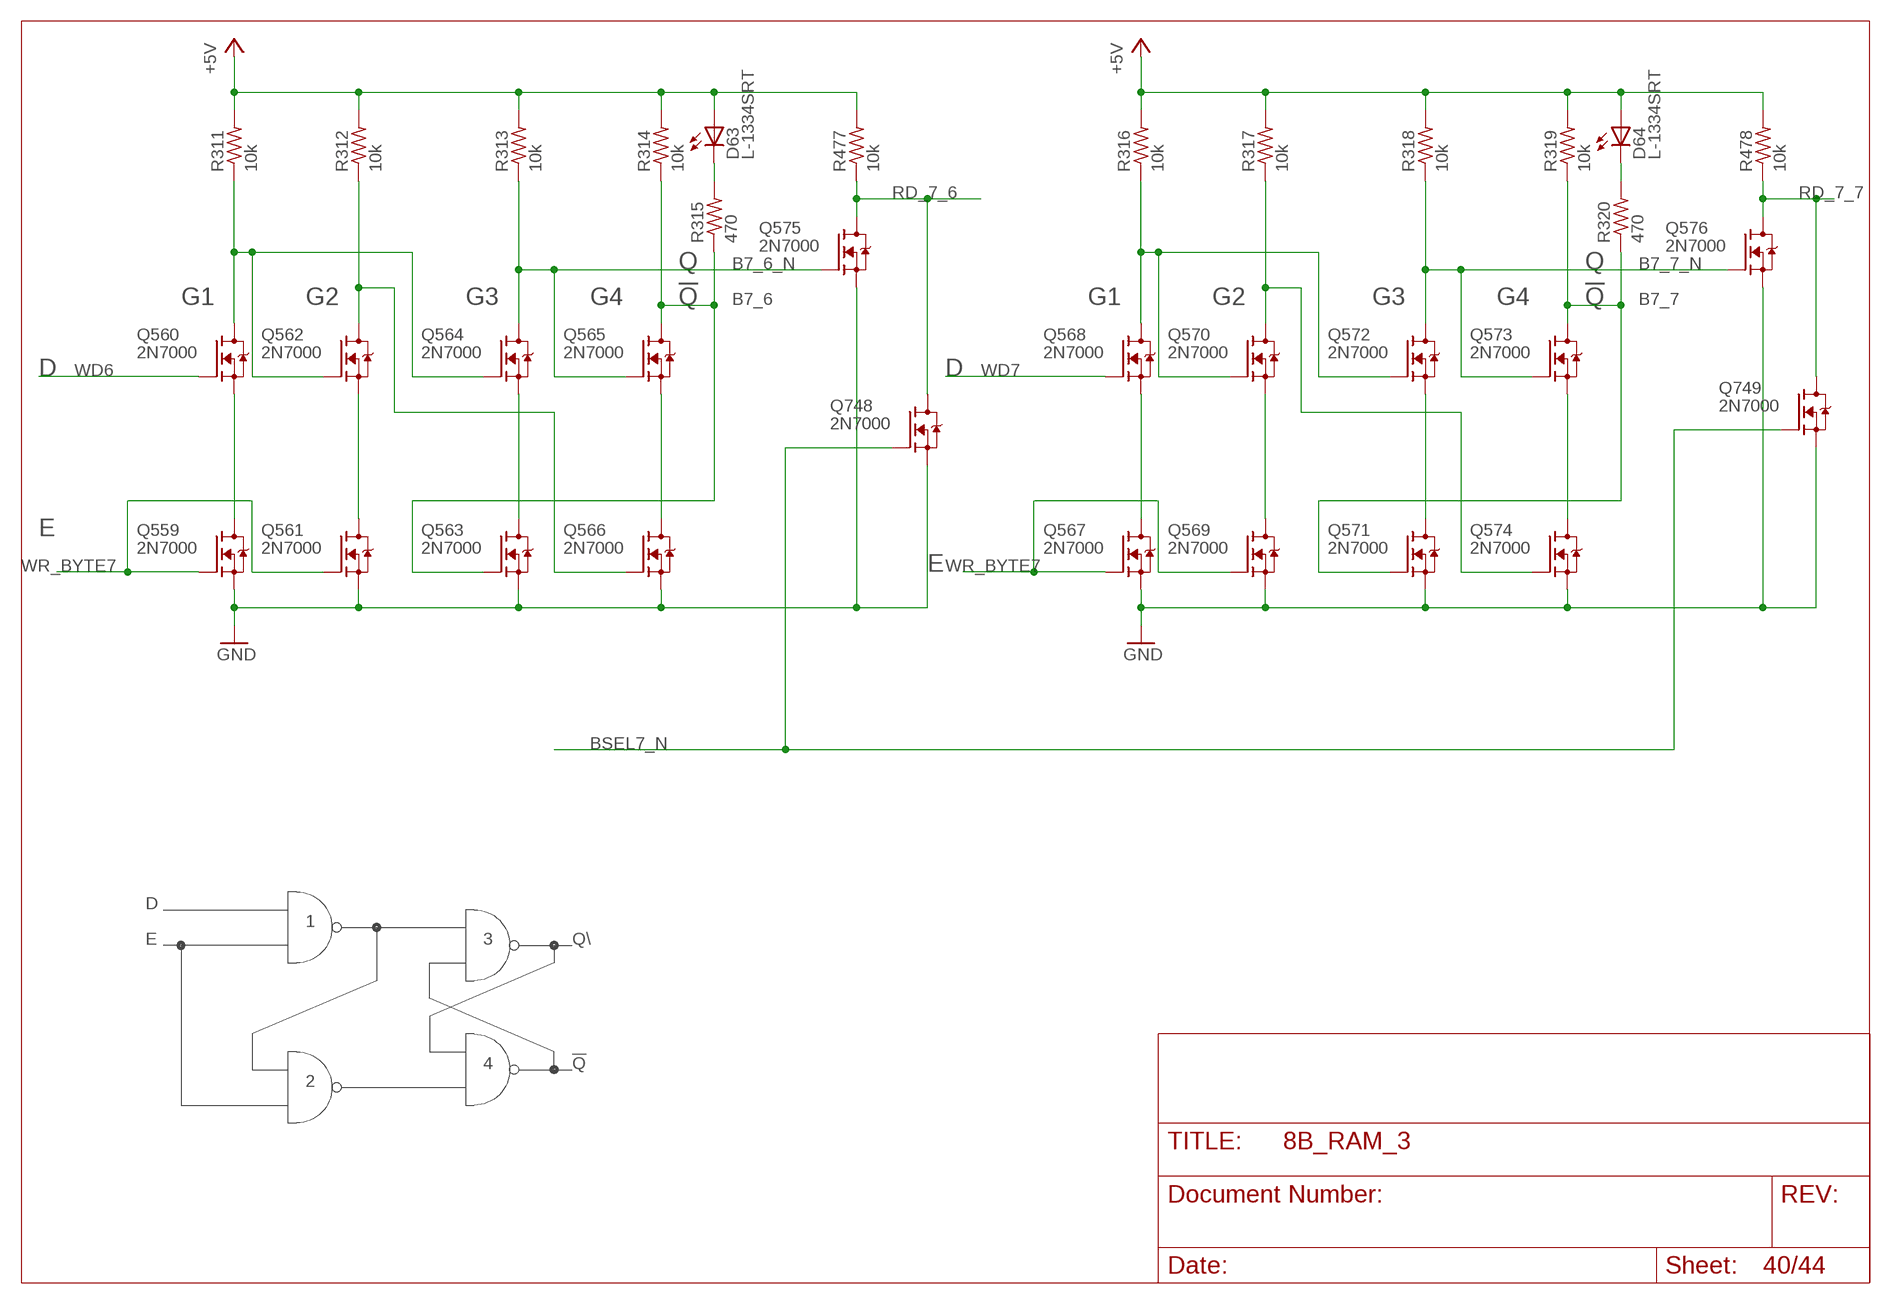
[diagram p39: schematic, sheet 40]

### Parts
D63  L-1334SRT  [LED3MM]
D64  L-1334SRT  [LED3MM]
Q559  2N7000  [TO92-DGS]
Q560  2N7000  [TO92-DGS]
Q561  2N7000  [TO92-DGS]
Q562  2N7000  [TO92-DGS]
Q563  2N7000  [TO92-DGS]
Q564  2N7000  [TO92-DGS]
Q565  2N7000  [TO92-DGS]
Q566  2N7000  [TO92-DGS]
Q567  2N7000  [TO92-DGS]
Q568  2N7000  [TO92-DGS]
Q569  2N7000  [TO92-DGS]
Q570  2N7000  [TO92-DGS]
Q571  2N7000  [TO92-DGS]
Q572  2N7000  [TO92-DGS]
Q573  2N7000  [TO92-DGS]
Q574  2N7000  [TO92-DGS]
Q575  2N7000  [TO92-DGS]
Q576  2N7000  [TO92-DGS]
Q748  2N7000  [TO92-DGS]
Q749  2N7000  [TO92-DGS]
R311  10k  R_P2INCH  [R_P2INCH]
R312  10k  R_P2INCH  [R_P2INCH]
R313  10k  R_P2INCH  [R_P2INCH]
R314  10k  R_P2INCH  [R_P2INCH]
R315  470  R_P2INCH  [R_P2INCH]
R316  10k  R_P2INCH  [R_P2INCH]
R317  10k  R_P2INCH  [R_P2INCH]
R318  10k  R_P2INCH  [R_P2INCH]
R319  10k  R_P2INCH  [R_P2INCH]
R320  470  R_P2INCH  [R_P2INCH]
R477  10k  R_P2INCH  [R_P2INCH]
R478  10k  R_P2INCH  [R_P2INCH]

### Nets
+5V: D63.A D64.A R311.2 R312.2 R313.2 R314.2 R316.2 R317.2 R318.2 R319.2 R477.2 R478.2 ; also sheet 2,4,5,6,7,8,9,10,11,12,13,14,15,16,17,18,19,20,21,22,23,24,25,26,27,28,29,30,31,32,33,34,35,36,37,38,39,41,42,43,44
B7_6: Q563.G Q565.D R314.1 R315.1
B7_6_N: Q564.D Q565.G Q575.G R313.1
B7_7: Q571.G Q573.D R319.1 R320.1
B7_7_N: Q572.D Q573.G Q576.G R318.1
BSEL7_N: Q748.G Q749.G ; also sheet 8,37,38,39
GND: Q559.S Q561.S Q563.S Q566.S Q567.S Q569.S Q571.S Q574.S Q575.S Q576.S Q748.S Q749.S ; also sheet 2,3,4,5,6,7,8,9,10,11,12,13,14,15,16,17,18,19,20,21,22,23,24,25,26,27,28,29,30,31,32,33,34,35,36,37,38,39,41,42,43,44
N$435: Q559.D Q560.S
N$436: Q561.D Q562.S
N$437: Q563.D Q564.S
N$438: Q560.D Q562.G Q564.G R311.1
N$439: Q562.D Q566.G R312.1
N$440: D63.K(C) R315.2
N$441: Q565.S Q566.D
N$442: Q567.D Q568.S
N$443: Q569.D Q570.S
N$444: Q571.D Q572.S
N$445: Q568.D Q570.G Q572.G R316.1
N$446: Q570.D Q574.G R317.1
N$447: D64.K(C) R320.2
N$448: Q573.S Q574.D
RD_7_6: Q575.D Q748.D R477.1 ; also sheet 44
RD_7_7: Q576.D Q749.D R478.1 ; also sheet 44
WD6: Q560.G ; also sheet 3,12,16,20,24,28,32,36
WD7: Q568.G ; also sheet 3,12,16,20,24,28,32,36
WR_BYTE7: Q559.G Q561.G Q567.G Q569.G ; also sheet 8,37,38,39

### Notes on the sheet
- Q | Q
- G1 | G2 | G3 | G4 | !Q | G1 | G2 | G3 | G4 | !Q
- D | D
- E
- E
- D
- 1
- E | 3 | Q\
- 4 | !Q
- 2

## Sheet 41 of 44
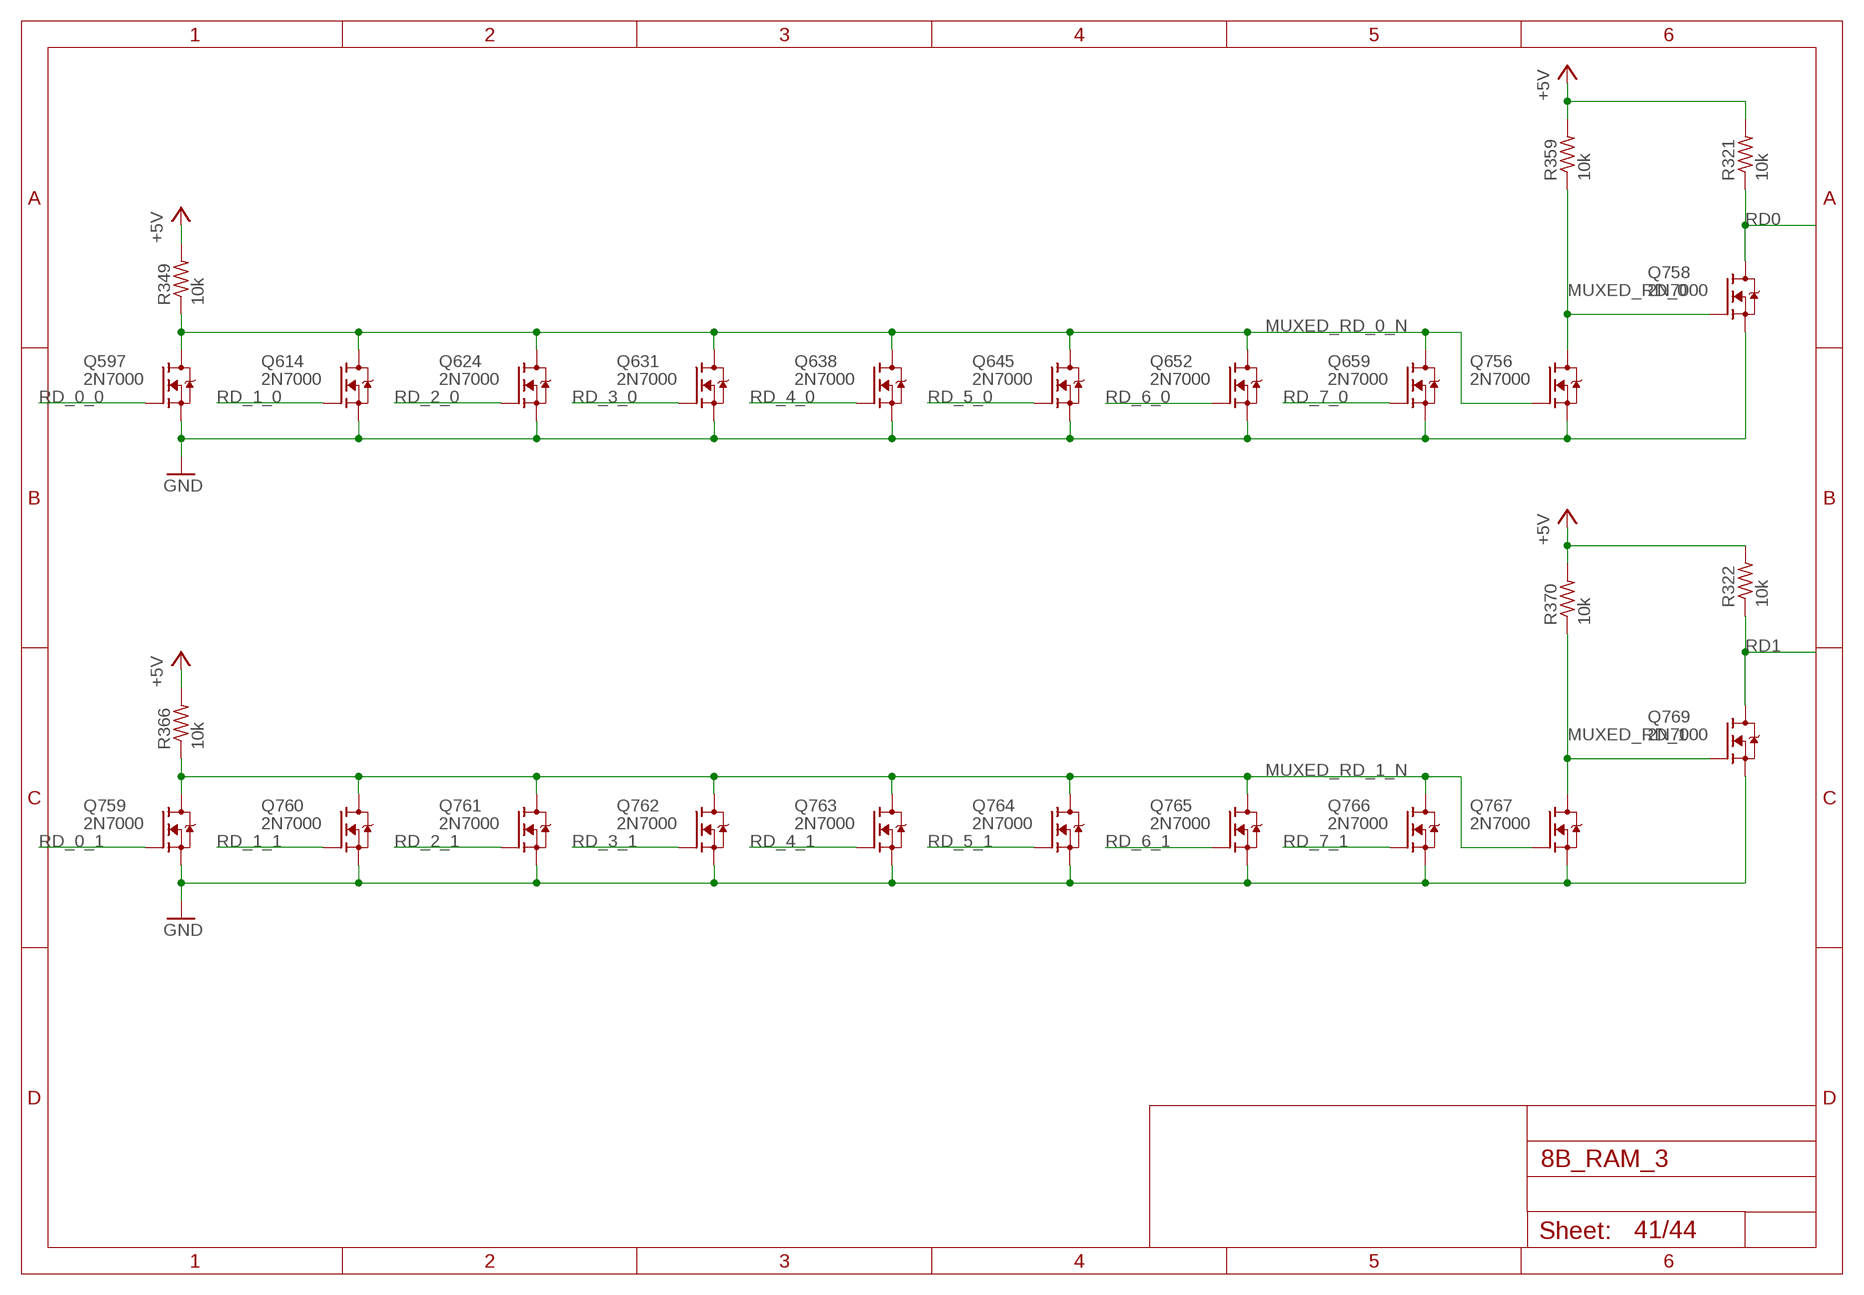
[diagram p40: schematic, sheet 41]

### Parts
Q597  2N7000  [TO92-DGS]
Q614  2N7000  [TO92-DGS]
Q624  2N7000  [TO92-DGS]
Q631  2N7000  [TO92-DGS]
Q638  2N7000  [TO92-DGS]
Q645  2N7000  [TO92-DGS]
Q652  2N7000  [TO92-DGS]
Q659  2N7000  [TO92-DGS]
Q756  2N7000  [TO92-DGS]
Q758  2N7000  [TO92-DGS]
Q759  2N7000  [TO92-DGS]
Q760  2N7000  [TO92-DGS]
Q761  2N7000  [TO92-DGS]
Q762  2N7000  [TO92-DGS]
Q763  2N7000  [TO92-DGS]
Q764  2N7000  [TO92-DGS]
Q765  2N7000  [TO92-DGS]
Q766  2N7000  [TO92-DGS]
Q767  2N7000  [TO92-DGS]
Q769  2N7000  [TO92-DGS]
R321  10k  R_P2INCH  [R_P2INCH]
R322  10k  R_P2INCH  [R_P2INCH]
R349  10k  R_P2INCH  [R_P2INCH]
R359  10k  R_P2INCH  [R_P2INCH]
R366  10k  R_P2INCH  [R_P2INCH]
R370  10k  R_P2INCH  [R_P2INCH]

### Nets
+5V: R321.2 R322.2 R349.2 R359.2 R366.2 R370.2 ; also sheet 2,4,5,6,7,8,9,10,11,12,13,14,15,16,17,18,19,20,21,22,23,24,25,26,27,28,29,30,31,32,33,34,35,36,37,38,39,40,42,43,44
GND: Q597.S Q614.S Q624.S Q631.S Q638.S Q645.S Q652.S Q659.S Q756.S Q758.S Q759.S Q760.S Q761.S Q762.S Q763.S Q764.S Q765.S Q766.S Q767.S Q769.S ; also sheet 2,3,4,5,6,7,8,9,10,11,12,13,14,15,16,17,18,19,20,21,22,23,24,25,26,27,28,29,30,31,32,33,34,35,36,37,38,39,40,42,43,44
MUXED_RD_0: Q756.D Q758.G R359.1
MUXED_RD_0_N: Q597.D Q614.D Q624.D Q631.D Q638.D Q645.D Q652.D Q659.D Q756.G R349.1
MUXED_RD_1: Q767.D Q769.G R370.1
MUXED_RD_1_N: Q759.D Q760.D Q761.D Q762.D Q763.D Q764.D Q765.D Q766.D Q767.G R366.1
RD0: Q758.D R321.1 ; also sheet 3
RD1: Q769.D R322.1 ; also sheet 3
RD_0_0: Q597.G ; also sheet 9
RD_0_1: Q759.G ; also sheet 9
RD_1_0: Q614.G ; also sheet 13
RD_1_1: Q760.G ; also sheet 13
RD_2_0: Q624.G ; also sheet 17
RD_2_1: Q761.G ; also sheet 17
RD_3_0: Q631.G ; also sheet 21
RD_3_1: Q762.G ; also sheet 21
RD_4_0: Q638.G ; also sheet 25
RD_4_1: Q763.G ; also sheet 25
RD_5_0: Q645.G ; also sheet 29
RD_5_1: Q764.G ; also sheet 29
RD_6_0: Q652.G ; also sheet 33
RD_6_1: Q765.G ; also sheet 33
RD_7_0: Q659.G ; also sheet 37
RD_7_1: Q766.G ; also sheet 37

## Sheet 42 of 44
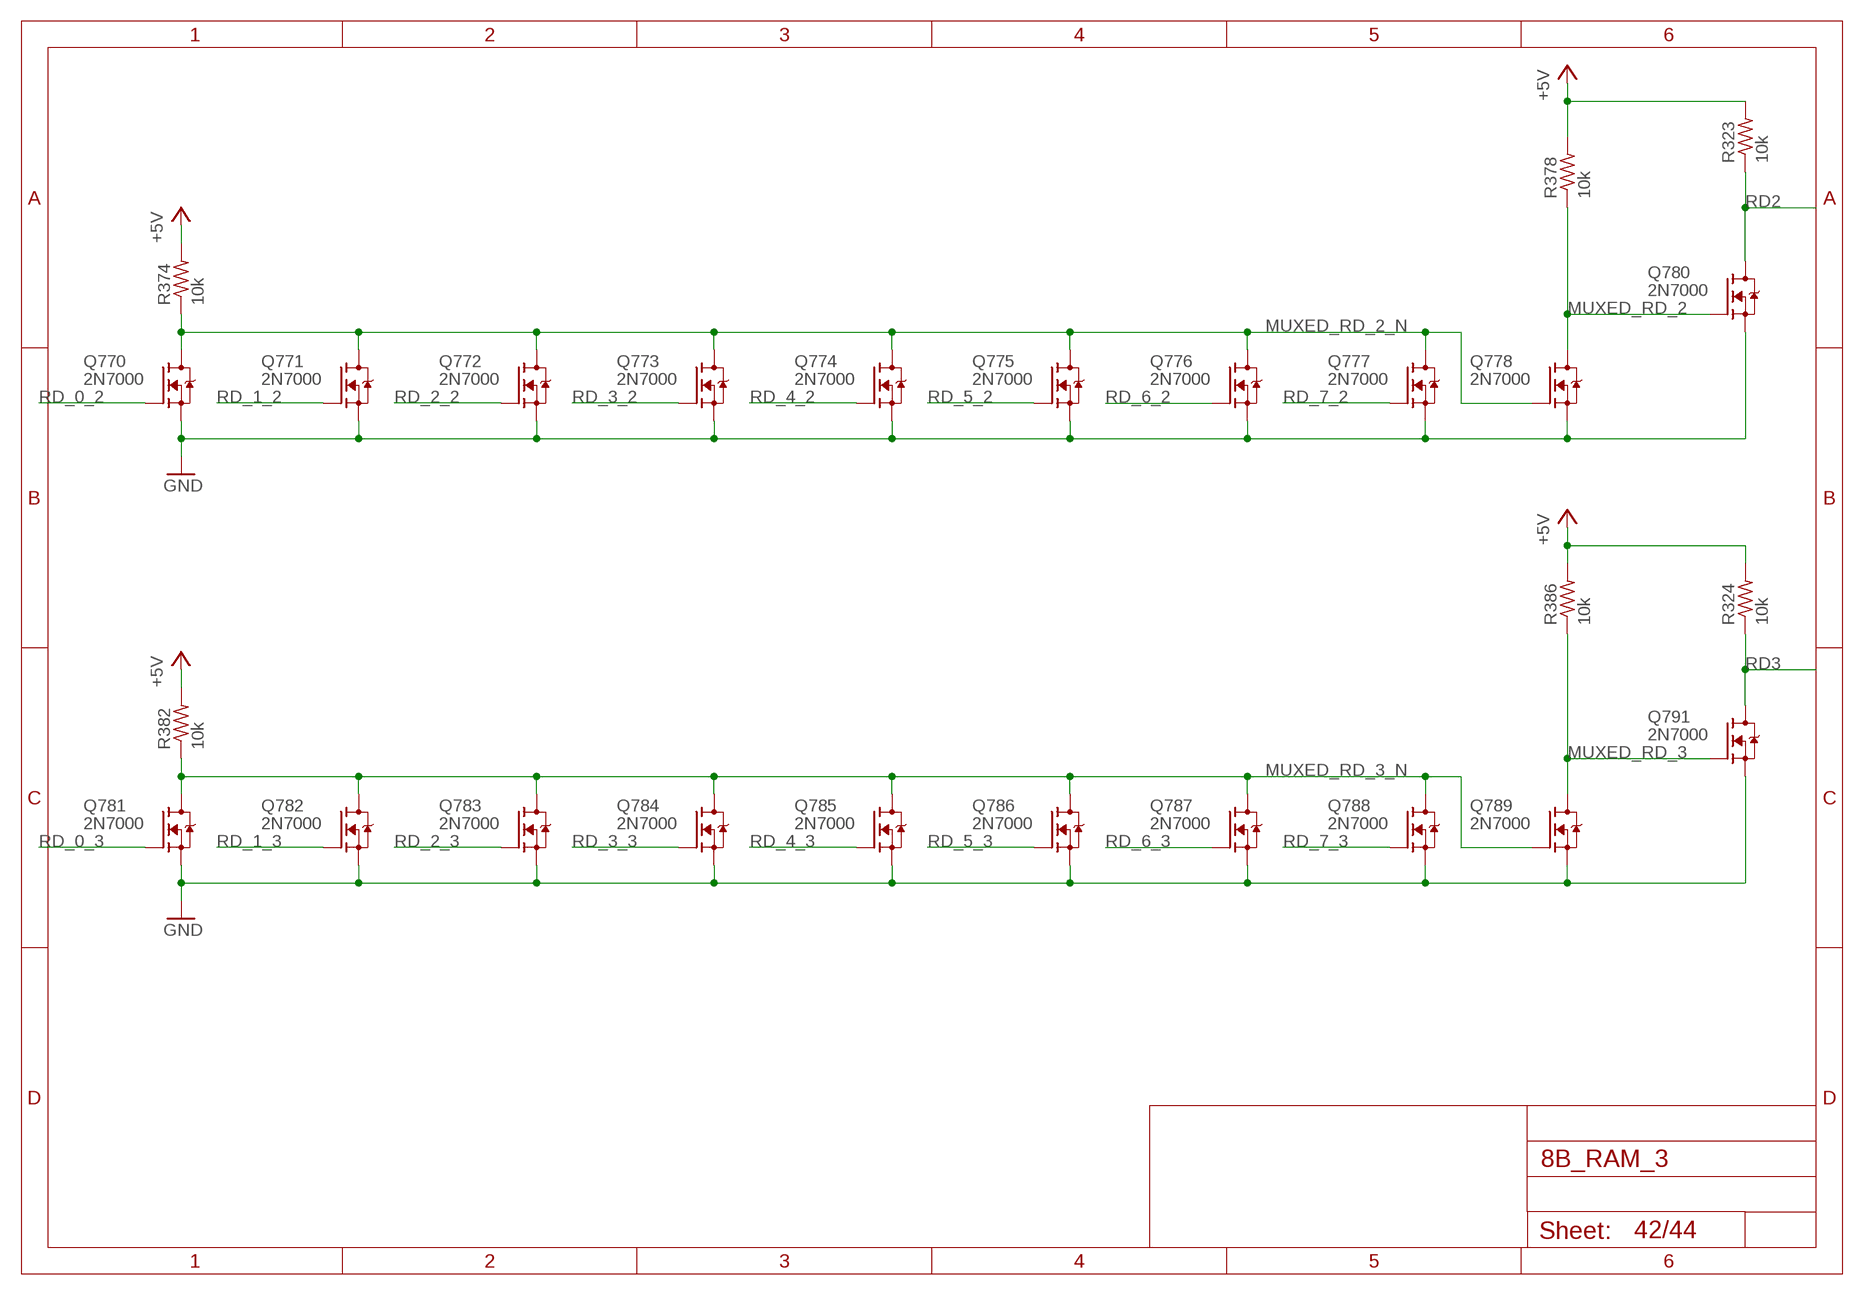
[diagram p41: schematic, sheet 42]

### Parts
Q770  2N7000  [TO92-DGS]
Q771  2N7000  [TO92-DGS]
Q772  2N7000  [TO92-DGS]
Q773  2N7000  [TO92-DGS]
Q774  2N7000  [TO92-DGS]
Q775  2N7000  [TO92-DGS]
Q776  2N7000  [TO92-DGS]
Q777  2N7000  [TO92-DGS]
Q778  2N7000  [TO92-DGS]
Q780  2N7000  [TO92-DGS]
Q781  2N7000  [TO92-DGS]
Q782  2N7000  [TO92-DGS]
Q783  2N7000  [TO92-DGS]
Q784  2N7000  [TO92-DGS]
Q785  2N7000  [TO92-DGS]
Q786  2N7000  [TO92-DGS]
Q787  2N7000  [TO92-DGS]
Q788  2N7000  [TO92-DGS]
Q789  2N7000  [TO92-DGS]
Q791  2N7000  [TO92-DGS]
R323  10k  R_P2INCH  [R_P2INCH]
R324  10k  R_P2INCH  [R_P2INCH]
R374  10k  R_P2INCH  [R_P2INCH]
R378  10k  R_P2INCH  [R_P2INCH]
R382  10k  R_P2INCH  [R_P2INCH]
R386  10k  R_P2INCH  [R_P2INCH]

### Nets
+5V: R323.2 R324.2 R374.2 R378.2 R382.2 R386.2 ; also sheet 2,4,5,6,7,8,9,10,11,12,13,14,15,16,17,18,19,20,21,22,23,24,25,26,27,28,29,30,31,32,33,34,35,36,37,38,39,40,41,43,44
GND: Q770.S Q771.S Q772.S Q773.S Q774.S Q775.S Q776.S Q777.S Q778.S Q780.S Q781.S Q782.S Q783.S Q784.S Q785.S Q786.S Q787.S Q788.S Q789.S Q791.S ; also sheet 2,3,4,5,6,7,8,9,10,11,12,13,14,15,16,17,18,19,20,21,22,23,24,25,26,27,28,29,30,31,32,33,34,35,36,37,38,39,40,41,43,44
MUXED_RD_2: Q778.D Q780.G R378.1
MUXED_RD_2_N: Q770.D Q771.D Q772.D Q773.D Q774.D Q775.D Q776.D Q777.D Q778.G R374.1
MUXED_RD_3: Q789.D Q791.G R386.1
MUXED_RD_3_N: Q781.D Q782.D Q783.D Q784.D Q785.D Q786.D Q787.D Q788.D Q789.G R382.1
RD2: Q780.D R323.1 ; also sheet 3
RD3: Q791.D R324.1 ; also sheet 3
RD_0_2: Q770.G ; also sheet 10
RD_0_3: Q781.G ; also sheet 10
RD_1_2: Q771.G ; also sheet 14
RD_1_3: Q782.G ; also sheet 14
RD_2_2: Q772.G ; also sheet 18
RD_2_3: Q783.G ; also sheet 18
RD_3_2: Q773.G ; also sheet 22
RD_3_3: Q784.G ; also sheet 22
RD_4_2: Q774.G ; also sheet 26
RD_4_3: Q785.G ; also sheet 26
RD_5_2: Q775.G ; also sheet 30
RD_5_3: Q786.G ; also sheet 30
RD_6_2: Q776.G ; also sheet 34
RD_6_3: Q787.G ; also sheet 34
RD_7_2: Q777.G ; also sheet 38
RD_7_3: Q788.G ; also sheet 38

## Sheet 43 of 44
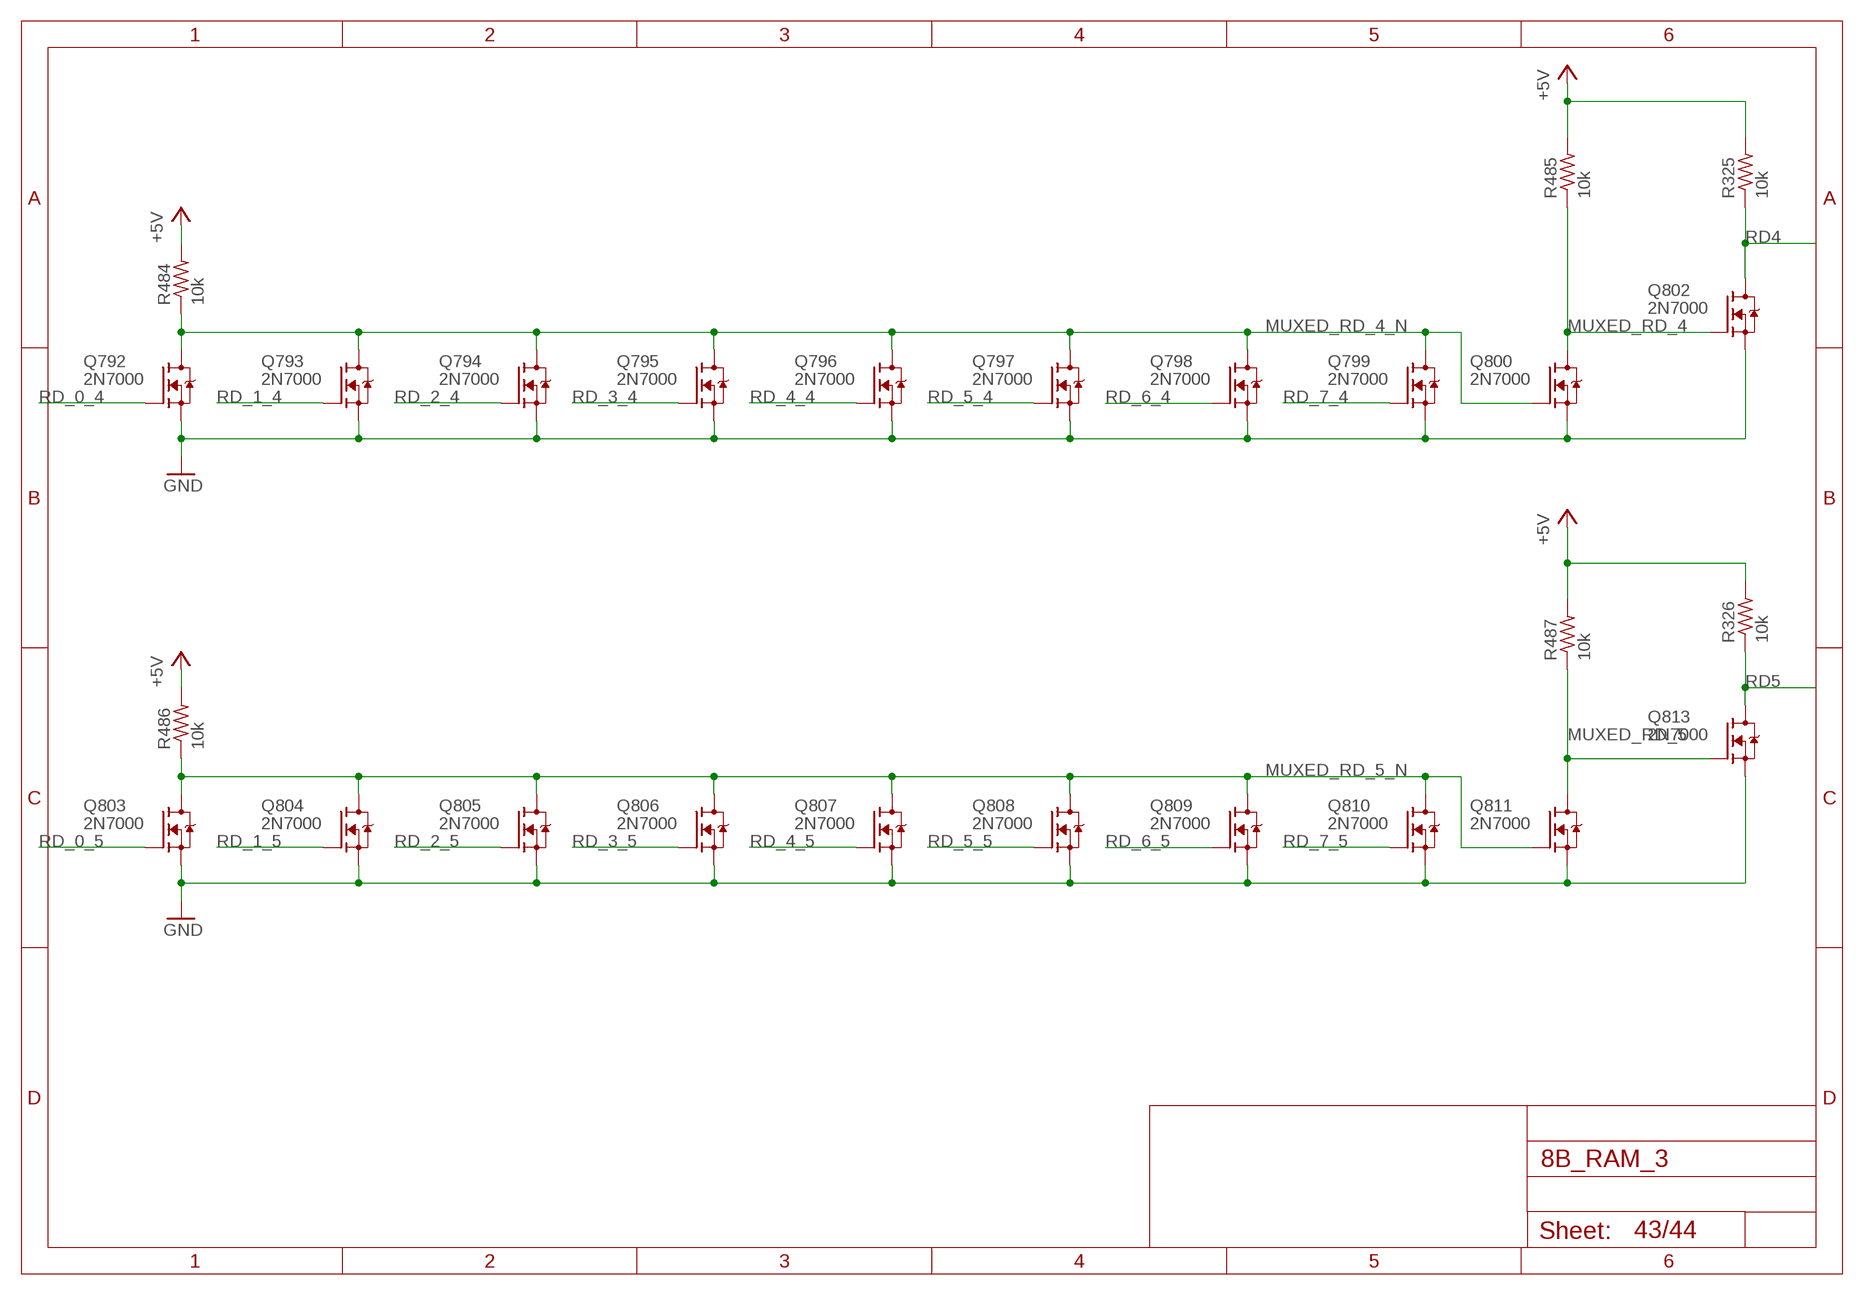
[diagram p42: schematic, sheet 43]

### Parts
Q792  2N7000  [TO92-DGS]
Q793  2N7000  [TO92-DGS]
Q794  2N7000  [TO92-DGS]
Q795  2N7000  [TO92-DGS]
Q796  2N7000  [TO92-DGS]
Q797  2N7000  [TO92-DGS]
Q798  2N7000  [TO92-DGS]
Q799  2N7000  [TO92-DGS]
Q800  2N7000  [TO92-DGS]
Q802  2N7000  [TO92-DGS]
Q803  2N7000  [TO92-DGS]
Q804  2N7000  [TO92-DGS]
Q805  2N7000  [TO92-DGS]
Q806  2N7000  [TO92-DGS]
Q807  2N7000  [TO92-DGS]
Q808  2N7000  [TO92-DGS]
Q809  2N7000  [TO92-DGS]
Q810  2N7000  [TO92-DGS]
Q811  2N7000  [TO92-DGS]
Q813  2N7000  [TO92-DGS]
R325  10k  R_P2INCH  [R_P2INCH]
R326  10k  R_P2INCH  [R_P2INCH]
R484  10k  R_P2INCH  [R_P2INCH]
R485  10k  R_P2INCH  [R_P2INCH]
R486  10k  R_P2INCH  [R_P2INCH]
R487  10k  R_P2INCH  [R_P2INCH]

### Nets
+5V: R325.2 R326.2 R484.2 R485.2 R486.2 R487.2 ; also sheet 2,4,5,6,7,8,9,10,11,12,13,14,15,16,17,18,19,20,21,22,23,24,25,26,27,28,29,30,31,32,33,34,35,36,37,38,39,40,41,42,44
GND: Q792.S Q793.S Q794.S Q795.S Q796.S Q797.S Q798.S Q799.S Q800.S Q802.S Q803.S Q804.S Q805.S Q806.S Q807.S Q808.S Q809.S Q810.S Q811.S Q813.S ; also sheet 2,3,4,5,6,7,8,9,10,11,12,13,14,15,16,17,18,19,20,21,22,23,24,25,26,27,28,29,30,31,32,33,34,35,36,37,38,39,40,41,42,44
MUXED_RD_4: Q800.D Q802.G R485.1
MUXED_RD_4_N: Q792.D Q793.D Q794.D Q795.D Q796.D Q797.D Q798.D Q799.D Q800.G R484.1
MUXED_RD_5: Q811.D Q813.G R487.1
MUXED_RD_5_N: Q803.D Q804.D Q805.D Q806.D Q807.D Q808.D Q809.D Q810.D Q811.G R486.1
RD4: Q802.D R325.1 ; also sheet 3
RD5: Q813.D R326.1 ; also sheet 3
RD_0_4: Q792.G ; also sheet 11
RD_0_5: Q803.G ; also sheet 11
RD_1_4: Q793.G ; also sheet 15
RD_1_5: Q804.G ; also sheet 15
RD_2_4: Q794.G ; also sheet 19
RD_2_5: Q805.G ; also sheet 19
RD_3_4: Q795.G ; also sheet 23
RD_3_5: Q806.G ; also sheet 23
RD_4_4: Q796.G ; also sheet 27
RD_4_5: Q807.G ; also sheet 27
RD_5_4: Q797.G ; also sheet 31
RD_5_5: Q808.G ; also sheet 31
RD_6_4: Q798.G ; also sheet 35
RD_6_5: Q809.G ; also sheet 35
RD_7_4: Q799.G ; also sheet 39
RD_7_5: Q810.G ; also sheet 39

## Sheet 44 of 44
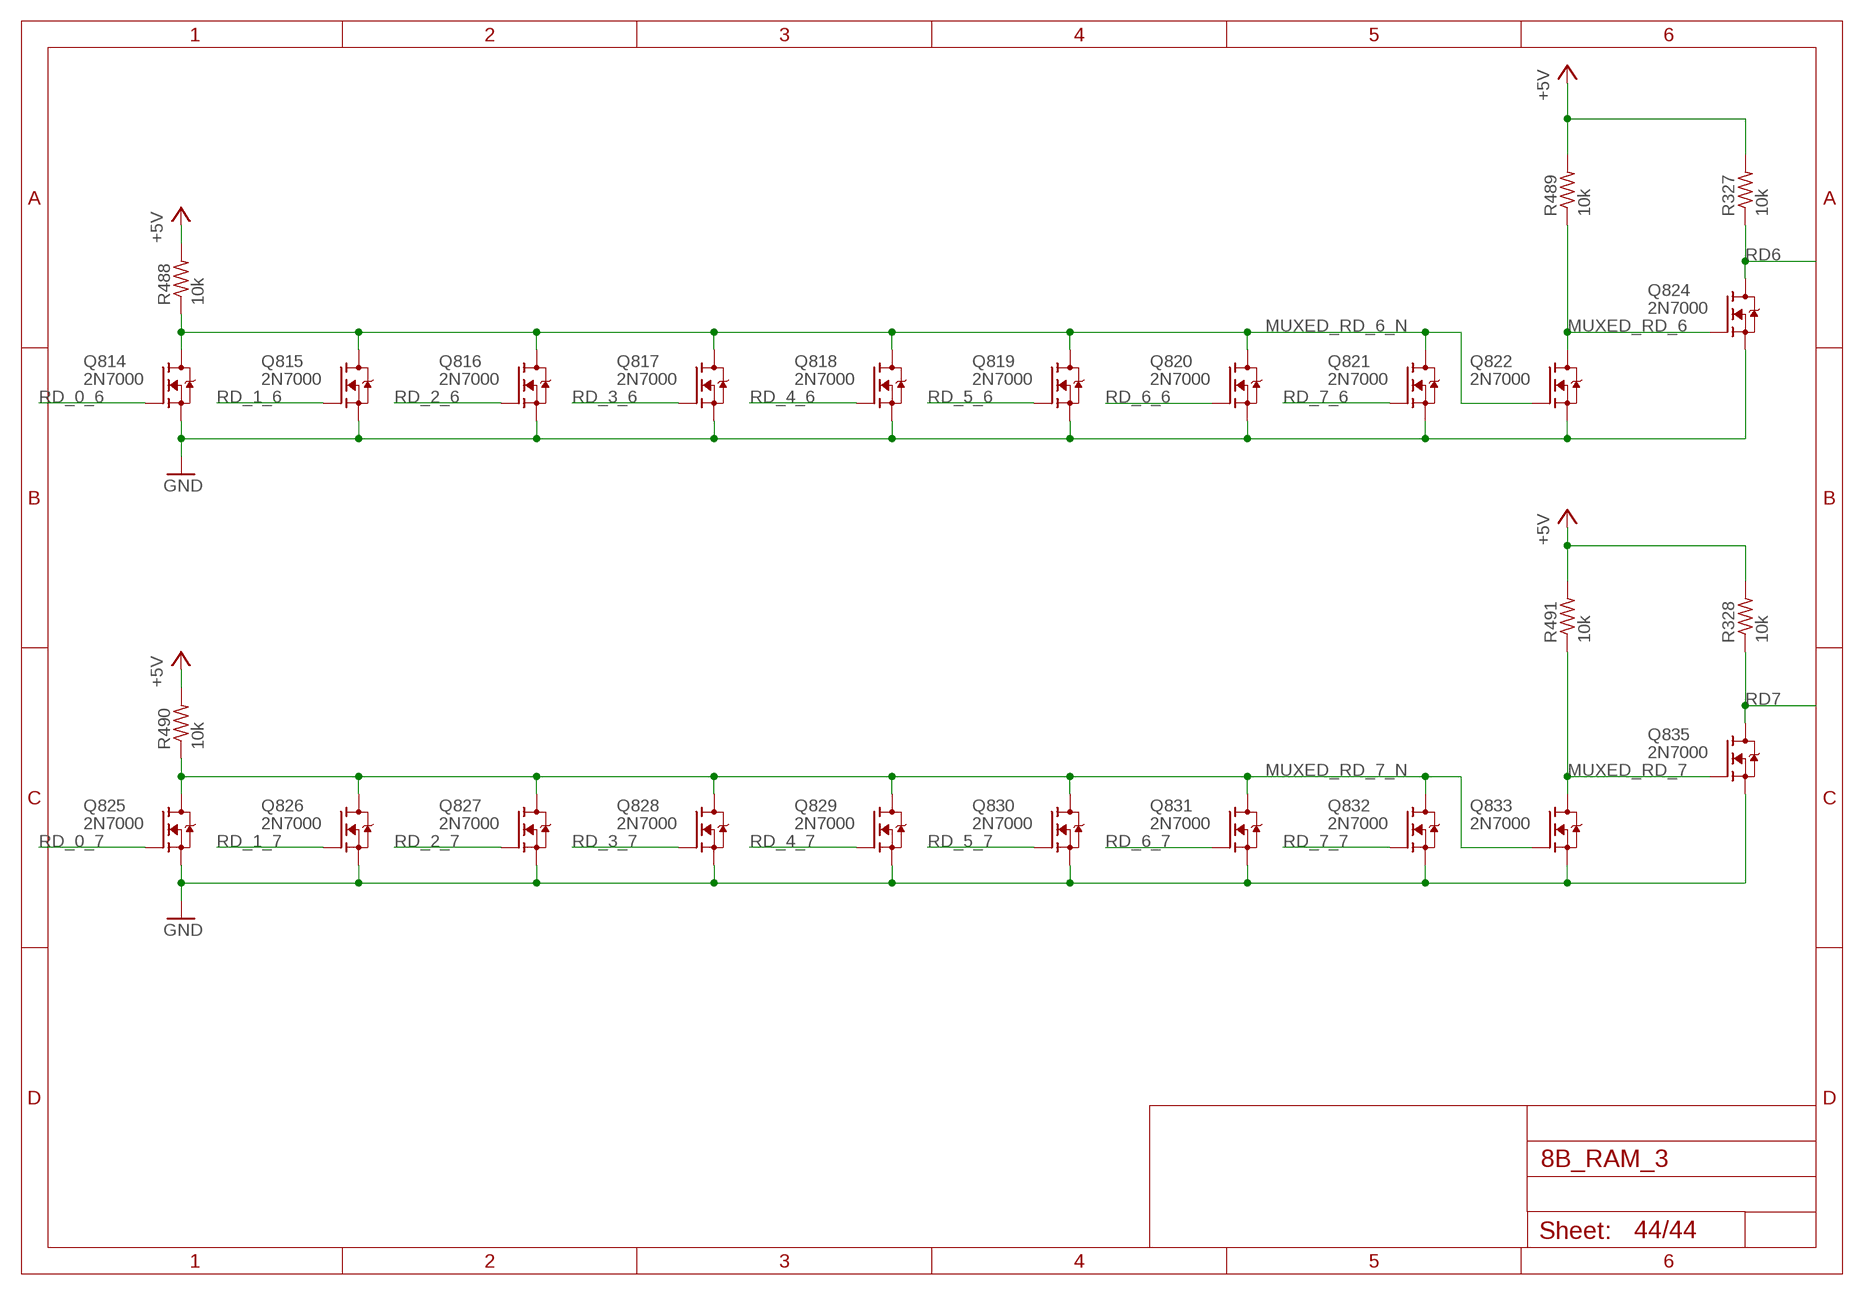
[diagram p43: schematic, sheet 44]

### Parts
Q814  2N7000  [TO92-DGS]
Q815  2N7000  [TO92-DGS]
Q816  2N7000  [TO92-DGS]
Q817  2N7000  [TO92-DGS]
Q818  2N7000  [TO92-DGS]
Q819  2N7000  [TO92-DGS]
Q820  2N7000  [TO92-DGS]
Q821  2N7000  [TO92-DGS]
Q822  2N7000  [TO92-DGS]
Q824  2N7000  [TO92-DGS]
Q825  2N7000  [TO92-DGS]
Q826  2N7000  [TO92-DGS]
Q827  2N7000  [TO92-DGS]
Q828  2N7000  [TO92-DGS]
Q829  2N7000  [TO92-DGS]
Q830  2N7000  [TO92-DGS]
Q831  2N7000  [TO92-DGS]
Q832  2N7000  [TO92-DGS]
Q833  2N7000  [TO92-DGS]
Q835  2N7000  [TO92-DGS]
R327  10k  R_P2INCH  [R_P2INCH]
R328  10k  R_P2INCH  [R_P2INCH]
R488  10k  R_P2INCH  [R_P2INCH]
R489  10k  R_P2INCH  [R_P2INCH]
R490  10k  R_P2INCH  [R_P2INCH]
R491  10k  R_P2INCH  [R_P2INCH]

### Nets
+5V: R327.2 R328.2 R488.2 R489.2 R490.2 R491.2 ; also sheet 2,4,5,6,7,8,9,10,11,12,13,14,15,16,17,18,19,20,21,22,23,24,25,26,27,28,29,30,31,32,33,34,35,36,37,38,39,40,41,42,43
GND: Q814.S Q815.S Q816.S Q817.S Q818.S Q819.S Q820.S Q821.S Q822.S Q824.S Q825.S Q826.S Q827.S Q828.S Q829.S Q830.S Q831.S Q832.S Q833.S Q835.S ; also sheet 2,3,4,5,6,7,8,9,10,11,12,13,14,15,16,17,18,19,20,21,22,23,24,25,26,27,28,29,30,31,32,33,34,35,36,37,38,39,40,41,42,43
MUXED_RD_6: Q822.D Q824.G R489.1
MUXED_RD_6_N: Q814.D Q815.D Q816.D Q817.D Q818.D Q819.D Q820.D Q821.D Q822.G R488.1
MUXED_RD_7: Q833.D Q835.G R491.1
MUXED_RD_7_N: Q825.D Q826.D Q827.D Q828.D Q829.D Q830.D Q831.D Q832.D Q833.G R490.1
RD6: Q824.D R327.1 ; also sheet 3
RD7: Q835.D R328.1 ; also sheet 3
RD_0_6: Q814.G ; also sheet 12
RD_0_7: Q825.G ; also sheet 12
RD_1_6: Q815.G ; also sheet 16
RD_1_7: Q826.G ; also sheet 16
RD_2_6: Q816.G ; also sheet 20
RD_2_7: Q827.G ; also sheet 20
RD_3_6: Q817.G ; also sheet 24
RD_3_7: Q828.G ; also sheet 24
RD_4_6: Q818.G ; also sheet 28
RD_4_7: Q829.G ; also sheet 28
RD_5_6: Q819.G ; also sheet 32
RD_5_7: Q830.G ; also sheet 32
RD_6_6: Q820.G ; also sheet 36
RD_6_7: Q831.G ; also sheet 36
RD_7_6: Q821.G ; also sheet 40
RD_7_7: Q832.G ; also sheet 40

## Library data of the parts
C1-C8 C10 C11 = MyLib:C_P2INCH
C9 = MyLib:POLARISED_CAP_2P5_6P3MM
D1-D64 = MyLib:L-1334SRT
H1-H4 = MyLib:4M_MOUNT_HOLE
J1 J2 = MyLib:20_HDR_LOCKING
PP1 PP2 = MyLib:POWER_PAD
Q1-Q576 Q594-Q597 Q599-Q601 Q603 Q604 Q608-Q610 Q612-Q614 Q618-Q620 Q622-Q627 Q629-Q634 Q636-Q641 Q643-Q648 Q650-Q655 Q657-Q659 Q686-Q750 Q753-Q756 Q758-Q767 Q769-Q778 Q780-Q789 Q791-Q800 Q802-Q811 Q813-Q822 Q824-Q833 Q835 = MyLib:2N7000
R1-R328 R346-R349 R351 R353 R356 R358 R359 R363 R365-R367 R369-R371 R373-R375 R377-R379 R381-R383 R385 R386 R415-R479 R482-R491 = MyLib:R_P2INCH